# Altium project e.PrjPcb (part 1 of 2)
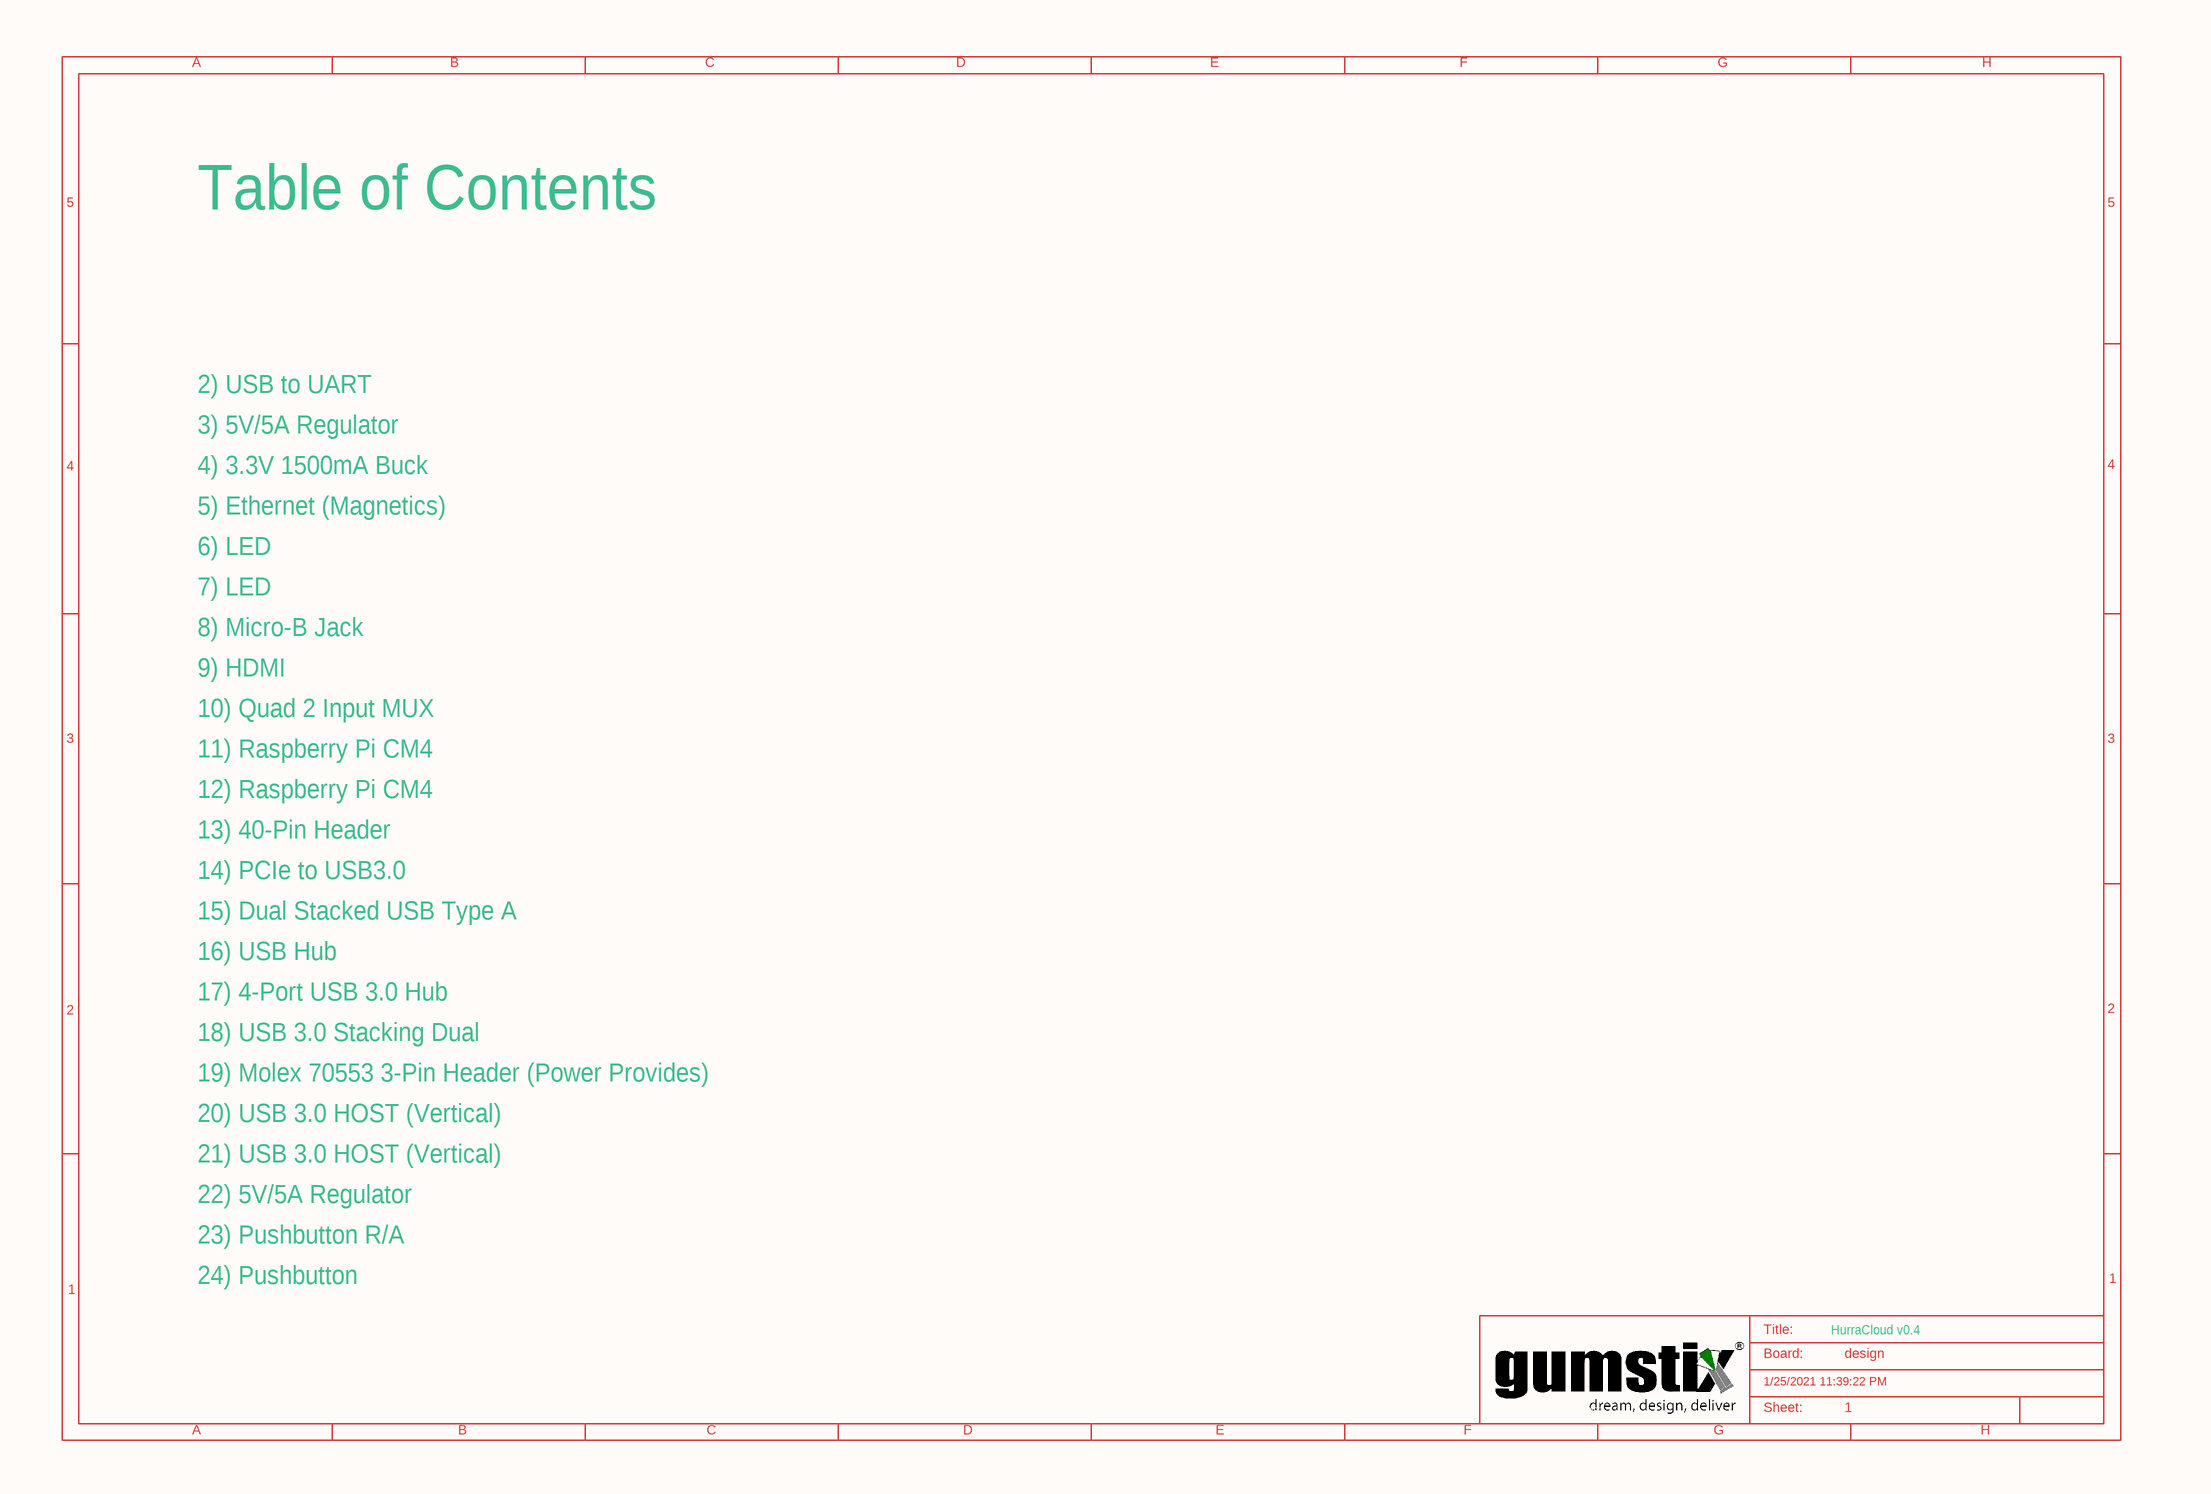
[diagram p0: design_0.SchDoc]
14 sheets, 249 parts. Net scope: global (net labels, ports and power ports of the same name join across sheets).
Board file: design.PcbDoc
Sheets:
  design_0.SchDoc
  design_1.SchDoc
  design_10.SchDoc
  design_12.SchDoc
  design_13.SchDoc
  design_16.SchDoc
  design_17.SchDoc
  design_18.SchDoc
  design_22.SchDoc
  design_3.SchDoc
  design_4.SchDoc
  design_6.SchDoc
  design_7.SchDoc
  design_9.SchDoc

## Sheet design_0.SchDoc
size 414 x 279 mm; Origin: Eagle

### Parts
TOC  DRAWING_NAME: design  LAST_DATE_TIME: 1/25/2021 11:39:22 PM  SHEET: 1  Sheet: Sheet:  Title: Title:  Board: Board:  (hidden comment: A3-L-GUMSTIX)

### Notes on the sheet
- Table of Contents
- 2) USB to UART
- 3) 5V/5A Regulator
- 4) 3.3V 1500mA Buck
- 5) Ethernet (Magnetics)
- 6) LED
- 7) LED
- 8) Micro-B Jack
- 9) HDMI
- 10) Quad 2 Input MUX
- 11) Raspberry Pi CM4
- 12) Raspberry Pi CM4
- 13) 40-Pin Header
- 14) PCIe to USB3.0
- 15) Dual Stacked USB Type A
- 16) USB Hub
- 17) 4-Port USB 3.0 Hub
- 18) USB 3.0 Stacking Dual
- 19) Molex 70553 3-Pin Header (Power Provides)
- 20) USB 3.0 HOST (Vertical)
- 21) USB 3.0 HOST (Vertical)
- 22) 5V/5A Regulator
- 23) Pushbutton R/A
- 24) Pushbutton
- HurraCloud v0.4

### Library data of the parts
TOC = A3-L-GUMSTIX: GateName_1: G$1; SymbolName_1: A3-L-GUMSTIX; LibraryName: qualified_1; DeviceSetName: A3-L-GUMSTIX; A: A; B: B; C: C; D: D; E: E; F: F; G: G; H: H; 1: 1; 2: 2; 3: 3; 4: 4; 5: 5; C:/Gumstix/gumstix-logo-16.bmp: C:/Gumstix/gumstix-logo-16.bmp

## Sheet design_1.SchDoc: design
size 414 x 279 mm; Date: 1/25/2021 11:39:22 PM; SheetNumber: 2; Origin: Eagle; GateName_1: G$1; SymbolName_1: A3-L-GUMSTIX; LibraryName: qualified_1; DeviceSetName: A3-L-GUMSTIX; A: A; B: B; C: C; D: D; E: E; F: F; G: G; H: H; 1: 1; 2: 2; 3: 3; 4: 4; 5: 5; Sheet: Sheet:; C:/Gumstix/gumstix-logo-16.bmp: C:/Gumstix/gumstix-logo-16.bmp; Board: Board:
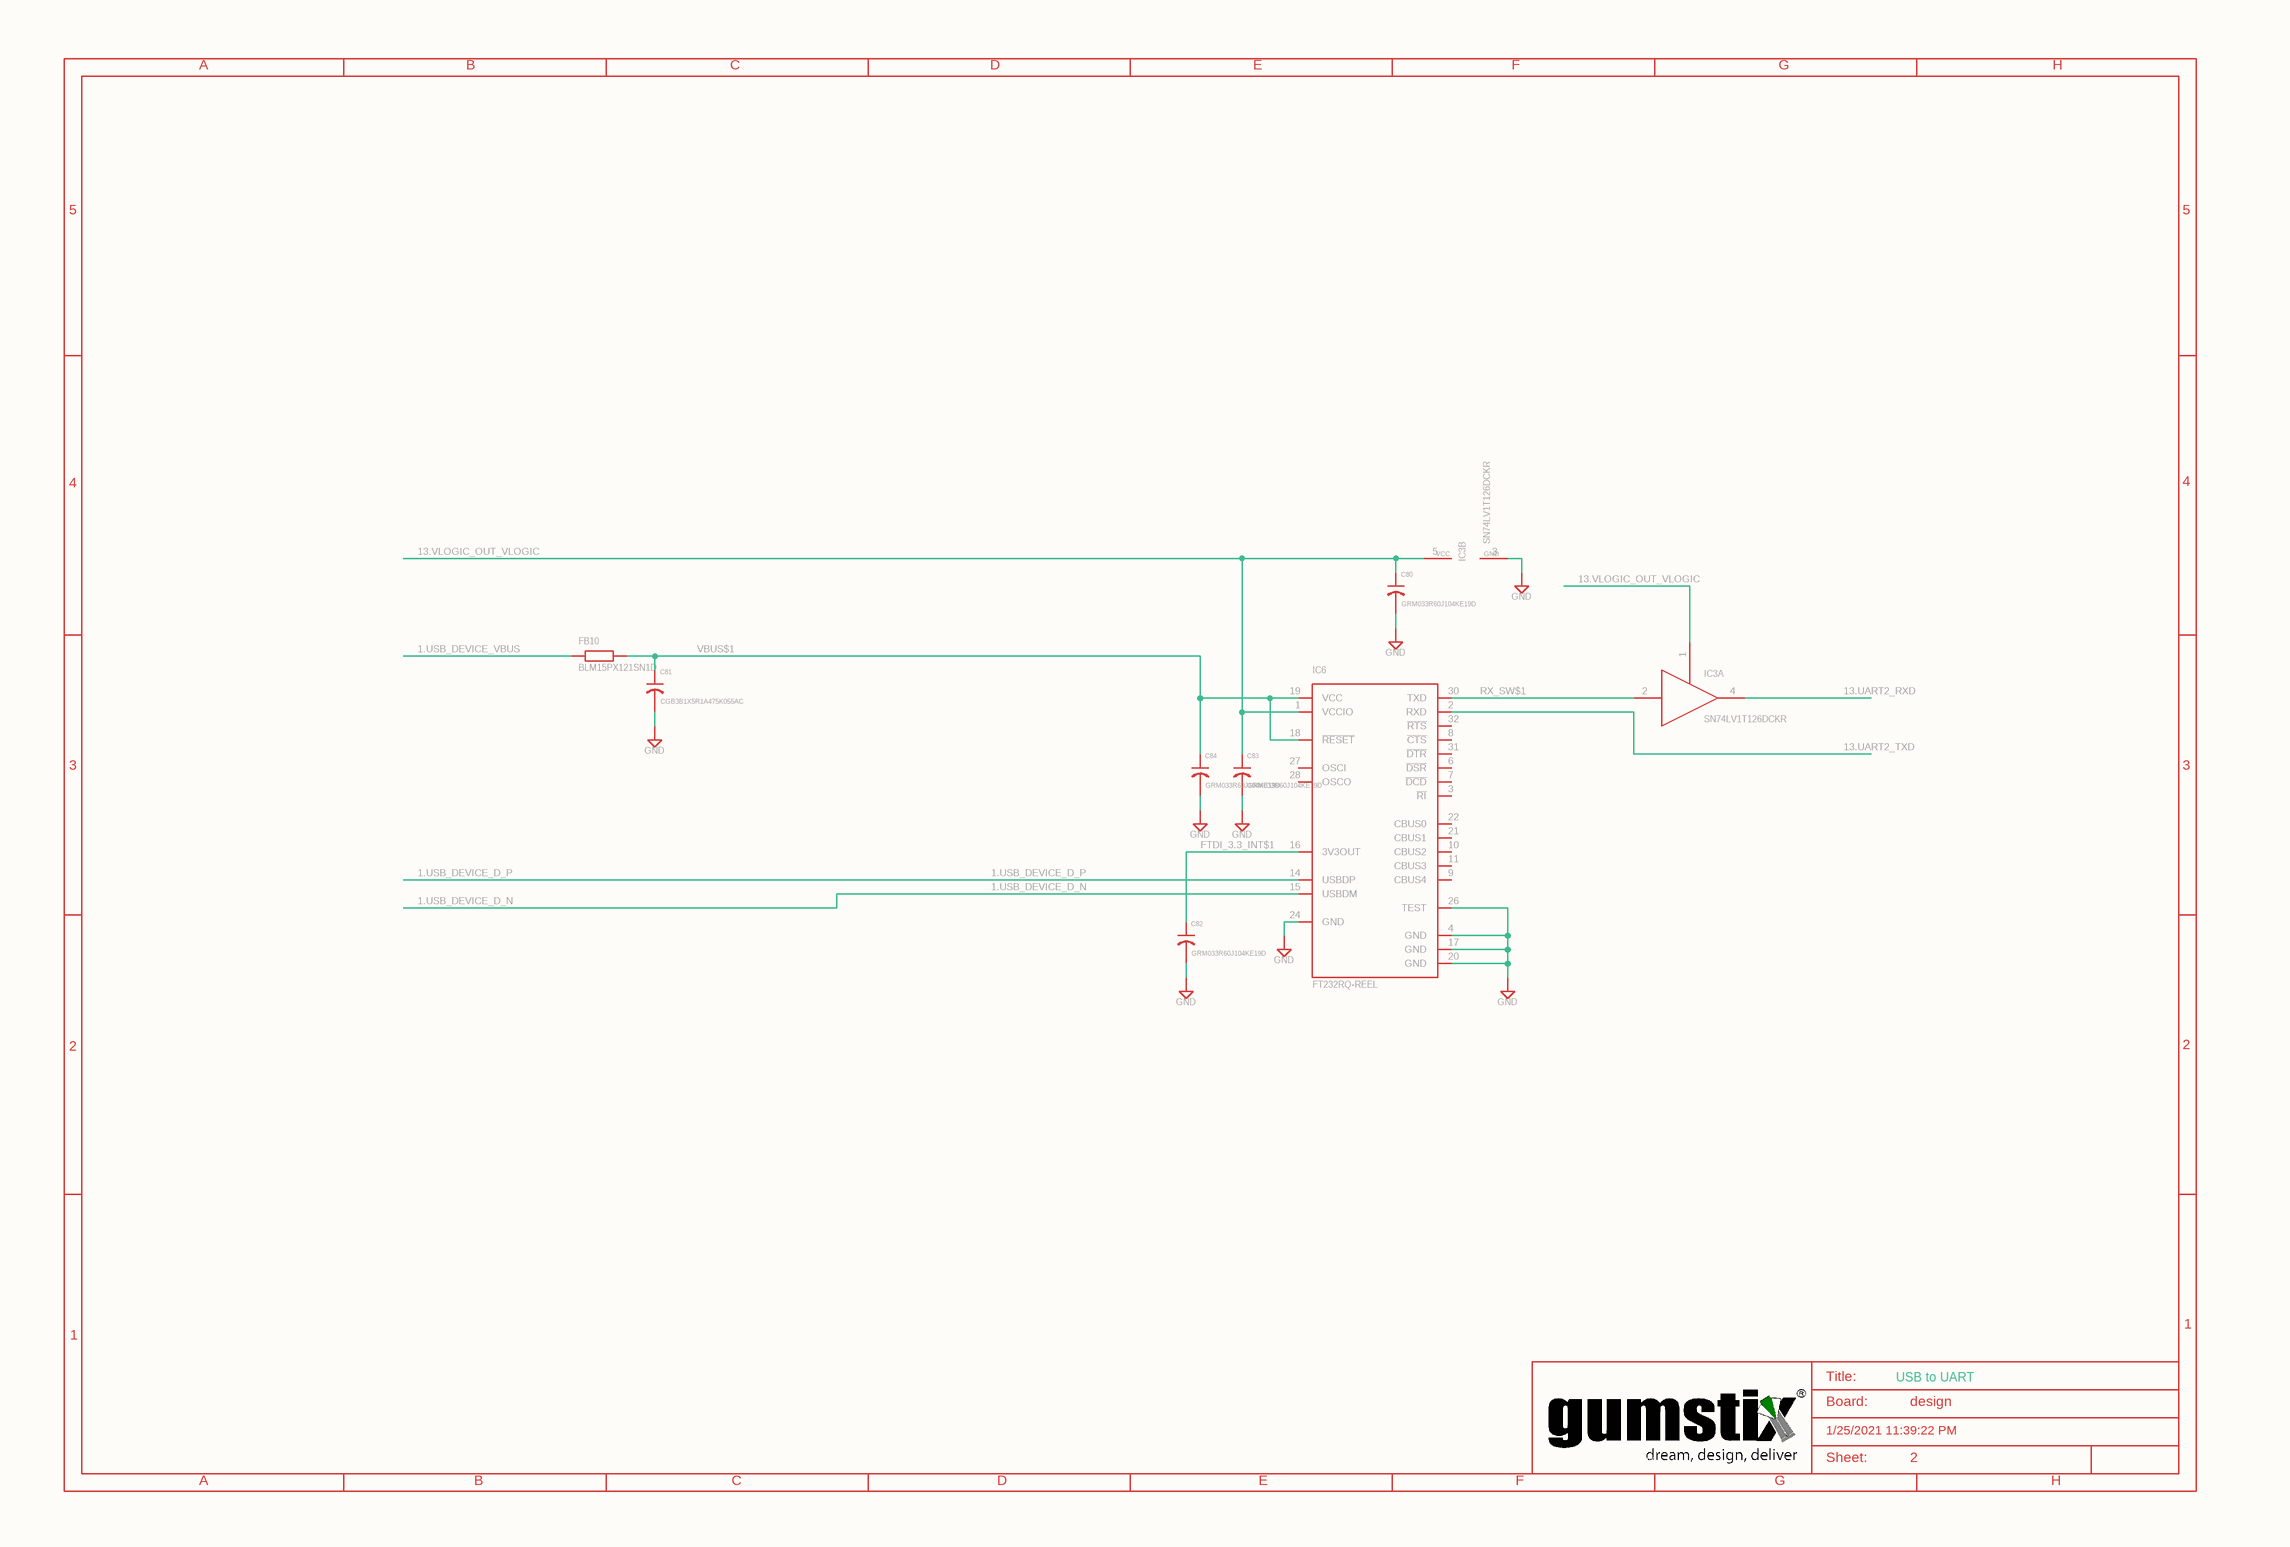
[diagram p1: design_1.SchDoc]

### Parts
C80  GRM033R60J104KE19D  [0201]
C81  CGB3B1X5R1A475K055AC  [0603]
C82  GRM033R60J104KE19D  [0201]
C83  GRM033R60J104KE19D  [0201]
C84  GRM033R60J104KE19D  [0201]
FB10  BLM15PX121SN1D  [0402]
IC3  SN74LV1T126DCKR  [SC70-5]  (parts A,B of 2)
IC6  FT232RQ-REEL  [QFN32]
SUPPLY83  GND
SUPPLY85  GND
SUPPLY86  GND
SUPPLY103  GND
SUPPLY104  GND
SUPPLY115  GND
SUPPLY133  GND
SUPPLY134  GND

### Nets
1.USB_DEVICE_D_N: IC6.15(USBDM)
1.USB_DEVICE_D_P: IC6.14(USBDP)
1.USB_DEVICE_VBUS: FB10.1
13.UART2_RXD: IC3.4(O)
13.UART2_TXD: IC6.2(RXD)
13.VLOGIC_OUT_VLOGIC: C80.1 C83.1 IC3.1(OE) IC3.5(VCC) IC6.1(VCCIO)
FTDI_3.3_INT$1: C82.1 IC6.16(3V3OUT)
RX_SW$1: IC3.2(I) IC6.30(TXD)
VBUS$1: C81.1 C84.1 FB10.2 IC6.18(~{RESET}) IC6.19(VCC)
NetC80_2: C80.2 SUPPLY115.?1(GND)
NetC81_2: C81.2 SUPPLY133.?1(GND)
NetC82_2: C82.2 SUPPLY83.?1(GND)
NetC83_2: C83.2 SUPPLY134.?1(GND)
NetC84_2: C84.2 SUPPLY86.?1(GND)
NetIC3_3: IC3.3(GND) SUPPLY85.?1(GND)
NetIC6_4: IC6.4(GND) IC6.17(GND) IC6.20(GND) IC6.26(TEST) SUPPLY104.?1(GND)
NetIC6_24: IC6.24(GND) SUPPLY103.?1(GND)

Not connected (* = marked no-connect by the designer): IC6 3(~{RI}) 6(~{DSR}) 7(~{DCD}) 8(~{CTS}) 9(CBUS4) 10(CBUS2) 11(CBUS3) 21(CBUS1) 22(CBUS0) 27(OSCI) 28(OSCO) 31(~{DTR}) 32(~{RTS})

### Notes on the sheet
- A
- B
- C
- D
- E
- F
- G
- H
- 5
- 4
- 3
- 2
- 1
- Title:
- Board:
- USB to UART
- design
- C:/Gumstix/gumstix-logo-16.bmp
- 1/25/2021 11:39:22 PM
- Sheet:

### Library data of the parts
C80 C82-C84 = GRM033R60J104KE19D: GateName_1: G$1; SymbolName_1: C-US; LibraryName: qualified_1; DeviceSetName: GRM033R60J104KE19D; DM: DM; DR: DR; DX: DX; DY: DY; HEIGHT: 0.25; SHEETNO: SHEETNO
C81 = CGB3B1X5R1A475K055AC: GateName_1: G$1; SymbolName_1: C-US; LibraryName: qualified_1; DeviceSetName: CGB3B1X5R1A475K055AC; DM: DM; DR: DR; DX: DX; DY: DY; HEIGHT: 0.5; SHEETNO: SHEETNO
FB10 = BLM15PX121SN1D: GateName_1: G$1; SymbolName_1: FB; LibraryName: qualified_1; DeviceSetName: BLM15PX121SN1D; DM: DM; DR: DR; DX: DX; DY: DY; HEIGHT: 0.35; SHEETNO: SHEETNO
IC3 = SN74LV1T126DCKR: Single Bus Buffer Gate With 3-State Outputs; GateName_1: A; SymbolName_1: 74126; GateName_2: P; SymbolName_2: PWRN; LibraryName: qualified_1; DeviceSetName: SN74LV1T126DCKR; DM: DM; DR: DR; DX: DX; DY: DY; HEIGHT: 1.1; SHEETNO: SHEETNO
IC6 = FT232RQ-REEL: Source: http://www.ftdichip.com/Documents/DataSheets/DS_FT232R_v104.pdf; GateName_1: 1; SymbolName_1: FT232R; LibraryName: qualified_1; DeviceSetName: FT232RQ-REEL; DM: DM; DR: DR; DX: DX; DY: DY; HEIGHT: 0.9; MF: MF; MPN: FT232RQ; OC_FARNELL: 1146033; OC_NEWARK: 91K9919; SHEETNO: SHEETNO
SUPPLY83 SUPPLY85 SUPPLY86 SUPPLY103 SUPPLY104 SUPPLY115 SUPPLY133 SUPPLY134 = GND: SUPPLY SYMBOL; SymbolName_1: GND-2; GateName_1: GND; LibraryName: qualified_1; DeviceSetName: GND

## Sheet design_10.SchDoc: design
size 414 x 279 mm; Date: 1/25/2021 11:39:22 PM; SheetNumber: 11; Origin: Eagle; GateName_1: G$1; SymbolName_1: A3-L-GUMSTIX; LibraryName: qualified_1; DeviceSetName: A3-L-GUMSTIX; A: A; B: B; C: C; D: D; E: E; F: F; G: G; H: H; 1: 1; 2: 2; 3: 3; 4: 4; 5: 5; Sheet: Sheet:; C:/Gumstix/gumstix-logo-16.bmp: C:/Gumstix/gumstix-logo-16.bmp; Board: Board:
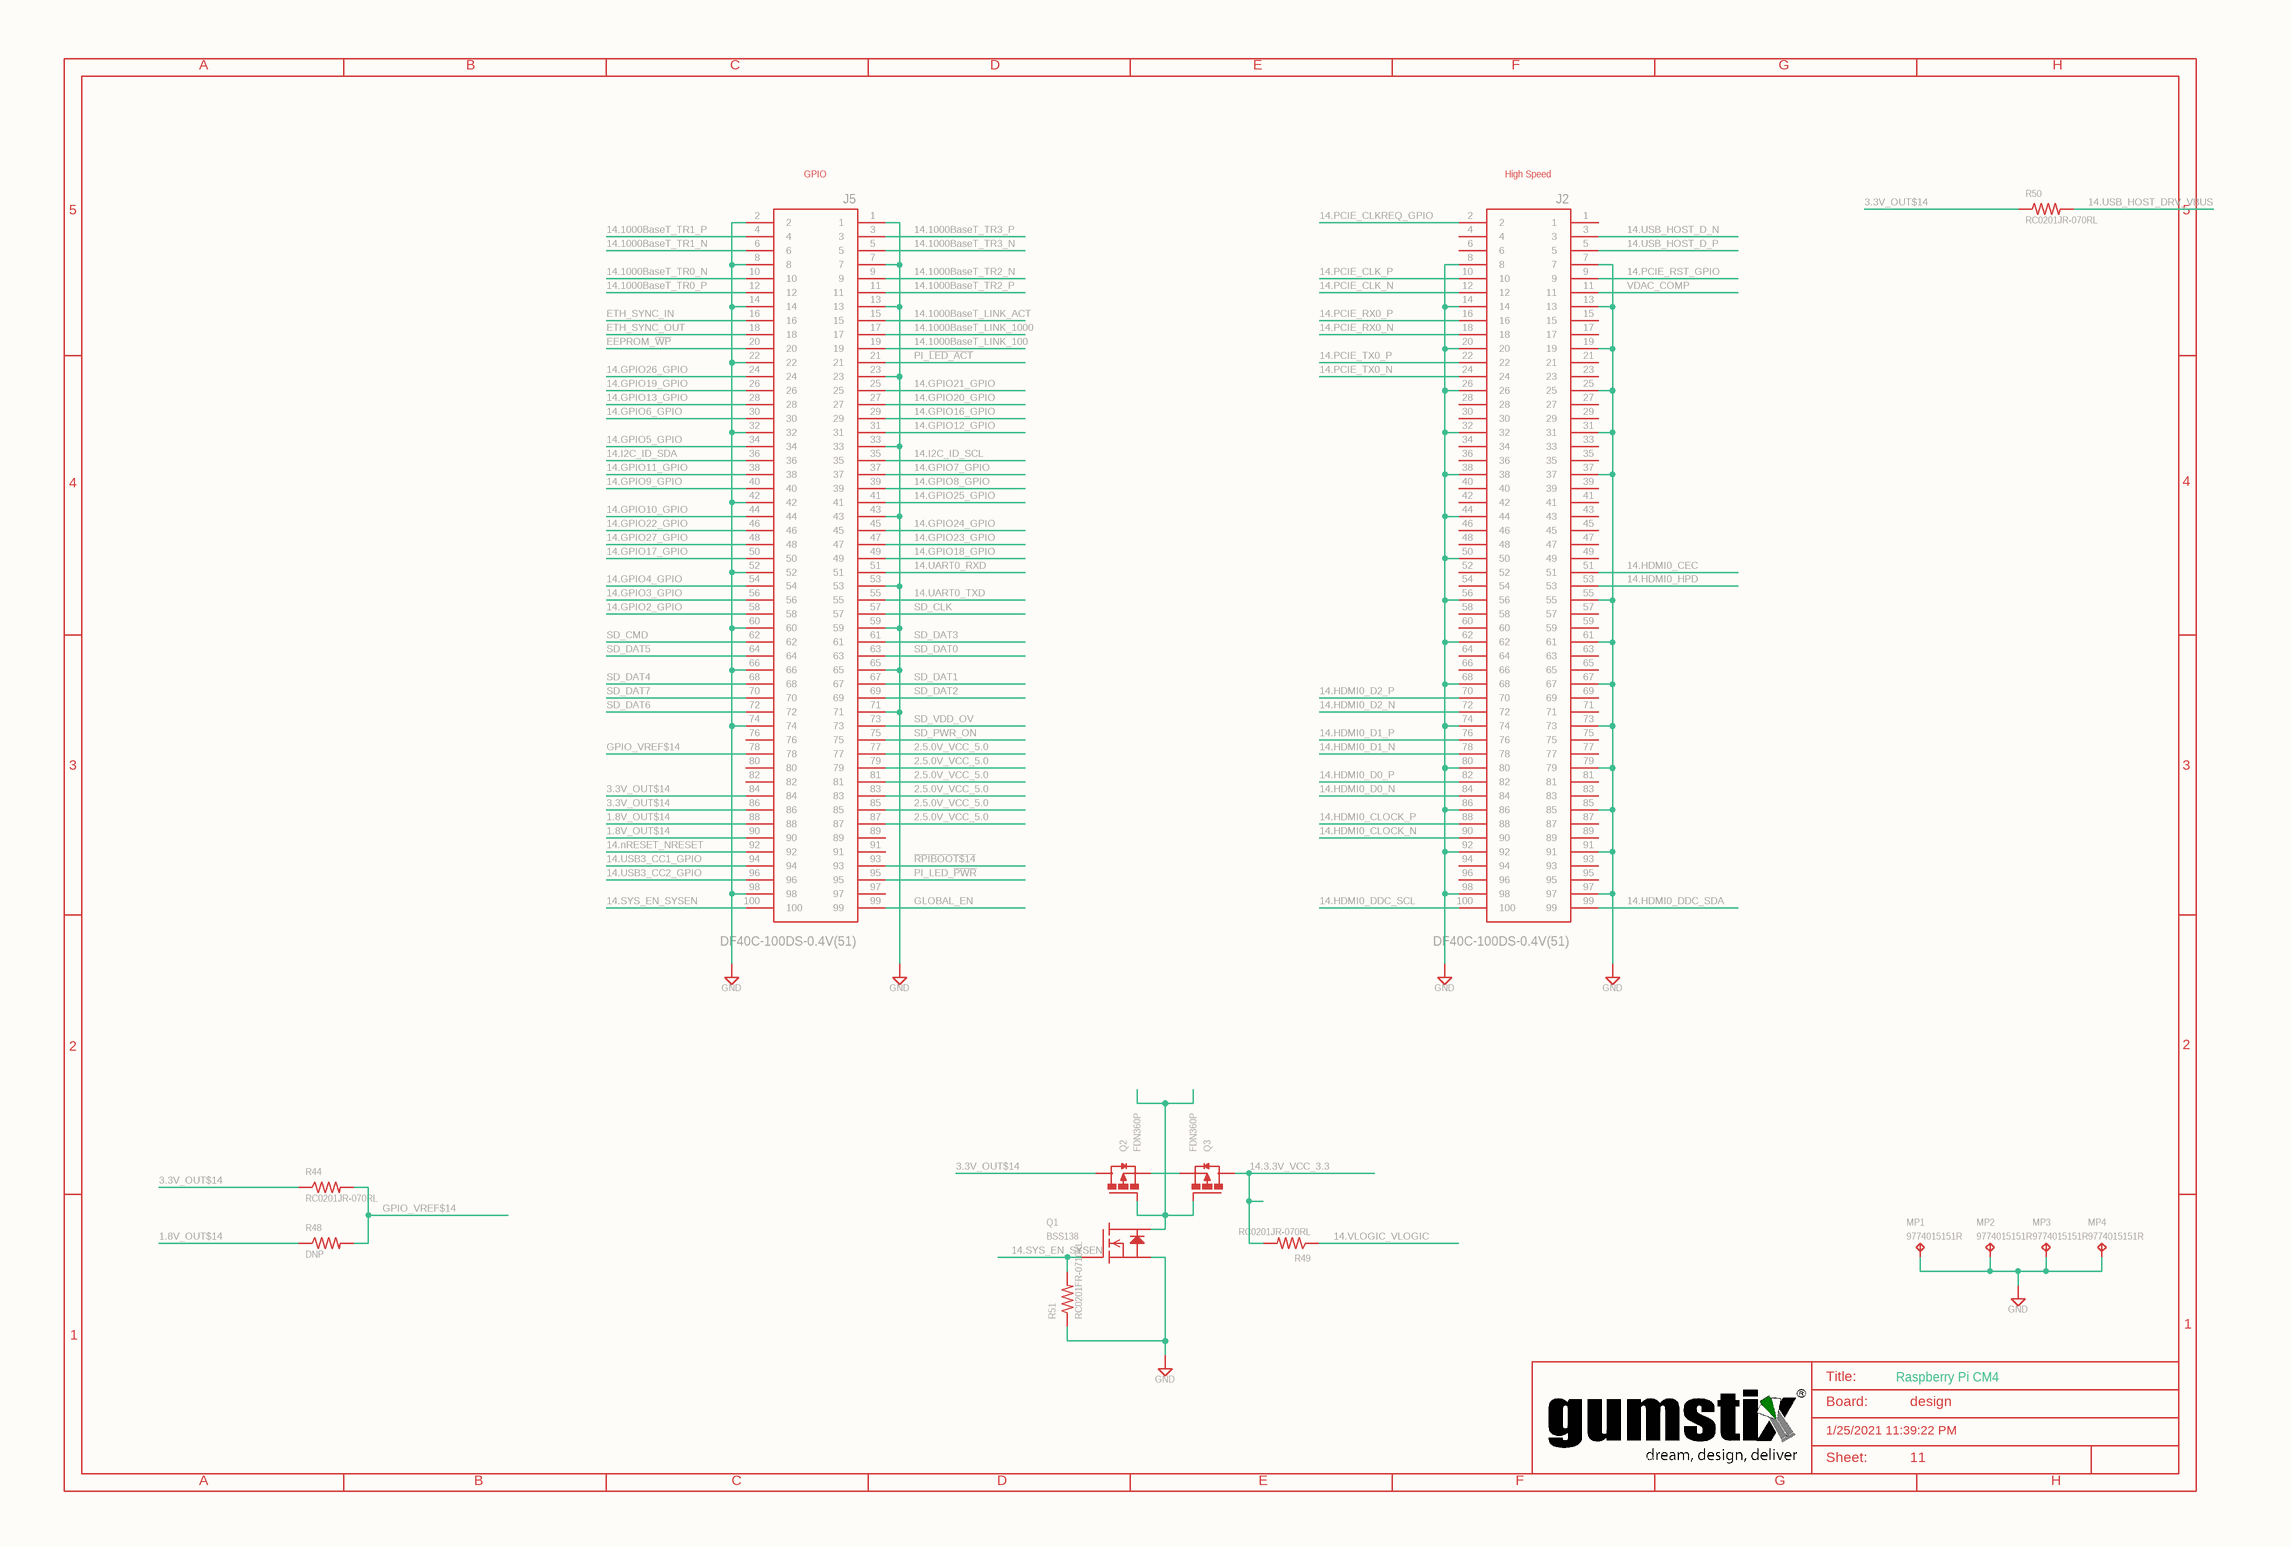
[diagram p2: design_10.SchDoc]

### Parts
J2  DF40C-100DS-0.4V(51)  [HRS_DF40C-100DS-0.4V(51)]
J5  DF40C-100DS-0.4V(51)  [HRS_DF40C-100DS-0.4V(51)]
MP1  9774015151R  [WA-SMSI_9774___151]
MP2  9774015151R  [WA-SMSI_9774___151]
MP3  9774015151R  [WA-SMSI_9774___151]
MP4  9774015151R  [WA-SMSI_9774___151]
Q1  BSS138  [SOT23]
Q2  FDN360P  [SOT23]
Q3  FDN360P  [SOT23]
R44  RC0201JR-070RL  [0201]
R48  DNP  [0201]
R49  RC0201JR-070RL  [0201]
R50  RC0201JR-070RL  [0201]
R51  RC0201FR-0710KL  [0201]
SUPPLY120  GND
SUPPLY121  GND
SUPPLY122  GND
SUPPLY126  GND
SUPPLY127  GND
SUPPLY130  GND

### Nets
1.8V_OUT$14: J5.88 J5.90 R48.1
2.5.0V_VCC_5.0: J5.77 J5.79 J5.81 J5.83 J5.85 J5.87
3.3V_OUT$14: J5.84 J5.86 Q2.3(D) R44.1 R50.1
14.3.3V_VCC_3.3: Q3.3(D) R49.2
14.1000BaseT_LINK_100: J5.19
14.1000BaseT_LINK_1000: J5.17
14.1000BaseT_LINK_ACT: J5.15
14.1000BaseT_TR0_N: J5.10
14.1000BaseT_TR0_P: J5.12
14.1000BaseT_TR1_N: J5.6
14.1000BaseT_TR1_P: J5.4
14.1000BaseT_TR2_N: J5.9
14.1000BaseT_TR2_P: J5.11
14.1000BaseT_TR3_N: J5.5
14.1000BaseT_TR3_P: J5.3
14.GPIO2_GPIO: J5.58
14.GPIO3_GPIO: J5.56
14.GPIO4_GPIO: J5.54
14.GPIO5_GPIO: J5.34
14.GPIO6_GPIO: J5.30
14.GPIO7_GPIO: J5.37
14.GPIO8_GPIO: J5.39
14.GPIO9_GPIO: J5.40
14.GPIO10_GPIO: J5.44
14.GPIO11_GPIO: J5.38
14.GPIO12_GPIO: J5.31
14.GPIO13_GPIO: J5.28
14.GPIO16_GPIO: J5.29
14.GPIO17_GPIO: J5.50
14.GPIO18_GPIO: J5.49
14.GPIO19_GPIO: J5.26
14.GPIO20_GPIO: J5.27
14.GPIO21_GPIO: J5.25
14.GPIO22_GPIO: J5.46
14.GPIO23_GPIO: J5.47
14.GPIO24_GPIO: J5.45
14.GPIO25_GPIO: J5.41
14.GPIO26_GPIO: J5.24
14.GPIO27_GPIO: J5.48
14.HDMI0_CEC: J2.51
14.HDMI0_CLOCK_N: J2.90
14.HDMI0_CLOCK_P: J2.88
14.HDMI0_D0_N: J2.84
14.HDMI0_D0_P: J2.82
14.HDMI0_D1_N: J2.78
14.HDMI0_D1_P: J2.76
14.HDMI0_D2_N: J2.72
14.HDMI0_D2_P: J2.70
14.HDMI0_DDC_SCL: J2.100
14.HDMI0_DDC_SDA: J2.99
14.HDMI0_HPD: J2.53
14.I2C_ID_SCL: J5.35
14.I2C_ID_SDA: J5.36
14.nRESET_NRESET: J5.92
14.PCIE_CLK_N: J2.12
14.PCIE_CLK_P: J2.10
14.PCIE_CLKREQ_GPIO: J2.2
14.PCIE_RST_GPIO: J2.9
14.PCIE_RX0_N: J2.18
14.PCIE_RX0_P: J2.16
14.PCIE_TX0_N: J2.24
14.PCIE_TX0_P: J2.22
14.SYS_EN_SYSEN: J5.100 Q1.1(G) R51.2
14.UART0_RXD: J5.51
14.UART0_TXD: J5.55
14.USB3_CC1_GPIO: J5.94
14.USB3_CC2_GPIO: J5.96
14.USB_HOST_D_N: J2.3
14.USB_HOST_D_P: J2.5
14.USB_HOST_DRV_VBUS: R50.2
14.VLOGIC_VLOGIC: R49.1
EEPROM_~{WP}: J5.20
ETH_SYNC_IN: J5.16
ETH_SYNC_OUT: J5.18
GLOBAL_EN: J5.99
GPIO_VREF$14: J5.78 R44.2 R48.2
PI_~{LED_ACT}: J5.21
PI_LED_~{PWR}: J5.95
~{RPIBOOT$14}: J5.93
SD_CLK: J5.57
SD_CMD: J5.62
SD_DAT0: J5.63
SD_DAT1: J5.67
SD_DAT2: J5.69
SD_DAT3: J5.61
SD_DAT4: J5.68
SD_DAT5: J5.64
SD_DAT6: J5.72
SD_DAT7: J5.70
SD_PWR_ON: J5.75
SD_VDD_OV: J5.73
VDAC_COMP: J2.11
NetJ2_7: J2.7 J2.13 J2.19 J2.25 J2.31 J2.37 J2.55 J2.61 J2.67 J2.73 J2.79 J2.85 J2.91 J2.97 SUPPLY121.?1(GND)
NetJ2_8: J2.8 J2.14 J2.20 J2.26 J2.32 J2.38 J2.44 J2.50 J2.56 J2.62 J2.68 J2.74 J2.80 J2.86 J2.92 J2.98 SUPPLY127.?1(GND)
NetJ5_1: J5.1 J5.7 J5.13 J5.23 J5.33 J5.43 J5.53 J5.59 J5.65 J5.71 SUPPLY126.?1(GND)
NetJ5_2: J5.2 J5.8 J5.14 J5.22 J5.32 J5.42 J5.52 J5.60 J5.66 J5.74 J5.98 SUPPLY120.?1(GND)
NetMP1_1: MP1.1(TP) MP2.1(TP) MP3.1(TP) MP4.1(TP) SUPPLY122.?1(GND)
NetQ1_2: Q1.2(S) R51.1 SUPPLY130.?1(GND)
NetQ1_3: Q1.3(D) Q2.1(G) Q3.1(G)
NetQ2_2: Q2.2(S) Q3.2(S)

Not connected (* = marked no-connect by the designer): J2 1 4 6 15 17 21 23 27 28 29 30 33 34 35 36 39 40 41 42 43 45 46 47 48 49 52 54 57 58 59 60 63 64 65 66 69 71 75 77 81 83 87 89 93 94 95 96; J5 76 80 82 89 91 97

### Notes on the sheet
- A
- B
- C
- D
- E
- F
- G
- H
- 5
- (near J5) GPIO
- (near J2) High Speed
- 4
- 3
- 2
- 1
- Title:
- Board:
- Raspberry Pi CM4
- design
- C:/Gumstix/gumstix-logo-16.bmp
- 1/25/2021 11:39:22 PM
- Sheet:
- 11

### Library data of the parts
J2 J5 = DF40C-100DS-0.4V(51): DF40 Series 100 Position Dual Row 0.4 mm Pitch Surface Mount Vertical Receptacle; GateName_1: G$1; MF: Hirose; MP: DF40C-100DS-0.4V_51_; SymbolName_1: DF40C-100DS-0.4V(51); LibraryName: qualified_1; DeviceSetName: DF40C-100DS-0.4V(51); DIGI-KEY_PART_NUMBER: H11615CT-ND; DIGI-KEY_PURCHASE_URL: https://www.digikey.ca/product-detail/en/hirose-electric-co-ltd/DF40C-100DS-0.4V_51_/H11615CT-ND/1969495?utm_source=snapeda&utm_medium=aggregator&utm_campaign=symbol; PACKAGE: None
MP1-MP4 = 9774015151R: Bullet connector (for RC) solder pad.; GateName_1: G$1; SymbolName_1: TP; LibraryName: qualified_1; DeviceSetName: 9774015151R
Q1 = BSS138: N-Channel Enhancement MOSFET; GateName_1: G$1; SymbolName_1: IGFET-EN-GDS; LibraryName: qualified_1; DeviceSetName: BSS138; HEIGHT: 1.12
Q2 Q3 = FDN360P: GateName_1: G$1; SymbolName_1: MOSFET_P_ENH; LibraryName: qualified_1; DeviceSetName: FDN360P; D: D; S: S; G: G; HEIGHT: 1.12
R44 R49 R50 = RC0201JR-070RL: GateName_1: G$1; SymbolName_1: R-US; LibraryName: qualified_1; DeviceSetName: RC0201JR-070RL; HEIGHT: 0.25
R48 = R0201: GateName_1: G$1; SymbolName_1: R-US; DeviceSetName: R; DeviceName: 0201; LibraryName: qualified_1; HEIGHT: 0.25
R51 = RC0201FR-0710KL: GateName_1: G$1; SymbolName_1: R-US; LibraryName: qualified_1; DeviceSetName: RC0201FR-0710KL; HEIGHT: 0.25
SUPPLY120-SUPPLY122 SUPPLY126 SUPPLY127 SUPPLY130 = GND: SUPPLY SYMBOL; SymbolName_1: GND-2; GateName_1: GND; LibraryName: qualified_1; DeviceSetName: GND

## Sheet design_12.SchDoc
size 414 x 279 mm; Origin: Eagle
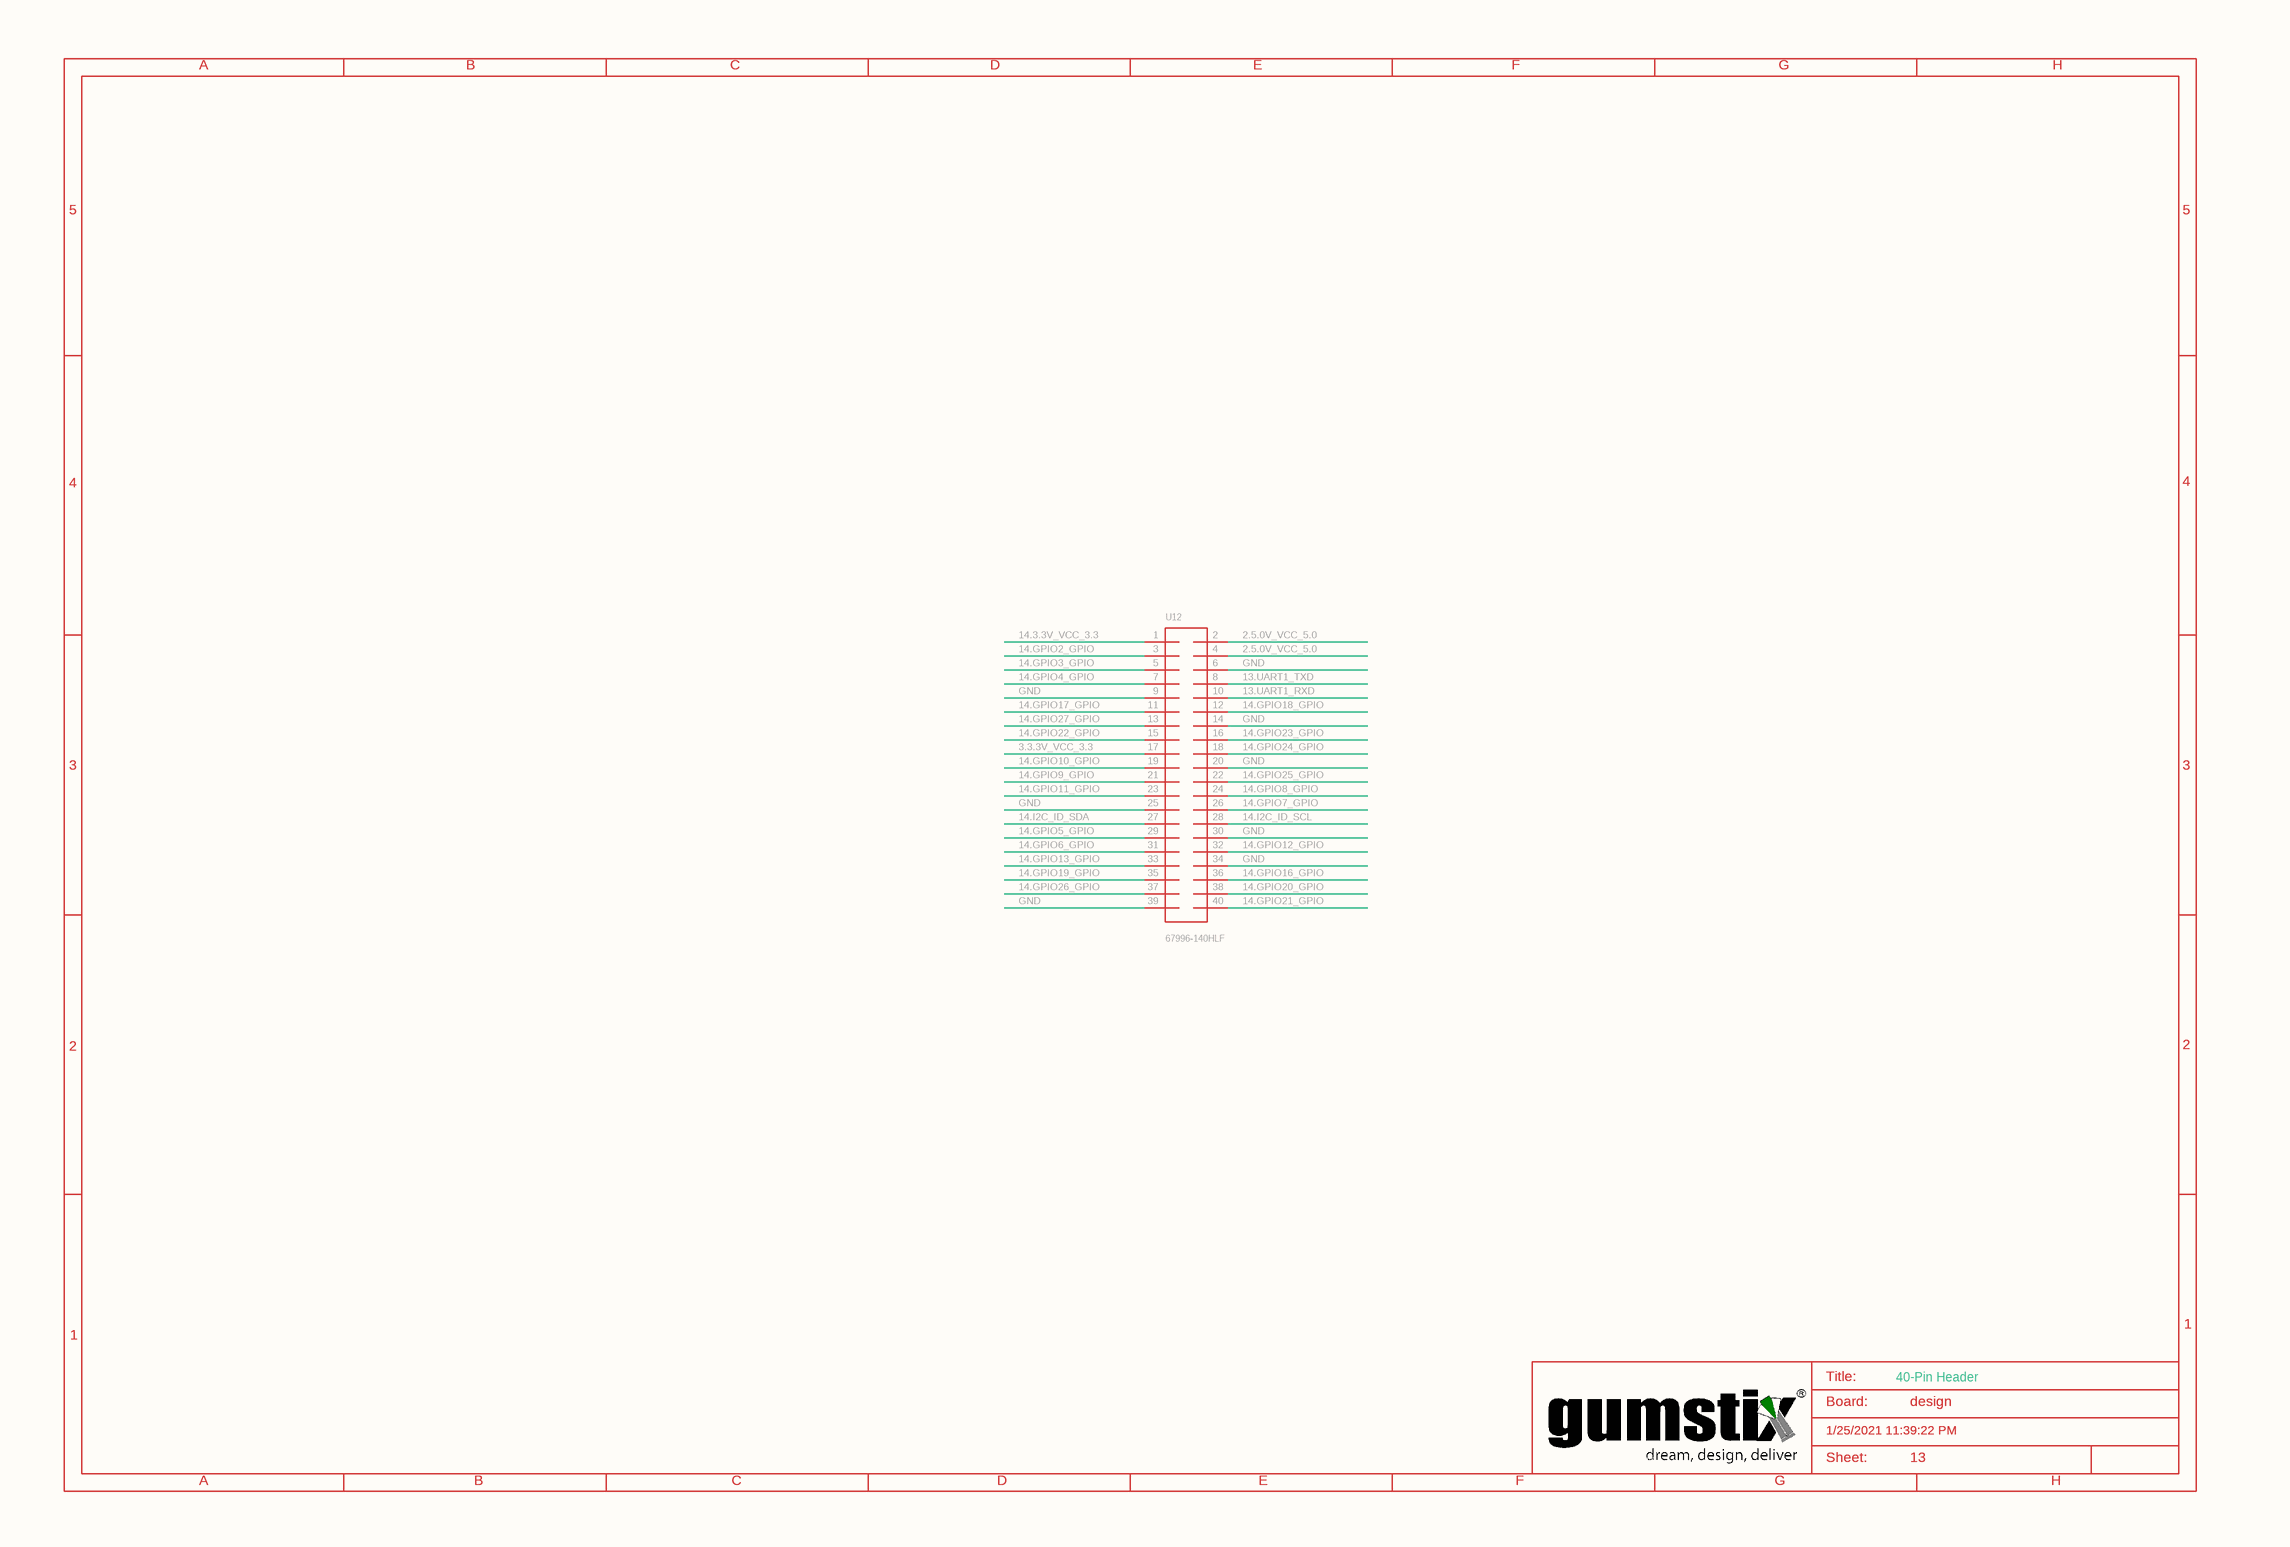
[diagram p3: design_12.SchDoc]

### Parts
U12  67996-140HLF  [2X20]
U$5  DRAWING_NAME: design  LAST_DATE_TIME: 1/25/2021 11:39:22 PM  SHEET: 13  Sheet: Sheet:  Title: Title:  Board: Board:  (hidden comment: A3-L-GUMSTIX)
U$27  DRAWING_NAME: design  LAST_DATE_TIME: 1/25/2021 11:39:22 PM  SHEET: 13  Sheet: Sheet:  Title: Title:  Board: Board:  (hidden comment: A3-L-GUMSTIX)

### Nets
2.5.0V_VCC_5.0: U12.2 U12.4
3.3.3V_VCC_3.3: U12.17
13.UART1_RXD: U12.10
13.UART1_TXD: U12.8
14.3.3V_VCC_3.3: U12.1
14.GPIO2_GPIO: U12.3
14.GPIO3_GPIO: U12.5
14.GPIO4_GPIO: U12.7
14.GPIO5_GPIO: U12.29
14.GPIO6_GPIO: U12.31
14.GPIO7_GPIO: U12.26
14.GPIO8_GPIO: U12.24
14.GPIO9_GPIO: U12.21
14.GPIO10_GPIO: U12.19
14.GPIO11_GPIO: U12.23
14.GPIO12_GPIO: U12.32
14.GPIO13_GPIO: U12.33
14.GPIO16_GPIO: U12.36
14.GPIO17_GPIO: U12.11
14.GPIO18_GPIO: U12.12
14.GPIO19_GPIO: U12.35
14.GPIO20_GPIO: U12.38
14.GPIO21_GPIO: U12.40
14.GPIO22_GPIO: U12.15
14.GPIO23_GPIO: U12.16
14.GPIO24_GPIO: U12.18
14.GPIO25_GPIO: U12.22
14.GPIO26_GPIO: U12.37
14.GPIO27_GPIO: U12.13
14.I2C_ID_SCL: U12.28
14.I2C_ID_SDA: U12.27
GND: U12.6 U12.9 U12.14 U12.20 U12.25 U12.30 U12.34 U12.39

### Notes on the sheet
- 40-Pin Header

### Library data of the parts
U12 = 67996-140HLF: GateName_1: G$1; SymbolName_1: 2X20_2.54X2.54MM_PITCH; LibraryName: qualified_1; DeviceSetName: 67996-140HLF
U$5 U$27 = A3-L-GUMSTIX: GateName_1: G$1; SymbolName_1: A3-L-GUMSTIX; LibraryName: qualified_1; DeviceSetName: A3-L-GUMSTIX; A: A; B: B; C: C; D: D; E: E; F: F; G: G; H: H; 1: 1; 2: 2; 3: 3; 4: 4; 5: 5; C:/Gumstix/gumstix-logo-16.bmp: C:/Gumstix/gumstix-logo-16.bmp

## Sheet design_13.SchDoc: design
size 414 x 279 mm; Date: 1/25/2021 11:39:22 PM; SheetNumber: 14; Origin: Eagle; GateName_1: G$1; SymbolName_1: A3-L-GUMSTIX; LibraryName: qualified_1; DeviceSetName: A3-L-GUMSTIX; A: A; B: B; C: C; D: D; E: E; F: F; G: G; H: H; 1: 1; 2: 2; 3: 3; 4: 4; 5: 5; Sheet: Sheet:; C:/Gumstix/gumstix-logo-16.bmp: C:/Gumstix/gumstix-logo-16.bmp; Board: Board:
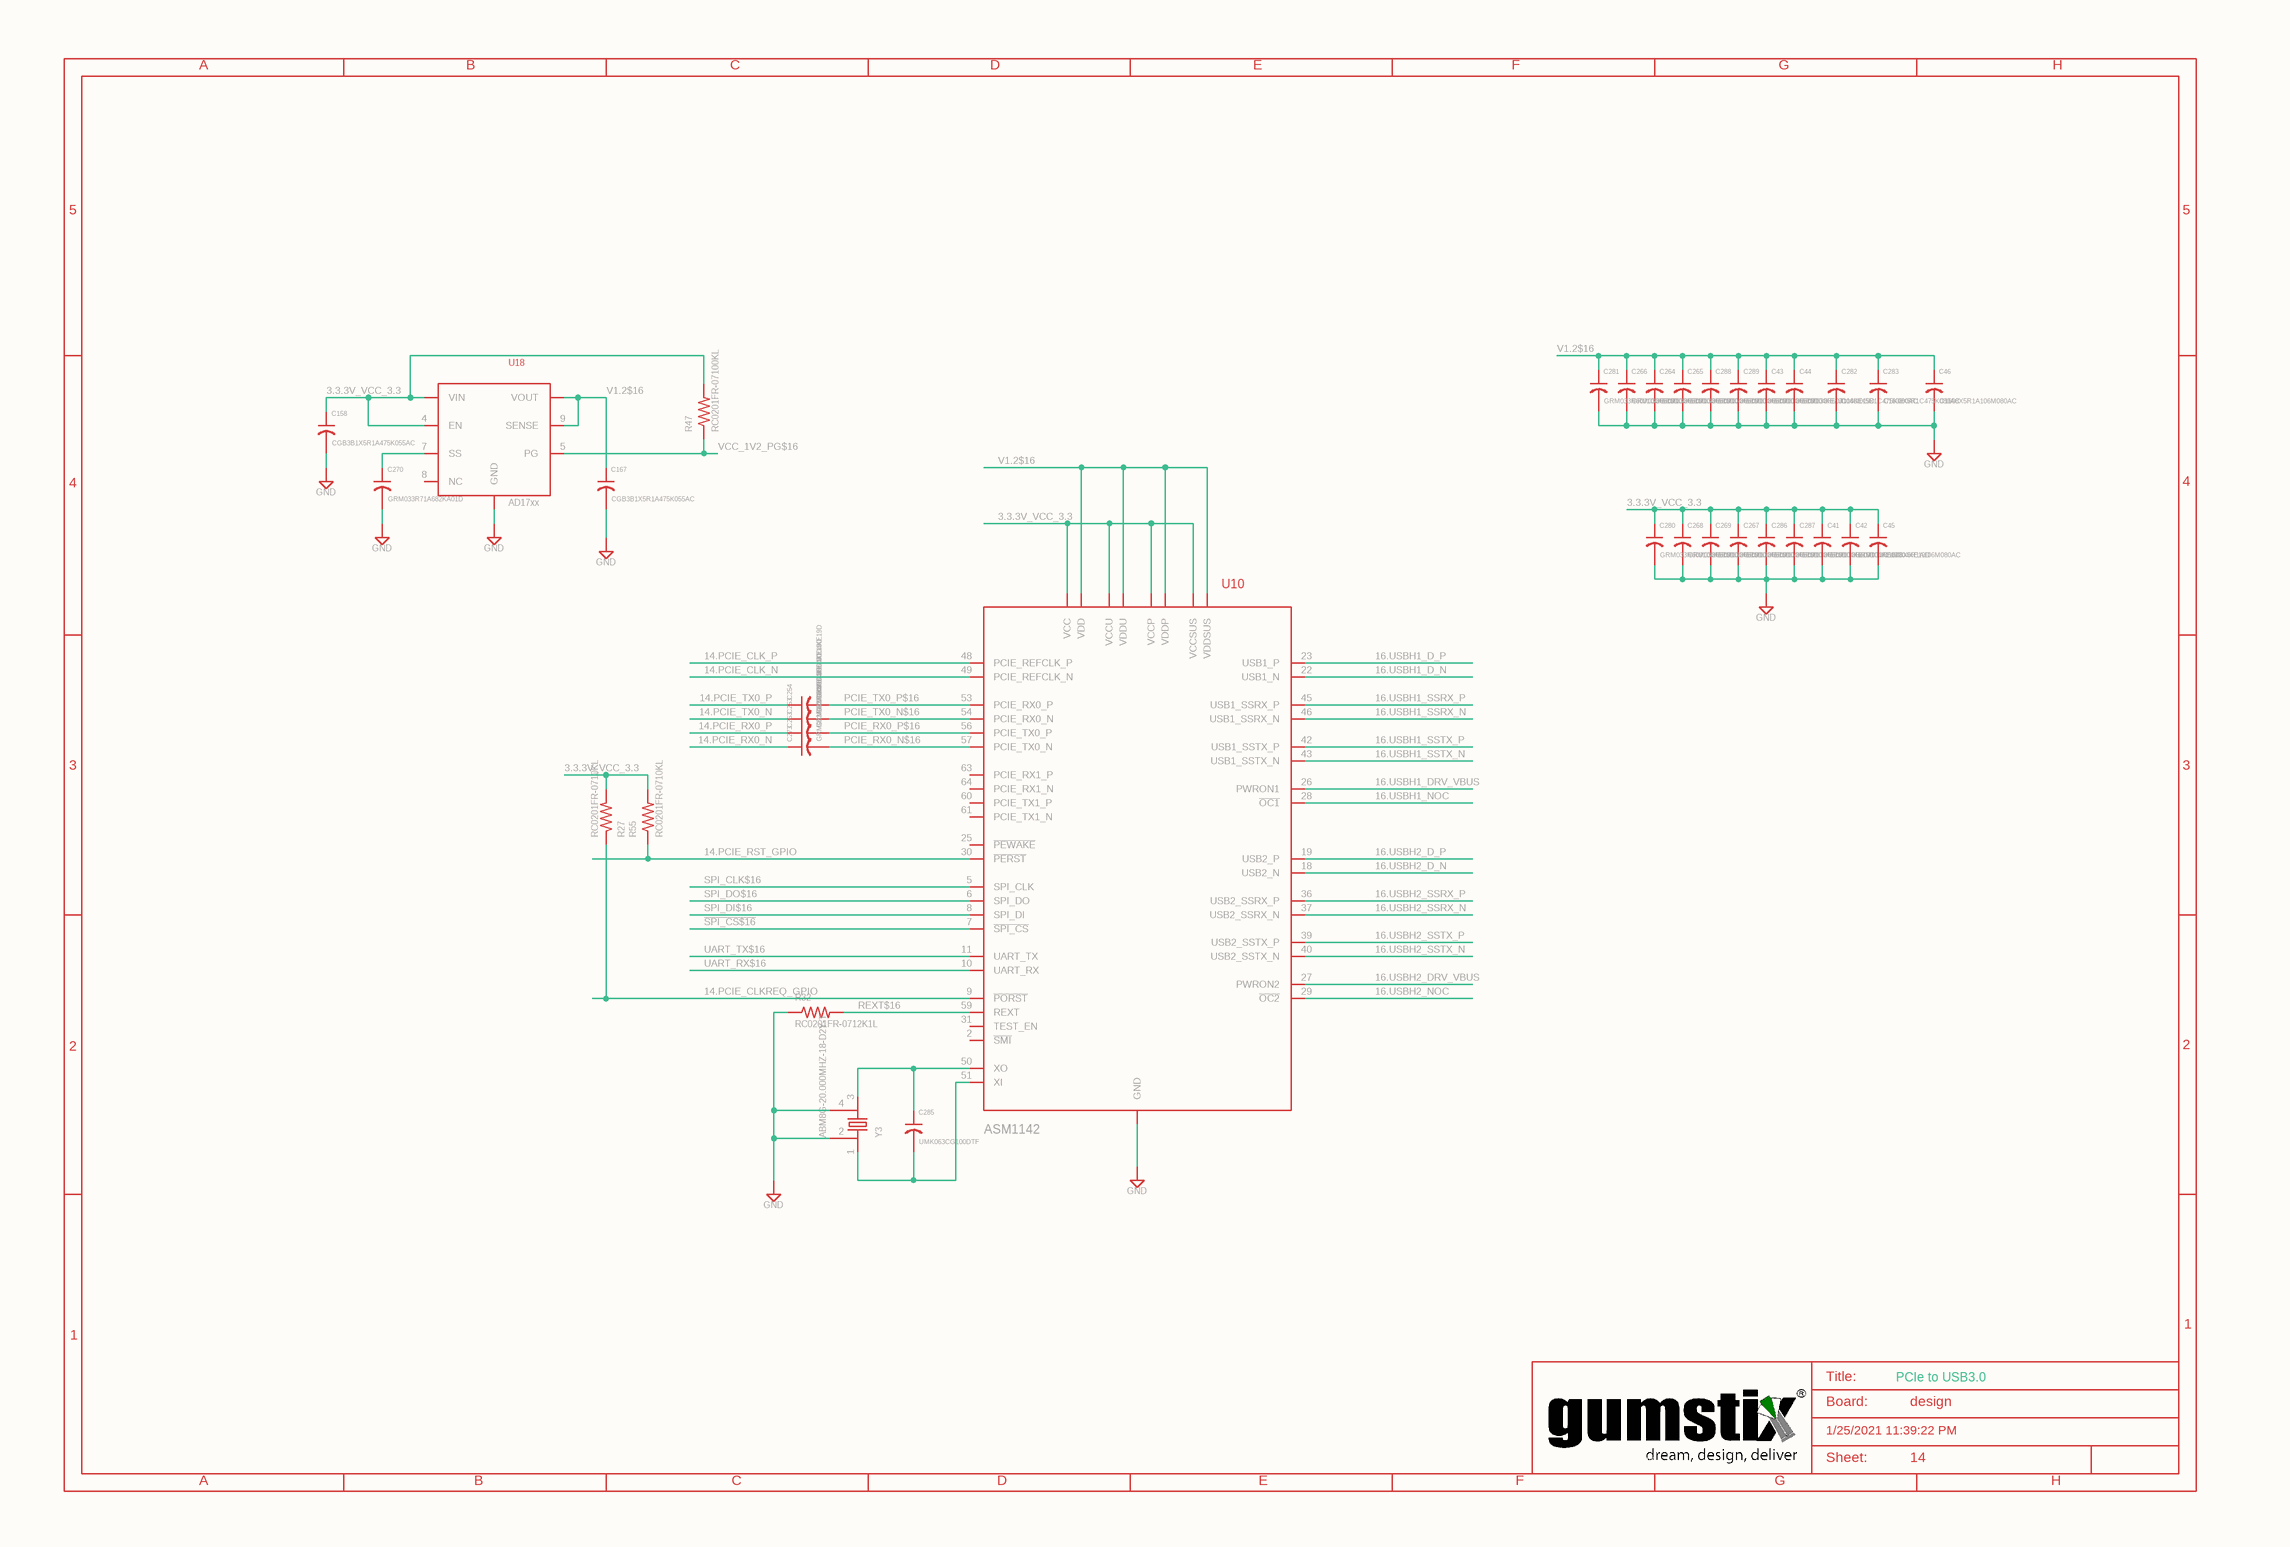
[diagram p4: design_13.SchDoc]

### Parts
C41  GRM033R60J104KE19D  [0201]
C42  GRM033R60J104KE19D  [0201]
C43  GRM033R60J104KE19D  [0201]
C44  GRM033R60J104KE19D  [0201]
C45  C1608X5R1A106M080AC  [0603]
C46  C1608X5R1A106M080AC  [0603]
C158  CGB3B1X5R1A475K055AC  [0603]
C167  CGB3B1X5R1A475K055AC  [0603]
C253  GRM033R60J104KE19D  [0201]
C254  GRM033R60J104KE19D  [0201]
C263  GRM033R60J104KE19D  [0201]
C264  GRM033R60J104KE19D  [0201]
C265  GRM033R60J104KE19D  [0201]
C266  GRM033R60J104KE19D  [0201]
C267  GRM033R60J104KE19D  [0201]
C268  GRM033R60J104KE19D  [0201]
C269  GRM033R60J104KE19D  [0201]
C270  GRM033R71A682KA01D  [0201]
C273  GRM033R60J104KE19D  [0201]
C280  GRM033R60J104KE19D  [0201]
C281  GRM033R60J104KE19D  [0201]
C282  C1608X5R1C475K080AC  [0603]
C283  C1608X5R1C475K080AC  [0603]
C285  UMK063CG100DTF  [0201]
C286  GRM033R60J104KE19D  [0201]
C287  GRM033R60J104KE19D  [0201]
C288  GRM033R60J104KE19D  [0201]
C289  GRM033R60J104KE19D  [0201]
R27  RC0201FR-0710KL  [0201]
R32  RC0201FR-0712K1L  [0201]
R47  RC0201FR-07100KL  [0201]
R55  RC0201FR-0710KL  [0201]
SUPPLY84  GND
SUPPLY87  GND
SUPPLY99  GND
SUPPLY141  GND
SUPPLY162  GND
SUPPLY163  GND
SUPPLY164  GND
SUPPLY165  GND
U10  ASM1142  [QFN64-9X9MM-FT2232HQ]
U18  ADP1740ACPZ-1.2-R7  [LFCSPWQ16]  (value not drawn)
Y3  ABM8G-20.000MHZ-18-D2Y-T  [CRYSTAL-3225]

### Nets
3.3.3V_VCC_3.3: C41.1 C42.1 C45.1 C158.1 C267.1 C268.1 C269.1 C280.1 C286.1 C287.1 R27.2 R47.2 R55.2 U10.4_32(VCC) U10.20_24(VCCSUS) U10.38_44(VCCU) U10.55_62(VCCP) U18.1_2_3_15_16(VIN) U18.4(EN)
14.PCIE_CLK_N: U10.49(PCIE_REFCLK_N)
14.PCIE_CLK_P: U10.48(PCIE_REFCLK_P)
14.PCIE_CLKREQ_GPIO: R27.1 U10.9(~{PORST})
14.PCIE_RST_GPIO: R55.1 U10.30(~{PERST})
14.PCIE_RX0_N: C273.1
14.PCIE_RX0_P: C263.1
14.PCIE_TX0_N: C253.1
14.PCIE_TX0_P: C254.1
16.USBH1_D_N: U10.22(USB1_N)
16.USBH1_D_P: U10.23(USB1_P)
16.USBH1_DRV_VBUS: U10.26(PWRON1)
16.USBH1_NOC: U10.28(~{OC1})
16.USBH1_SSRX_N: U10.46(USB1_SSRX_N)
16.USBH1_SSRX_P: U10.45(USB1_SSRX_P)
16.USBH1_SSTX_N: U10.43(USB1_SSTX_N)
16.USBH1_SSTX_P: U10.42(USB1_SSTX_P)
16.USBH2_D_N: U10.18(USB2_N)
16.USBH2_D_P: U10.19(USB2_P)
16.USBH2_DRV_VBUS: U10.27(PWRON2)
16.USBH2_NOC: U10.29(~{OC2})
16.USBH2_SSRX_N: U10.37(USB2_SSRX_N)
16.USBH2_SSRX_P: U10.36(USB2_SSRX_P)
16.USBH2_SSTX_N: U10.40(USB2_SSTX_N)
16.USBH2_SSTX_P: U10.39(USB2_SSTX_P)
PCIE_RX0_N$16: C273.2 U10.57(PCIE_TX0_N)
PCIE_RX0_P$16: C263.2 U10.56(PCIE_TX0_P)
PCIE_TX0_N$16: C253.2 U10.54(PCIE_RX0_N)
PCIE_TX0_P$16: C254.2 U10.53(PCIE_RX0_P)
REXT$16: R32.2 U10.59(REXT)
~{SPI_CS$16}: U10.7(~{SPI_CS})
SPI_CLK$16: U10.5(SPI_CLK)
SPI_DI$16: U10.8(SPI_DI)
SPI_DO$16: U10.6(SPI_DO)
UART_RX$16: U10.10(UART_RX)
UART_TX$16: U10.11(UART_TX)
V1.2$16: C43.1 C44.1 C46.1 C167.1 C264.1 C265.1 C266.1 C281.1 C282.1 C283.1 C288.1 C289.1 U10.1_12_33(VDD) U10.21_34(VDDSUS) U10.35_41_47(VDDU) U10.52_58(VDDP) U18.9(SENSE) U18.10_11_12_13_14(VOUT)
VCC_1V2_PG$16: R47.1 U18.5(PG)
NetC41_2: C41.2 C42.2 C45.2 C267.2 C268.2 C269.2 C280.2 C286.2 C287.2 SUPPLY164.?1(GND)
NetC43_2: C43.2 C44.2 C46.2 C264.2 C265.2 C266.2 C281.2 C282.2 C283.2 C288.2 C289.2 SUPPLY165.?1(GND)
NetC158_2: C158.2 SUPPLY84.?1(GND)
NetC167_2: C167.2 SUPPLY87.?1(GND)
NetC270_1: C270.1 U18.7(SS)
NetC270_2: C270.2 SUPPLY141.?1(GND)
NetC285_1: C285.1 U10.50(XO) Y3.3
NetC285_2: C285.2 U10.51(XI) Y3.1
NetR32_1: R32.1 SUPPLY163.?1(GND) Y3.2 Y3.4
NetSUPPLY99_?1: SUPPLY99.?1(GND) U18.6_EP_EP1_EP2_EP3_EP4(GND)
NetSUPPLY162_?1: SUPPLY162.?1(GND) U10.15_65_EPAD1_EPAD2_EPAD3_EPAD4_EPAD5_EPAD6_EPAD7_EPAD8_EPAD9_EPAD10_EPAD11_EPAD12(GND)

Not connected (* = marked no-connect by the designer): U10 2(~{SMI}) 25(~{PEWAKE}) 31(TEST_EN) 60(PCIE_TX1_P) 61(PCIE_TX1_N) 63(PCIE_RX1_P) 64(PCIE_RX1_N); U18 8(NC)

### Notes on the sheet
- A
- B
- C
- D
- E
- F
- G
- H
- 5
- 4
- 3
- 2
- 1
- Title:
- Board:
- PCIe to USB3.0
- design
- C:/Gumstix/gumstix-logo-16.bmp
- 1/25/2021 11:39:22 PM
- Sheet:
- 14

### Library data of the parts
C41-C44 C253 C254 C263-C269 C273 C280 C281 C286-C289 = GRM033R60J104KE19D: GateName_1: G$1; SymbolName_1: C-US; LibraryName: qualified_1@eagle_src_repo_701dee95a4f0c9d27f896634bd535ea9ef5a137e; DeviceSetName: GRM033R60J104KE19D; HEIGHT: 0.25
C45 C46 = C1608X5R1A106M080AC: GateName_1: G$1; SymbolName_1: C-US; LibraryName: qualified_1@eagle_src_repo_701dee95a4f0c9d27f896634bd535ea9ef5a137e; DeviceSetName: C1608X5R1A106M080AC; HEIGHT: 0.5
C158 C167 = CGB3B1X5R1A475K055AC: GateName_1: G$1; SymbolName_1: C-US; LibraryName: qualified_1@eagle_src_repo_701dee95a4f0c9d27f896634bd535ea9ef5a137e; DeviceSetName: CGB3B1X5R1A475K055AC; HEIGHT: 0.5
C270 = GRM033R71A682KA01D: GateName_1: G$1; SymbolName_1: C-US; LibraryName: qualified_1@eagle_src_repo_701dee95a4f0c9d27f896634bd535ea9ef5a137e; DeviceSetName: GRM033R71A682KA01D; HEIGHT: 0.25
C282 C283 = C1608X5R1C475K080AC: GateName_1: G$1; SymbolName_1: C-US; LibraryName: qualified_1@eagle_src_repo_701dee95a4f0c9d27f896634bd535ea9ef5a137e; DeviceSetName: C1608X5R1C475K080AC; HEIGHT: 0.5
C285 = UMK063CG100DTF: GateName_1: G$1; SymbolName_1: C-US; LibraryName: qualified_1@eagle_src_repo_701dee95a4f0c9d27f896634bd535ea9ef5a137e; DeviceSetName: UMK063CG100DTF; HEIGHT: 0.25
R27 R55 = RC0201FR-0710KL: GateName_1: G$1; SymbolName_1: R-US; LibraryName: qualified_1; DeviceSetName: RC0201FR-0710KL; HEIGHT: 0.25
R32 = RC0201FR-0712K1L: GateName_1: G$1; SymbolName_1: R-US; LibraryName: qualified_1; DeviceSetName: RC0201FR-0712K1L; HEIGHT: 0.25
R47 = RC0201FR-07100KL: GateName_1: G$1; SymbolName_1: R-US; LibraryName: qualified_1; DeviceSetName: RC0201FR-07100KL; HEIGHT: 0.25
SUPPLY84 SUPPLY87 SUPPLY99 SUPPLY141 SUPPLY162-SUPPLY165 = GND: SUPPLY SYMBOL; SymbolName_1: GND-2; GateName_1: GND; LibraryName: qualified_1; DeviceSetName: GND
U10 = ASM1142: ASM1142    PCI Express to 2 ports SuperSpeed USB 10Gbps xHCI Host Controller; GateName_1: G$1; SymbolName_1: ASM1142; LibraryName: qualified_1; DeviceSetName: ASM1142
U18 = ADP1740ACPZ-1.2-R7: ADP1740 series of fixed voltage LDO. Max 2A output at 0.75, 1, 1.1, 1.2, 1.3, 1.5, 1.8, 2.5V; GateName_1: G$1; SymbolName_1: AD17XXFIXED; LibraryName: qualified_1; DeviceSetName: ADP1740ACPZ-1.2-R7; AD17xx: AD17xx
Y3 = ABM8G-20.000MHZ-18-D2Y-T: GateName_1: G$1; SymbolName_1: Y4; LibraryName: qualified_1; DeviceSetName: ABM8G-20.000MHZ-18-D2Y-T; 1: 1; 3: 3; HEIGHT: 0.8

## Sheet design_16.SchDoc: design
size 414 x 279 mm; Date: 1/25/2021 11:39:22 PM; SheetNumber: 17; Origin: Eagle; GateName_1: G$1; SymbolName_1: A3-L-GUMSTIX; LibraryName: qualified_1; DeviceSetName: A3-L-GUMSTIX; A: A; B: B; C: C; D: D; E: E; F: F; G: G; H: H; 1: 1; 2: 2; 3: 3; 4: 4; 5: 5; Sheet: Sheet:; C:/Gumstix/gumstix-logo-16.bmp: C:/Gumstix/gumstix-logo-16.bmp; Board: Board:
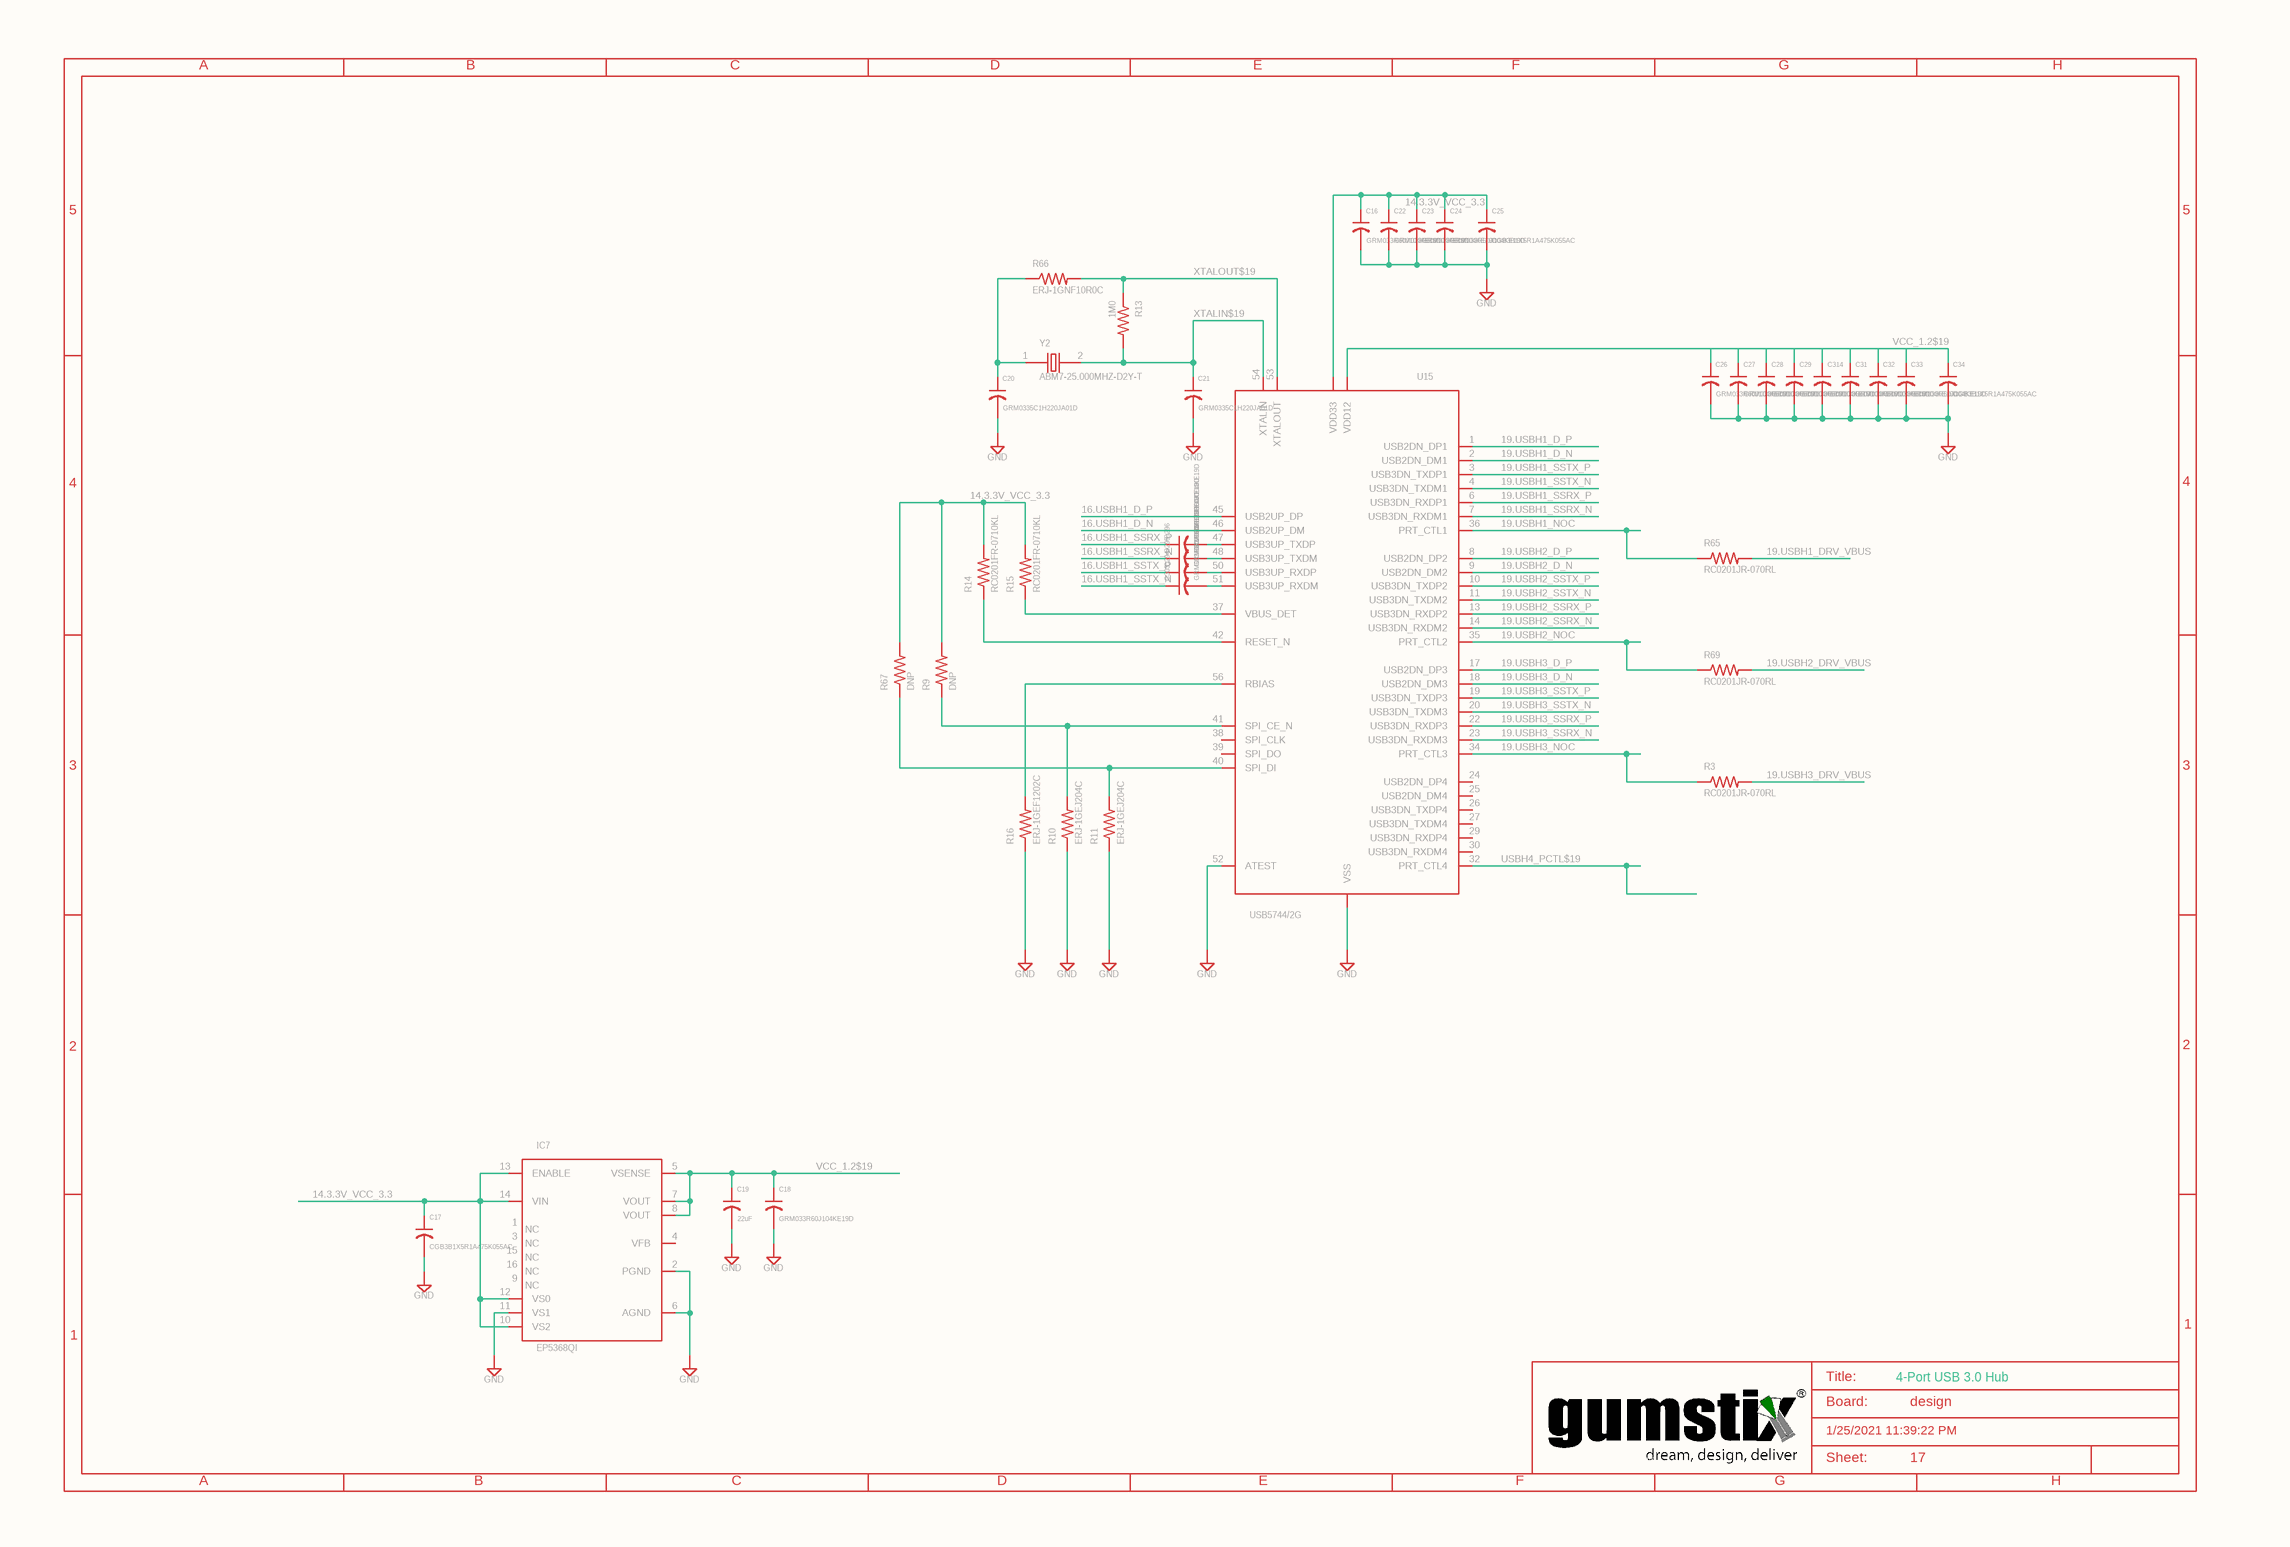
[diagram p5: design_16.SchDoc]

### Parts
C16  GRM033R60J104KE19D  [0201]
C17  CGB3B1X5R1A475K055AC  [0603]
C18  GRM033R60J104KE19D  [0201]
C19  22uF  [0805]
C20  GRM0335C1H220JA01D  [0201]
C21  GRM0335C1H220JA01D  [0201]
C22  GRM033R60J104KE19D  [0201]
C23  GRM033R60J104KE19D  [0201]
C24  GRM033R60J104KE19D  [0201]
C25  CGB3B1X5R1A475K055AC  [0603]
C26  GRM033R60J104KE19D  [0201]
C27  GRM033R60J104KE19D  [0201]
C28  GRM033R60J104KE19D  [0201]
C29  GRM033R60J104KE19D  [0201]
C31  GRM033R60J104KE19D  [0201]
C32  GRM033R60J104KE19D  [0201]
C33  GRM033R60J104KE19D  [0201]
C34  CGB3B1X5R1A475K055AC  [0603]
C294  GRM033R60J104KE19D  [0201]
C295  GRM033R60J104KE19D  [0201]
C296  GRM033R60J104KE19D  [0201]
C303  GRM033R60J104KE19D  [0201]
C314  GRM033R60J104KE19D  [0201]
IC7  EP5368QI  [EP-3X3MMQFN16]
R3  RC0201JR-070RL  [0201]
R9  DNP  [0201]
R10  ERJ-1GEJ204C  [0201]
R11  ERJ-1GEJ204C  [0201]
R13  1M0  [0201]
R14  RC0201FR-0710KL  [0201]
R15  RC0201FR-0710KL  [0201]
R16  ERJ-1GEF1202C  [0201]
R65  RC0201JR-070RL  [0201]
R66  ERJ-1GNF10R0C  [0201]
R67  DNP  [0201]
R69  RC0201JR-070RL  [0201]
SUPPLY15  GND
SUPPLY16  GND
SUPPLY17  GND
SUPPLY18  GND
SUPPLY19  GND
SUPPLY20  GND
SUPPLY21  GND
SUPPLY22  GND
SUPPLY23  GND
SUPPLY187  GND
U15  USB5744/2G  [VQFN56]
V1  GND
V2  GND
V3  GND
V5  GND
Y2  ABM7-25.000MHZ-D2Y-T  [CS10]

### Nets
14.3.3V_VCC_3.3: C16.1 C17.1 C22.1 C23.1 C24.1 C25.1 IC7.10(VS2) IC7.12(VS0) IC7.13(ENABLE) IC7.14(VIN) R9.2 R14.2 R15.2 R67.2 U15.16_31_44_55(VDD33)
16.USBH1_D_N: U15.46(USB2UP_DM)
16.USBH1_D_P: U15.45(USB2UP_DP)
16.USBH1_SSRX_N: C295.1
16.USBH1_SSRX_P: C296.1
16.USBH1_SSTX_N: C303.1
16.USBH1_SSTX_P: C294.1
19.USBH1_D_N: U15.2(USB2DN_DM1)
19.USBH1_D_P: U15.1(USB2DN_DP1)
19.USBH1_DRV_VBUS: R65.2
19.USBH1_NOC: R65.1 U15.36(PRT_CTL1)
19.USBH1_SSRX_N: U15.7(USB3DN_RXDM1)
19.USBH1_SSRX_P: U15.6(USB3DN_RXDP1)
19.USBH1_SSTX_N: U15.4(USB3DN_TXDM1)
19.USBH1_SSTX_P: U15.3(USB3DN_TXDP1)
19.USBH2_D_N: U15.9(USB2DN_DM2)
19.USBH2_D_P: U15.8(USB2DN_DP2)
19.USBH2_DRV_VBUS: R69.2
19.USBH2_NOC: R69.1 U15.35(PRT_CTL2)
19.USBH2_SSRX_N: U15.14(USB3DN_RXDM2)
19.USBH2_SSRX_P: U15.13(USB3DN_RXDP2)
19.USBH2_SSTX_N: U15.11(USB3DN_TXDM2)
19.USBH2_SSTX_P: U15.10(USB3DN_TXDP2)
19.USBH3_D_N: U15.18(USB2DN_DM3)
19.USBH3_D_P: U15.17(USB2DN_DP3)
19.USBH3_DRV_VBUS: R3.2
19.USBH3_NOC: R3.1 U15.34(PRT_CTL3)
19.USBH3_SSRX_N: U15.23(USB3DN_RXDM3)
19.USBH3_SSRX_P: U15.22(USB3DN_RXDP3)
19.USBH3_SSTX_N: U15.20(USB3DN_TXDM3)
19.USBH3_SSTX_P: U15.19(USB3DN_TXDP3)
USBH4_PCTL$19: U15.32(PRT_CTL4)
VCC_1.2$19: C18.1 C19.1 C26.1 C27.1 C28.1 C29.1 C31.1 C32.1 C33.1 C34.1 C314.1 IC7.5(VSENSE) IC7.7(VOUT) IC7.8(VOUT) U15.5_12_15_21_28_33_43_49(VDD12)
XTALIN$19: C21.1 R13.2 U15.54(XTALIN) Y2.2
XTALOUT$19: R13.1 R66.2 U15.53(XTALOUT)
NetC16_2: C16.2 C22.2 C23.2 C24.2 C25.2 V1.?1(GND)
NetC17_2: C17.2 SUPPLY15.?1(GND)
NetC18_2: C18.2 SUPPLY19.?1(GND)
NetC19_2: C19.2 SUPPLY18.?1(GND)
NetC20_1: C20.1 R66.1 Y2.1
NetC20_2: C20.2 V3.?1(GND)
NetC21_2: C21.2 V5.?1(GND)
NetC26_2: C26.2 C27.2 C28.2 C29.2 C31.2 C32.2 C33.2 C34.2 C314.2 V2.?1(GND)
NetC294_2: C294.2 U15.50(USB3UP_RXDP)
NetC295_2: C295.2 U15.48(USB3UP_TXDM)
NetC296_2: C296.2 U15.47(USB3UP_TXDP)
NetC303_2: C303.2 U15.51(USB3UP_RXDM)
NetIC7_2: IC7.2(PGND) IC7.6(AGND) SUPPLY17.?1(GND)
NetIC7_11: IC7.11(VS1) SUPPLY16.?1(GND)
NetR9_1: R9.1 R10.2 U15.41(SPI_CE_N)
NetR10_1: R10.1 SUPPLY22.?1(GND)
NetR11_1: R11.1 SUPPLY21.?1(GND)
NetR11_2: R11.2 R67.1 U15.40(SPI_DI)
NetR14_1: R14.1 U15.42(RESET_N)
NetR15_1: R15.1 U15.37(VBUS_DET)
NetR16_1: R16.1 SUPPLY187.?1(GND)
NetR16_2: R16.2 U15.56(RBIAS)
NetSUPPLY20_?1: SUPPLY20.?1(GND) U15.P$1_P$2_P$3_P$4_P$5_P$6_P$7_P$8_P$9_P$10_P$11_P$12_P$13_P$14_P$15_P$16_P$17_P$18_P$19_P$20_P$21_P$22_P$23_P$24_P$25(VSS)
NetSUPPLY23_?1: SUPPLY23.?1(GND) U15.52(ATEST)

Not connected (* = marked no-connect by the designer): IC7 1(NC) 3(NC) 4(VFB) 9(NC) 15(NC) 16(NC); U15 24(USB2DN_DP4) 25(USB2DN_DM4) 26(USB3DN_TXDP4) 27(USB3DN_TXDM4) 29(USB3DN_RXDP4) 30(USB3DN_RXDM4) 38(SPI_CLK) 39(SPI_DO)

### Notes on the sheet
- A
- B
- C
- D
- E
- F
- G
- H
- 5
- 4
- 3
- 2
- 1
- Title:
- Board:
- 4-Port USB 3.0 Hub
- design
- C:/Gumstix/gumstix-logo-16.bmp
- 1/25/2021 11:39:22 PM
- Sheet:
- 17

### Library data of the parts
C16 C18 C22-C24 C26-C29 C31-C33 C294-C296 C303 C314 = GRM033R60J104KE19D: GateName_1: G$1; SymbolName_1: C-US; LibraryName: qualified_1@eagle_src_repo_b39d46a5feff4f7ade7f2a4f70c4d4847a03ea32; DeviceSetName: GRM033R60J104KE19D; HEIGHT: 0.25
C17 C25 C34 = CGB3B1X5R1A475K055AC: GateName_1: G$1; SymbolName_1: C-US; LibraryName: qualified_1@eagle_src_repo_b39d46a5feff4f7ade7f2a4f70c4d4847a03ea32; DeviceSetName: CGB3B1X5R1A475K055AC; HEIGHT: 0.5
  C17: DM: DM; DR: DR; DX: DX; DY: DY; SHEETNO: SHEETNO
C19 = C0805: GateName_1: G$1; SymbolName_1: C-US; DeviceSetName: C; DeviceName: 0805; LibraryName: qualified_1@eagle_src_repo_b39d46a5feff4f7ade7f2a4f70c4d4847a03ea32; HEIGHT: 0.51
C20 C21 = GRM0335C1H220JA01D: GateName_1: G$1; SymbolName_1: C-US; LibraryName: qualified_1@eagle_src_repo_b39d46a5feff4f7ade7f2a4f70c4d4847a03ea32; DeviceSetName: GRM0335C1H220JA01D; DM: DM; DR: DR; DX: DX; DY: DY; HEIGHT: 0.25; SHEETNO: SHEETNO
IC7 = EP5368QI: GateName_1: G$1; SymbolName_1: EP5368; LibraryName: qualified_1; DeviceSetName: EP5368QI; HEIGHT: 1.1
R3 R65 R69 = RC0201JR-070RL: GateName_1: G$1; SymbolName_1: R-US; LibraryName: qualified_1; DeviceSetName: RC0201JR-070RL; DM: DM; DR: DR; DX: DX; DY: DY; HEIGHT: 0.25; SHEETNO: SHEETNO
R9 R13 R67 = R0201: as R48 on sheet design_10; DeviceName: 0201; LibraryName: qualified_1; HEIGHT: 0.25
  R13: DM: DM; DR: DR; DX: DX; DY: DY; SHEETNO: SHEETNO
R10 R11 = ERJ-1GEJ204C: GateName_1: G$1; SymbolName_1: R-US; LibraryName: qualified_1; DeviceSetName: ERJ-1GEJ204C; HEIGHT: 0.25
R14 R15 = RC0201FR-0710KL: GateName_1: G$1; SymbolName_1: R-US; LibraryName: qualified_1; DeviceSetName: RC0201FR-0710KL; DM: DM; DR: DR; DX: DX; DY: DY; HEIGHT: 0.25; SHEETNO: SHEETNO
R16 = ERJ-1GEF1202C: GateName_1: G$1; SymbolName_1: R-US; LibraryName: qualified_1; DeviceSetName: ERJ-1GEF1202C; HEIGHT: 0.25
R66 = ERJ-1GNF10R0C: GateName_1: G$1; SymbolName_1: R-US; LibraryName: qualified_1; DeviceSetName: ERJ-1GNF10R0C; DM: DM; DR: DR; DX: DX; DY: DY; HEIGHT: 0.25; SHEETNO: SHEETNO
SUPPLY15-SUPPLY23 SUPPLY187 V1-V3 V5 = GND: SUPPLY SYMBOL; SymbolName_1: GND-2; GateName_1: GND; LibraryName: qualified_1; DeviceSetName: GND
  V1-V3 V5: SHEETNO: SHEETNO
U15 = USB5744/2G: USB5744    4-Port SS/HS USB Controller Hub    http://ww1.microchip.com/downloads/en/DeviceDoc/00001855D.pdf; GateName_1: U1; SymbolName_1: USB5744; LibraryName: qualified_1; DeviceSetName: USB5744/2G
Y2 = ABM7-25.000MHZ-D2Y-T: GateName_1: G$1; SymbolName_1: Q1; LibraryName: qualified_1@eagle_src_repo_b39d46a5feff4f7ade7f2a4f70c4d4847a03ea32; DeviceSetName: ABM7-25.000MHZ-D2Y-T; 1: 1; 2: 2; DM: DM; DR: DR; DX: DX; DY: DY; HEIGHT: 1.5; SHEETNO: SHEETNO

## Sheet design_17.SchDoc: design
size 414 x 279 mm; Date: 1/25/2021 11:39:22 PM; SheetNumber: 18; Origin: Eagle; GateName_1: G$1; SymbolName_1: A3-L-GUMSTIX; LibraryName: qualified_1; DeviceSetName: A3-L-GUMSTIX; A: A; B: B; C: C; D: D; E: E; F: F; G: G; H: H; 1: 1; 2: 2; 3: 3; 4: 4; 5: 5; Sheet: Sheet:; C:/Gumstix/gumstix-logo-16.bmp: C:/Gumstix/gumstix-logo-16.bmp; Board: Board:
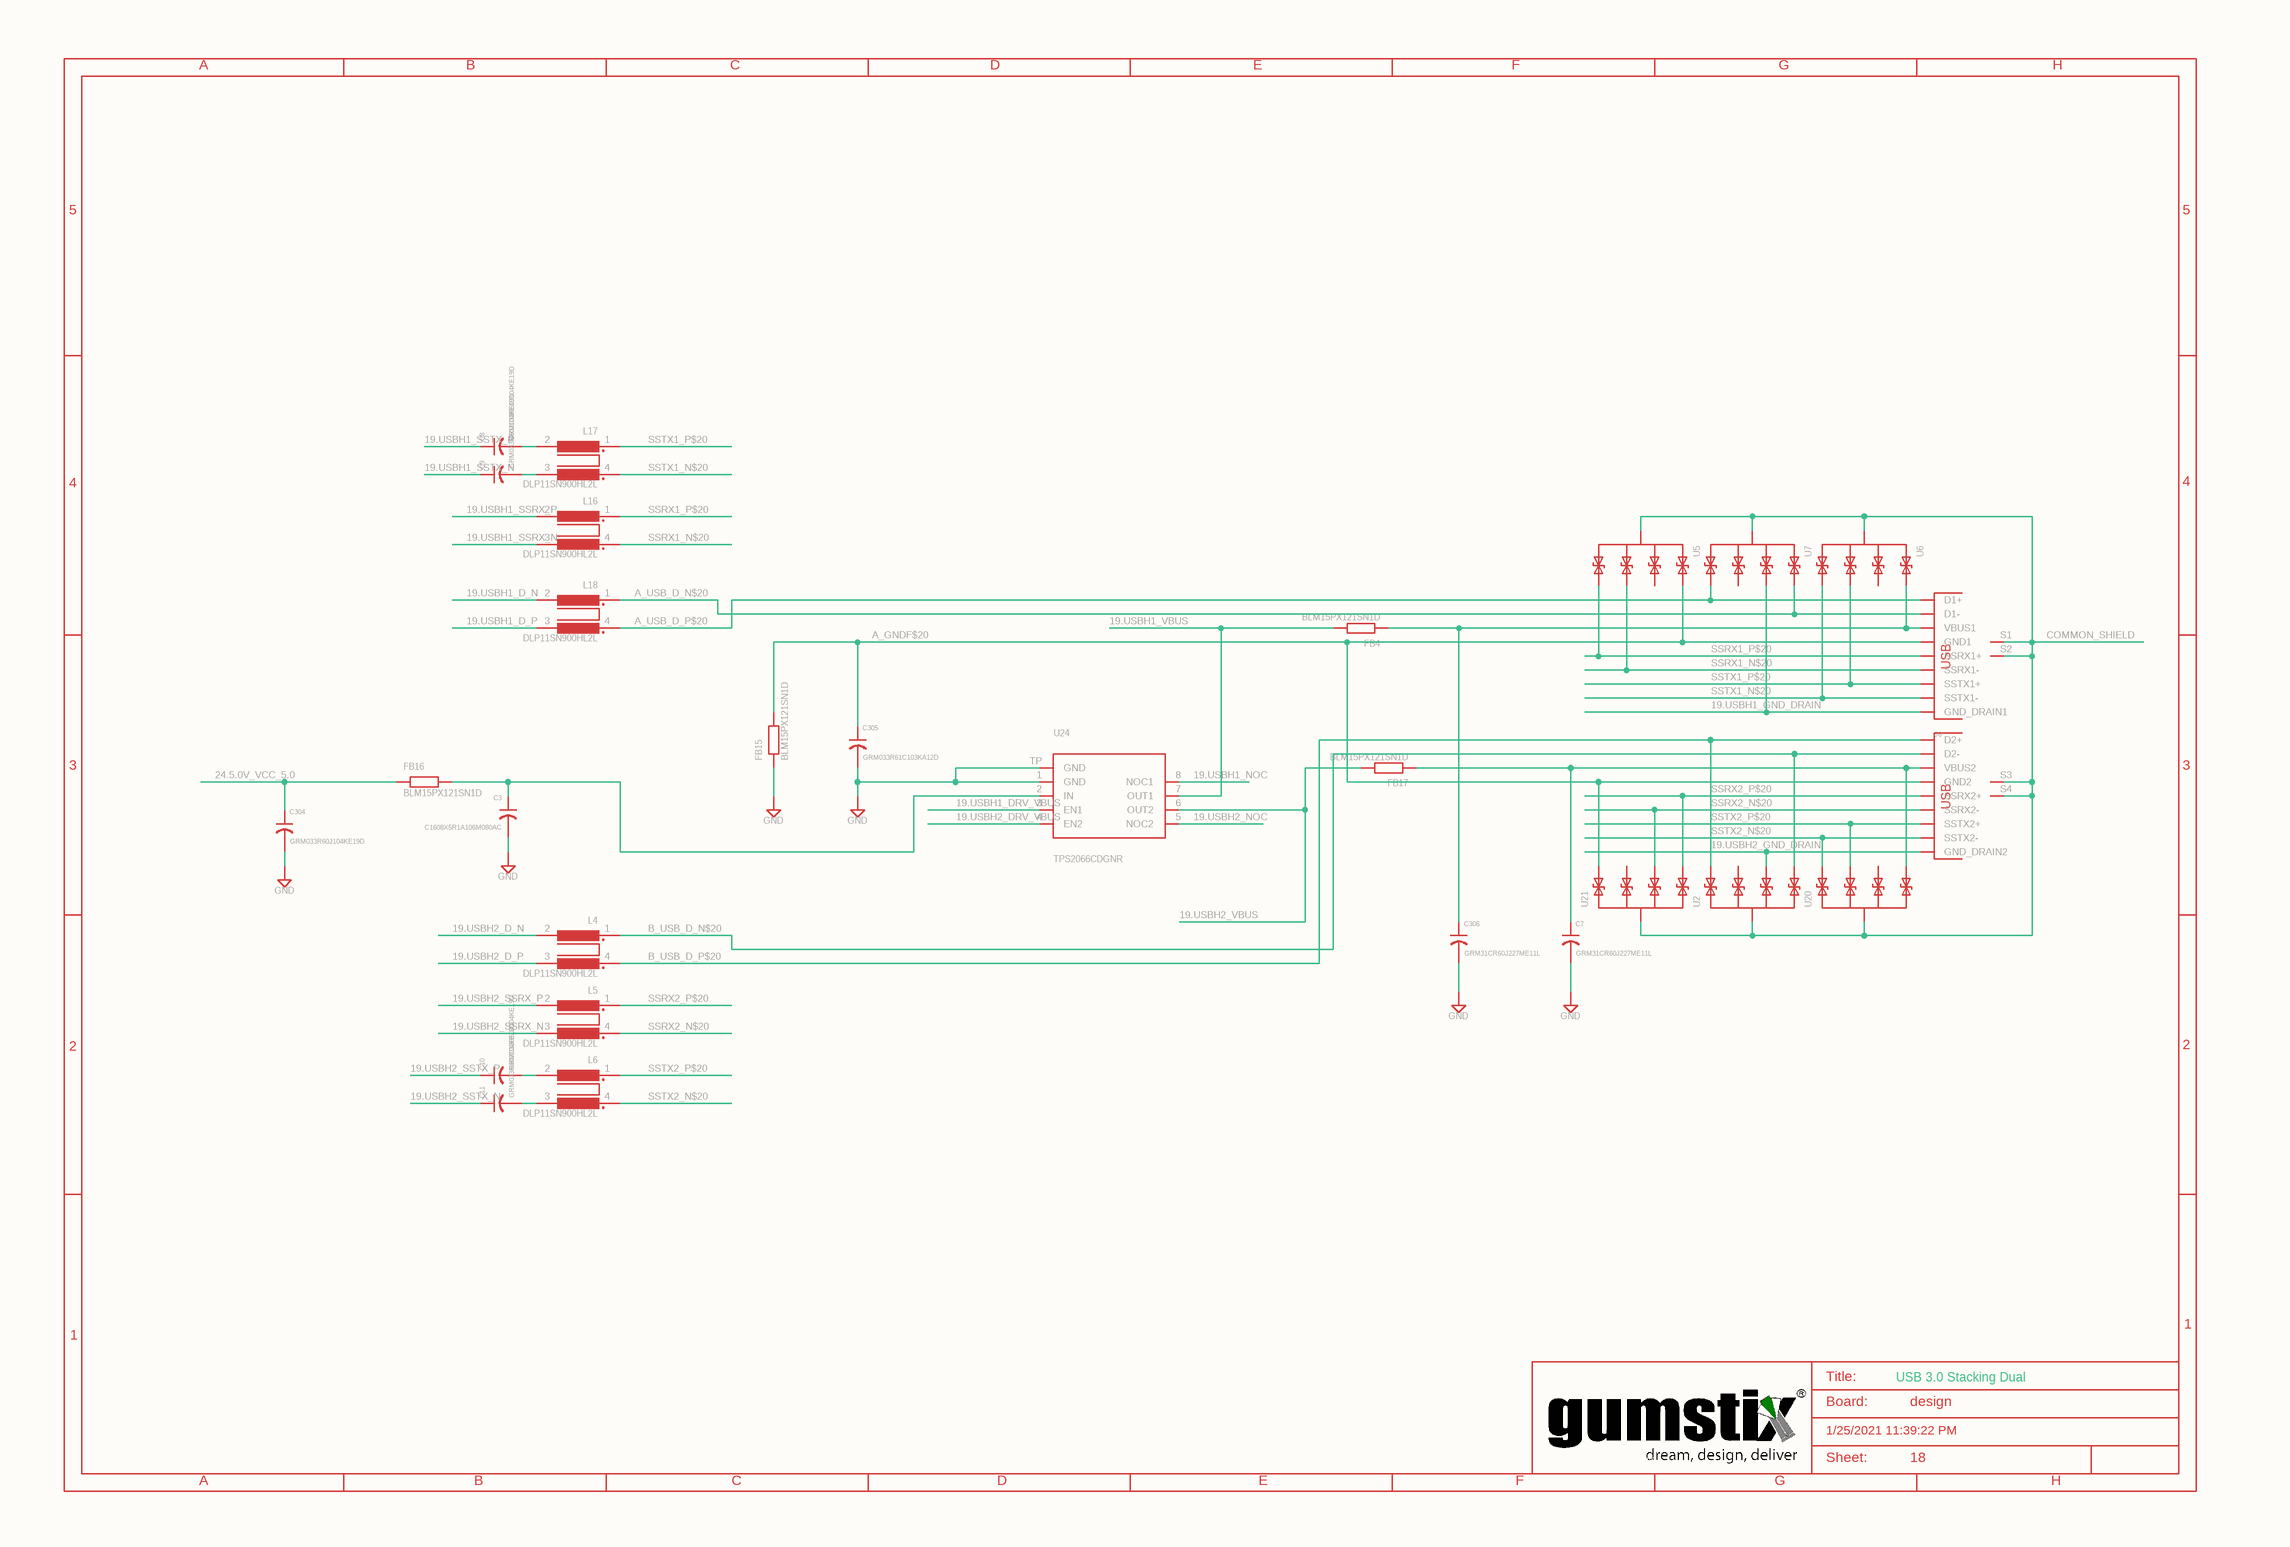
[diagram p6: design_17.SchDoc]

### Parts
C3  C1608X5R1A106M080AC  [0603]
C7  GRM31CR60J227ME11L  [1206]
C8  GRM033R60J104KE19D  [0201]
C9  GRM033R60J104KE19D  [0201]
C10  GRM033R60J104KE19D  [0201]
C11  GRM033R60J104KE19D  [0201]
C304  GRM033R60J104KE19D  [0201]
C305  GRM033R61C103KA12D  [0201]
C306  GRM31CR60J227ME11L  [1206]
FB4  BLM15PX121SN1D  [0402]
FB15  BLM15PX121SN1D  [0402]
FB16  BLM15PX121SN1D  [0402]
FB17  BLM15PX121SN1D  [0402]
J6  GSB311231HR  [USB3-A-H-DUAL]  (value not drawn)
L4  DLP11SN900HL2L  [0504-DLP11S]
L5  DLP11SN900HL2L  [0504-DLP11S]
L6  DLP11SN900HL2L  [0504-DLP11S]
L16  DLP11SN900HL2L  [0504-DLP11S]
L17  DLP11SN900HL2L  [0504-DLP11S]
L18  DLP11SN900HL2L  [0504-DLP11S]
SUPPLY10  GND
SUPPLY12  GND
SUPPLY172  GND
SUPPLY173  GND
SUPPLY179  GND
SUPPLY193  GND
U2  TPD4E02B04DQAR  [UFDFN-10]  (value not drawn)
U5  TPD4E02B04DQAR  [UFDFN-10]  (value not drawn)
U6  TPD4E02B04DQAR  [UFDFN-10]  (value not drawn)
U7  TPD4E02B04DQAR  [UFDFN-10]  (value not drawn)
U20  TPD4E02B04DQAR  [UFDFN-10]  (value not drawn)
U21  TPD4E02B04DQAR  [UFDFN-10]  (value not drawn)
U24  TPS2066CDGNR  [MSOP8-PAD]

### Nets
19.USBH1_D_N: L18.2
19.USBH1_D_P: L18.3
19.USBH1_DRV_VBUS: U24.3(EN1)
19.USBH1_GND_DRAIN: J6.7(GND_DRAIN1) U7.2_9(P2)
19.USBH1_NOC: U24.8(NOC1)
19.USBH1_SSRX_N: L16.3
19.USBH1_SSRX_P: L16.2
19.USBH1_SSTX_N: C9.1
19.USBH1_SSTX_P: C8.1
19.USBH1_VBUS: FB4.2 U24.7(OUT1)
19.USBH2_D_N: L4.2
19.USBH2_D_P: L4.3
19.USBH2_DRV_VBUS: U24.4(EN2)
19.USBH2_GND_DRAIN: J6.12(D2+) J6.14(SSRX2-) J6.15(SSRX2+) J6.16(GND_DRAIN2) J6.17(SSTX2-) J6.18(SSTX2+) L4.4 L5.1 L5.4 L6.1 L6.4 U2.1_10(P1) U2.4_7(P3) U20.1_10(P1) U20.2_9(P2) U21.4_7(P3) U21.5_6(P4)  [also labelled B_USB_D_P$20, SSRX2_N$20, SSRX2_P$20, SSTX2_N$20, SSTX2_P$20]
19.USBH2_NOC: U24.5(NOC2)
19.USBH2_SSRX_N: L5.3
19.USBH2_SSRX_P: L5.2
19.USBH2_SSTX_N: C11.1
19.USBH2_SSTX_P: C10.1
19.USBH2_VBUS: FB17.2 U24.6(OUT2)
24.5.0V_VCC_5.0: C304.1 FB16.1
A_GNDF$20: C305.1 FB15.2 J6.4(GND1) J6.13(GND2) U5.1_10(P1) U21.1_10(P1)
A_USB_D_N$20: J6.2(D1-) L18.1 U7.1_10(P1)
A_USB_D_P$20: J6.3(D1+) L18.4 U7.5_6(P4)
B_USB_D_N$20: J6.11(D2-) L4.1 U2.5_6(P4)
COMMON_SHIELD: J6.S1(SH1) J6.S2(SH2) J6.S3(SH3) J6.S4(SH4) U2.3_8(SHIELD) U5.3_8(SHIELD) U6.3_8(SHIELD) U7.3_8(SHIELD) U20.3_8(SHIELD) U21.3_8(SHIELD)
SSRX1_N$20: J6.5(SSRX1-) L16.4 U5.4_7(P3)
SSRX1_P$20: J6.6(SSRX1+) L16.1 U5.5_6(P4)
SSTX1_N$20: J6.8(SSTX1-) L17.4 U6.5_6(P4)
SSTX1_P$20: J6.9(SSTX1+) L17.1 U6.4_7(P3)
NetC3_1: C3.1 FB16.2 U24.2(IN)
NetC3_2: C3.2 SUPPLY179.?1(GND)
NetC7_1: C7.1 FB17.1 J6.10(VBUS2) U20.5_6(P4)
NetC7_2: C7.2 SUPPLY193.?1(GND)
NetC8_2: C8.2 L17.2
NetC9_2: C9.2 L17.3
NetC10_2: C10.2 L6.2
NetC11_2: C11.2 L6.3
NetC304_2: C304.2 SUPPLY12.?1(GND)
NetC305_2: C305.2 SUPPLY10.?1(GND) U24.1(GND) U24.TP(GND)
NetC306_1: C306.1 FB4.1 J6.1(VBUS1) U6.1_10(P1)
NetC306_2: C306.2 SUPPLY173.?1(GND)
NetFB15_1: FB15.1 SUPPLY172.?1(GND)

Not connected (* = marked no-connect by the designer): U2 2 9(P2); U5 2 9(P2); U6 2 9(P2); U7 4 7(P3); U20 4 7(P3); U21 2 9(P2)

### Notes on the sheet
- A
- B
- C
- D
- E
- F
- G
- H
- 5
- 4
- 3
- 2
- 1
- Title:
- Board:
- USB 3.0 Stacking Dual
- design
- C:/Gumstix/gumstix-logo-16.bmp
- 1/25/2021 11:39:22 PM
- Sheet:
- 18

### Library data of the parts
C3 = C1608X5R1A106M080AC: GateName_1: G$1; SymbolName_1: C-US; LibraryName: qualified_1@eagle_src_repo_d00aa7e5b0aed880e2479218df7f64b10b504166; DeviceSetName: C1608X5R1A106M080AC; DM: DM; DR: DR; DX: DX; DY: DY; HEIGHT: 0.5; SHEETNO: SHEETNO
C7 C306 = GRM31CR60J227ME11L: GateName_1: G$1; SymbolName_1: C-US; LibraryName: qualified_1@eagle_src_repo_d00aa7e5b0aed880e2479218df7f64b10b504166; DeviceSetName: GRM31CR60J227ME11L; HEIGHT: 0.51
C8-C11 C304 = GRM033R60J104KE19D: GateName_1: G$1; SymbolName_1: C-US; LibraryName: qualified_1@eagle_src_repo_d00aa7e5b0aed880e2479218df7f64b10b504166; DeviceSetName: GRM033R60J104KE19D; HEIGHT: 0.25
  C304: DM: DM; DR: DR; DX: DX; DY: DY; SHEETNO: SHEETNO
C305 = GRM033R61C103KA12D: GateName_1: G$1; SymbolName_1: C-US; LibraryName: qualified_1@eagle_src_repo_d00aa7e5b0aed880e2479218df7f64b10b504166; DeviceSetName: GRM033R61C103KA12D; DM: DM; DR: DR; DX: DX; DY: DY; HEIGHT: 0.25; SHEETNO: SHEETNO
FB4 FB15-FB17 = BLM15PX121SN1D: GateName_1: G$1; SymbolName_1: FB; LibraryName: qualified_1@eagle_src_repo_d00aa7e5b0aed880e2479218df7f64b10b504166; DeviceSetName: BLM15PX121SN1D; DM: DM; DR: DR; DX: DX; DY: DY; HEIGHT: 0.35; SHEETNO: SHEETNO
J6 = GSB311231HR: USB 3.0 Stacking Dual Host Port    http://media.digikey.com/pdf/Data%20Sheets/Amphenol%20PDFs/GSB31123xxHR_Dwg.PDF; GateName_1: J1; SymbolName_1: USB3-H-DUAL; LibraryName: qualified_1; DeviceSetName: GSB311231HR; USB: USB
L4-L6 L16-L18 = DLP11SN900HL2L: GateName_1: G$1; SymbolName_1: COM_MODE_CHOKE_DLP; LibraryName: qualified_1@eagle_src_repo_d00aa7e5b0aed880e2479218df7f64b10b504166; DeviceSetName: DLP11SN900HL2L; HEIGHT: 0.83
SUPPLY10 SUPPLY12 SUPPLY172 SUPPLY173 SUPPLY179 SUPPLY193 = GND: SUPPLY SYMBOL; SymbolName_1: GND-2; GateName_1: GND; LibraryName: qualified_1; DeviceSetName: GND
U2 U5-U7 U20 U21 = TPD4E02B04DQAR: TPD4E02B04 4-Channel ESD Protection Diode for USB Type-C and HDMI 2.0    http://www.ti.com/lit/ds/symlink/tpd4e02b04.pdf; GateName_1: G1; SymbolName_1: ESD-DIODE-4; LibraryName: qualified_1; DeviceSetName: TPD4E02B04DQAR
U24 = TPS2066CDGNR: GateName_1: G$1; SymbolName_1: TPS2052; LibraryName: qualified_1; DeviceSetName: TPS2066CDGNR; HEIGHT: 1.1

## Sheet design_18.SchDoc
size 414 x 279 mm; Origin: Eagle
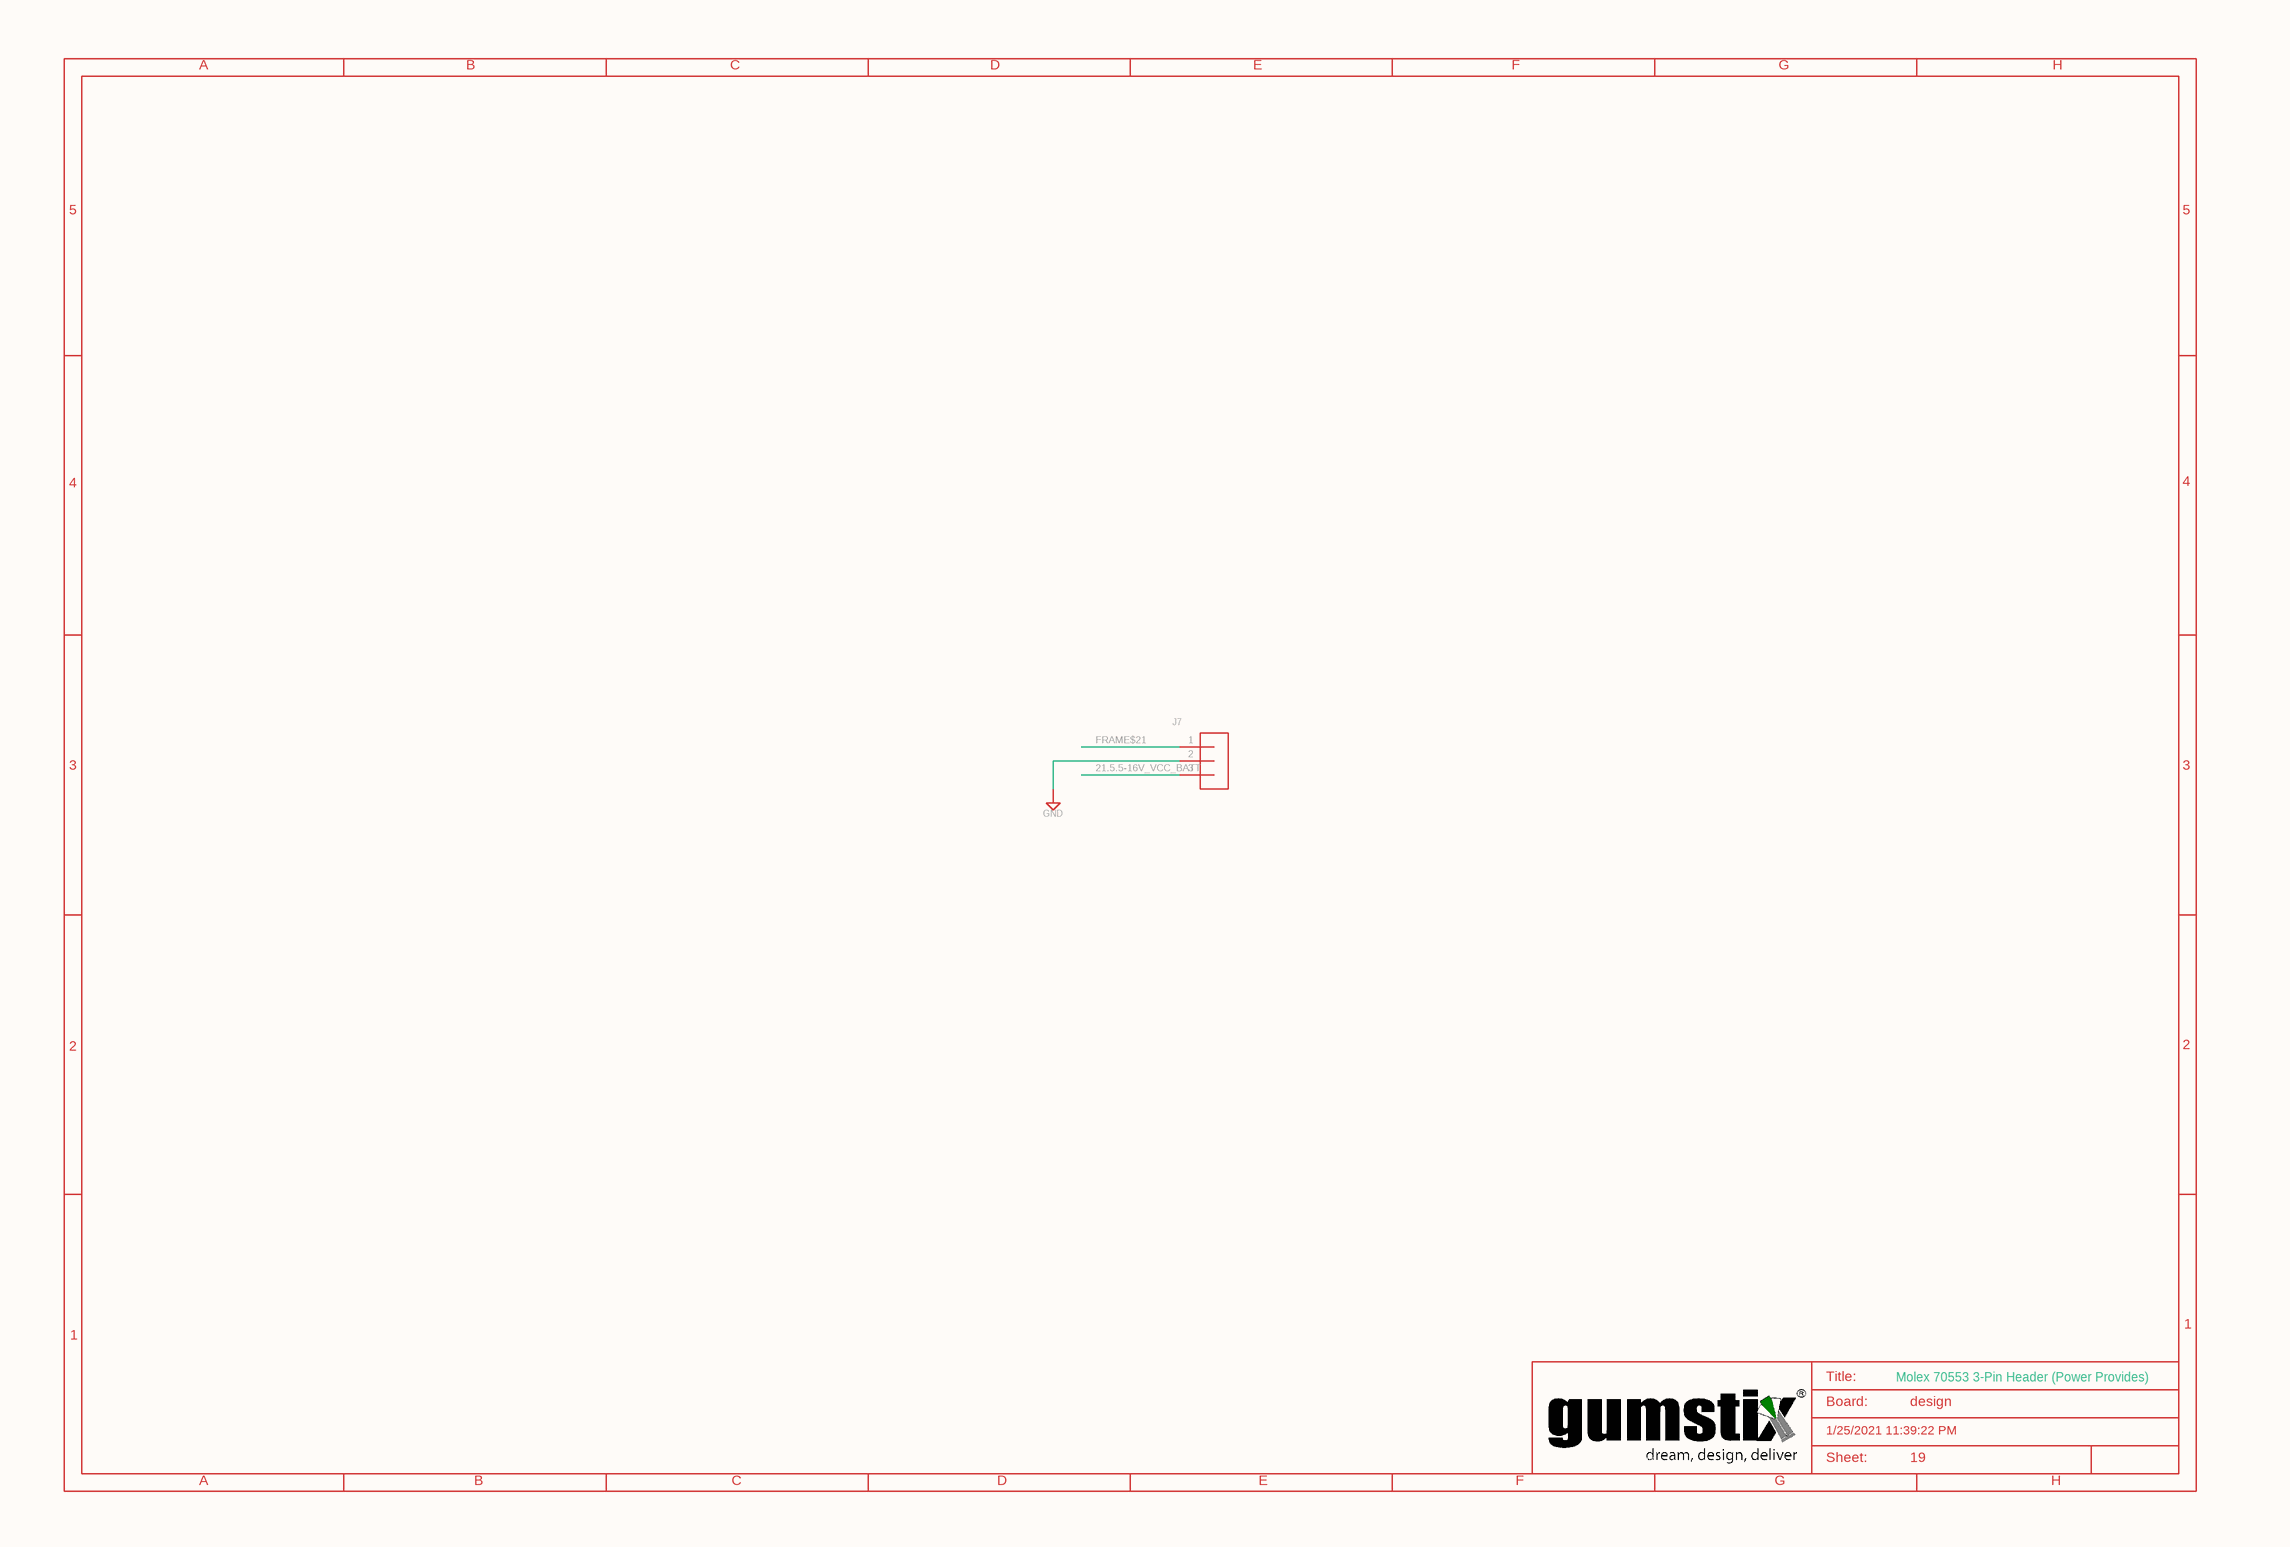
[diagram p7: design_18.SchDoc]

### Parts
J7  70553-0002  [1X03_90_TH_SHROUD]  (value not drawn)
SUPPLY192  GND
U$32  DRAWING_NAME: design  LAST_DATE_TIME: 1/25/2021 11:39:22 PM  SHEET: 19  Sheet: Sheet:  Title: Title:  Board: Board:  (hidden comment: A3-L-GUMSTIX)

### Nets
21.5.5-16V_VCC_BATT: J7.3
FRAME$21: J7.1
NetJ7_2: J7.2 SUPPLY192.?1(GND)

### Notes on the sheet
- Molex 70553 3-Pin Header (Power Provides)

### Library data of the parts
J7 = 70553-0002: Detailed Description	Connector Header Through Hole, Right Angle 3 position 0.100" (2.54mm) [SL 70533 Series]; GateName_1: G$1; SymbolName_1: 1X03; LibraryName: qualified_1; DeviceSetName: 70553-0002
SUPPLY192 = GND: SUPPLY SYMBOL; GateName_1: GND; SymbolName_1: GND; LibraryName: supply2; DeviceSetName: GND
U$32 = A3-L-GUMSTIX: GateName_1: G$1; SymbolName_1: A3-L-GUMSTIX; LibraryName: qualified_1; DeviceSetName: A3-L-GUMSTIX; A: A; B: B; C: C; D: D; E: E; F: F; G: G; H: H; 1: 1; 2: 2; 3: 3; 4: 4; 5: 5; C:/Gumstix/gumstix-logo-16.bmp: C:/Gumstix/gumstix-logo-16.bmp

## Sheet design_22.SchDoc: design
size 414 x 279 mm; Date: 1/25/2021 11:39:22 PM; SheetNumber: 23; Origin: Eagle; GateName_1: G$1; SymbolName_1: A3-L-GUMSTIX; LibraryName: qualified_1; DeviceSetName: A3-L-GUMSTIX; A: A; B: B; C: C; D: D; E: E; F: F; G: G; H: H; 1: 1; 2: 2; 3: 3; 4: 4; 5: 5; Sheet: Sheet:; C:/Gumstix/gumstix-logo-16.bmp: C:/Gumstix/gumstix-logo-16.bmp; Board: Board:
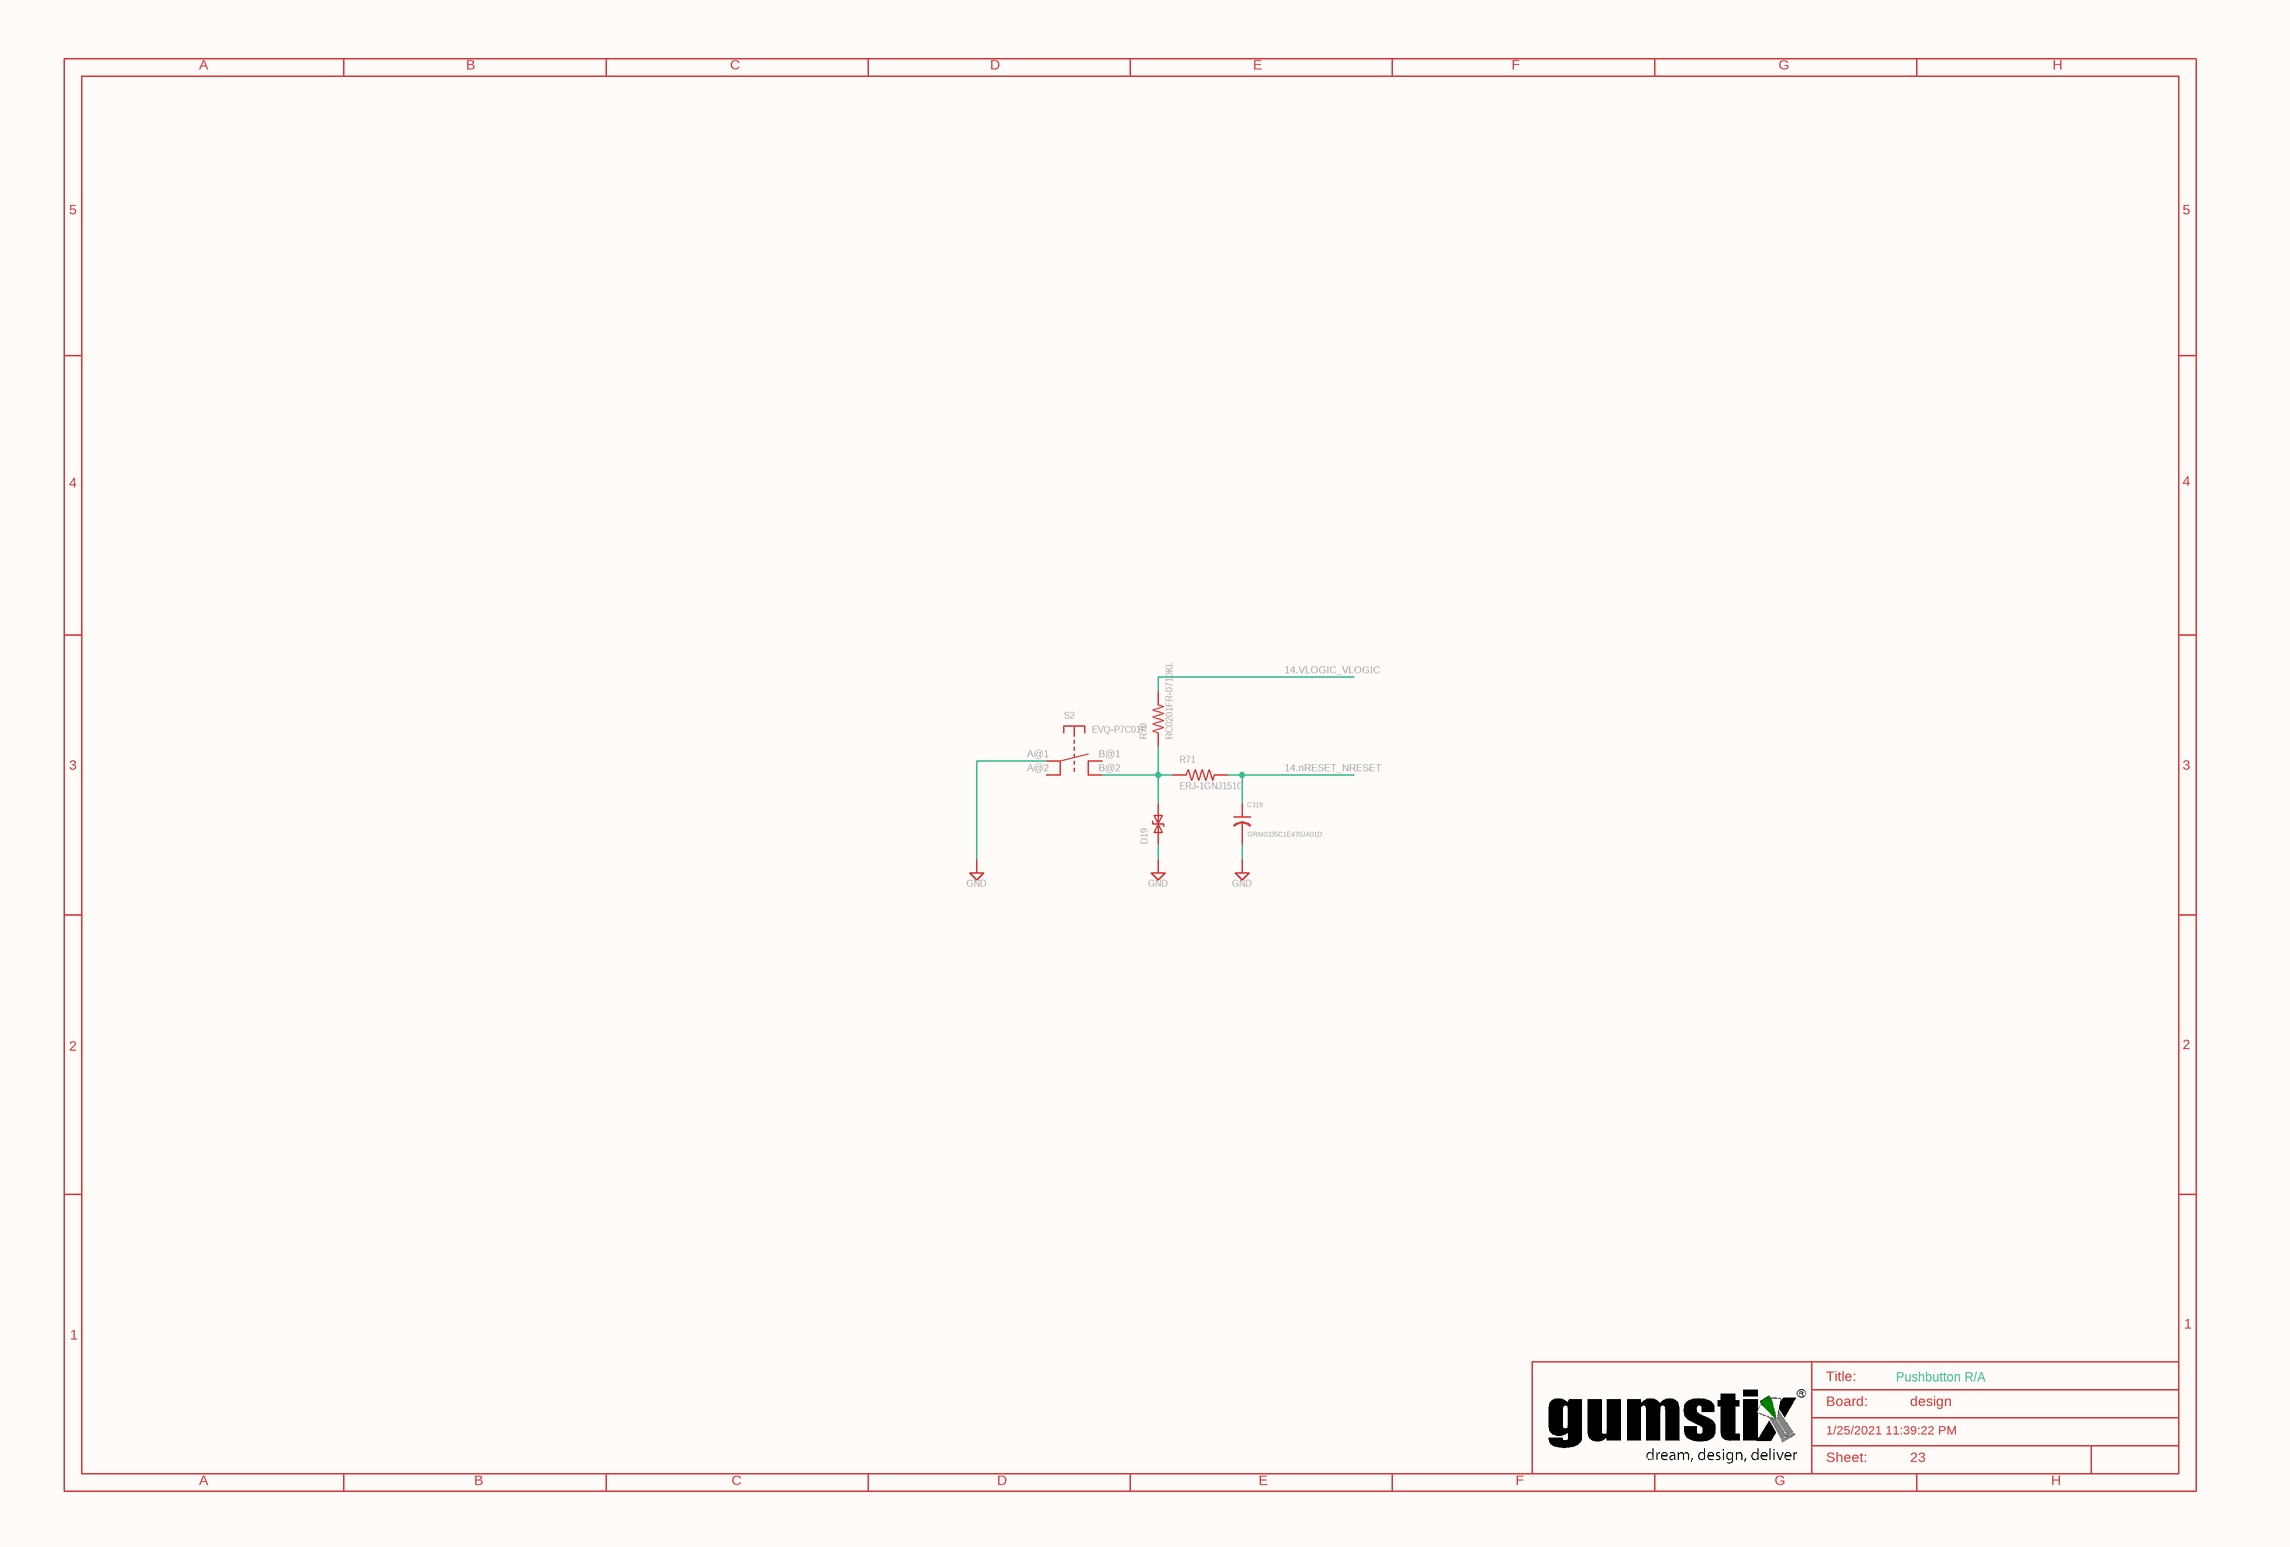
[diagram p8: design_22.SchDoc]

### Parts
C319  GRM0335C1E470JA01D  [0201]
D19  B72590D0050A060  [D0402]  (value not drawn)
R70  RC0201FR-0710KL  [0201]
R71  ERJ-1GNJ151C  [0201]
S2  EVQ-P7C01P  [EVQP-4]
SUPPLY195  GND
SUPPLY196  GND
SUPPLY197  GND

### Nets
14.nRESET_NRESET: C319.1 R71.2
14.VLOGIC_VLOGIC: R70.2
NetC319_2: C319.2 SUPPLY197.?1(GND)
NetD19_P1: D19.P1 SUPPLY196.?1(GND)
NetD19_P2: D19.P2 R70.1 R71.1 S2.B@2(B')
NetS2_A@1: S2.A@1(A) SUPPLY195.?1(GND)

Not connected (* = marked no-connect by the designer): S2 A@2(A') B@1(B)

### Notes on the sheet
- A
- B
- C
- D
- E
- F
- G
- H
- 5
- 4
- 3
- 2
- 1
- Title:
- Board:
- Pushbutton R/A
- design
- C:/Gumstix/gumstix-logo-16.bmp
- 1/25/2021 11:39:22 PM
- Sheet:
- 23

### Library data of the parts
C319 = GRM0335C1E470JA01D: GateName_1: G$1; SymbolName_1: C-US; LibraryName: qualified_1@eagle_src_repo_c6614e3cc11e779d3ff6357e0a9e972de604ed16; DeviceSetName: GRM0335C1E470JA01D; HEIGHT: 0.25
D19 = B72590D0050A060: GateName_1: G$1; SymbolName_1: ESD-DIODE; LibraryName: qualified_1; DeviceSetName: B72590D0050A060; HEIGHT: 0.35
R70 = RC0201FR-0710KL: GateName_1: G$1; SymbolName_1: R-US; LibraryName: qualified_1@eagle_src_repo_c6614e3cc11e779d3ff6357e0a9e972de604ed16; DeviceSetName: RC0201FR-0710KL; HEIGHT: 0.25
R71 = ERJ-1GNJ151C: GateName_1: G$1; SymbolName_1: R-US; LibraryName: qualified_1@eagle_src_repo_c6614e3cc11e779d3ff6357e0a9e972de604ed16; DeviceSetName: ERJ-1GNJ151C; HEIGHT: 0.25
S2 = EVQ-P7C01P: GateName_1: G$1; SymbolName_1: TS-; LibraryName: qualified_1; DeviceSetName: EVQ-P7C01P; HEIGHT: 2.5
SUPPLY195-SUPPLY197 = GND: SUPPLY SYMBOL; SymbolName_1: GND-2; GateName_1: GND; LibraryName: qualified_1; DeviceSetName: GND

## Sheet design_3.SchDoc: design
size 414 x 279 mm; Date: 1/25/2021 11:39:22 PM; SheetNumber: 4; Origin: Eagle; GateName_1: G$1; SymbolName_1: A3-L-GUMSTIX; LibraryName: qualified_1; DeviceSetName: A3-L-GUMSTIX; A: A; B: B; C: C; D: D; E: E; F: F; G: G; H: H; 1: 1; 2: 2; 3: 3; 4: 4; 5: 5; Sheet: Sheet:; C:/Gumstix/gumstix-logo-16.bmp: C:/Gumstix/gumstix-logo-16.bmp; Board: Board:
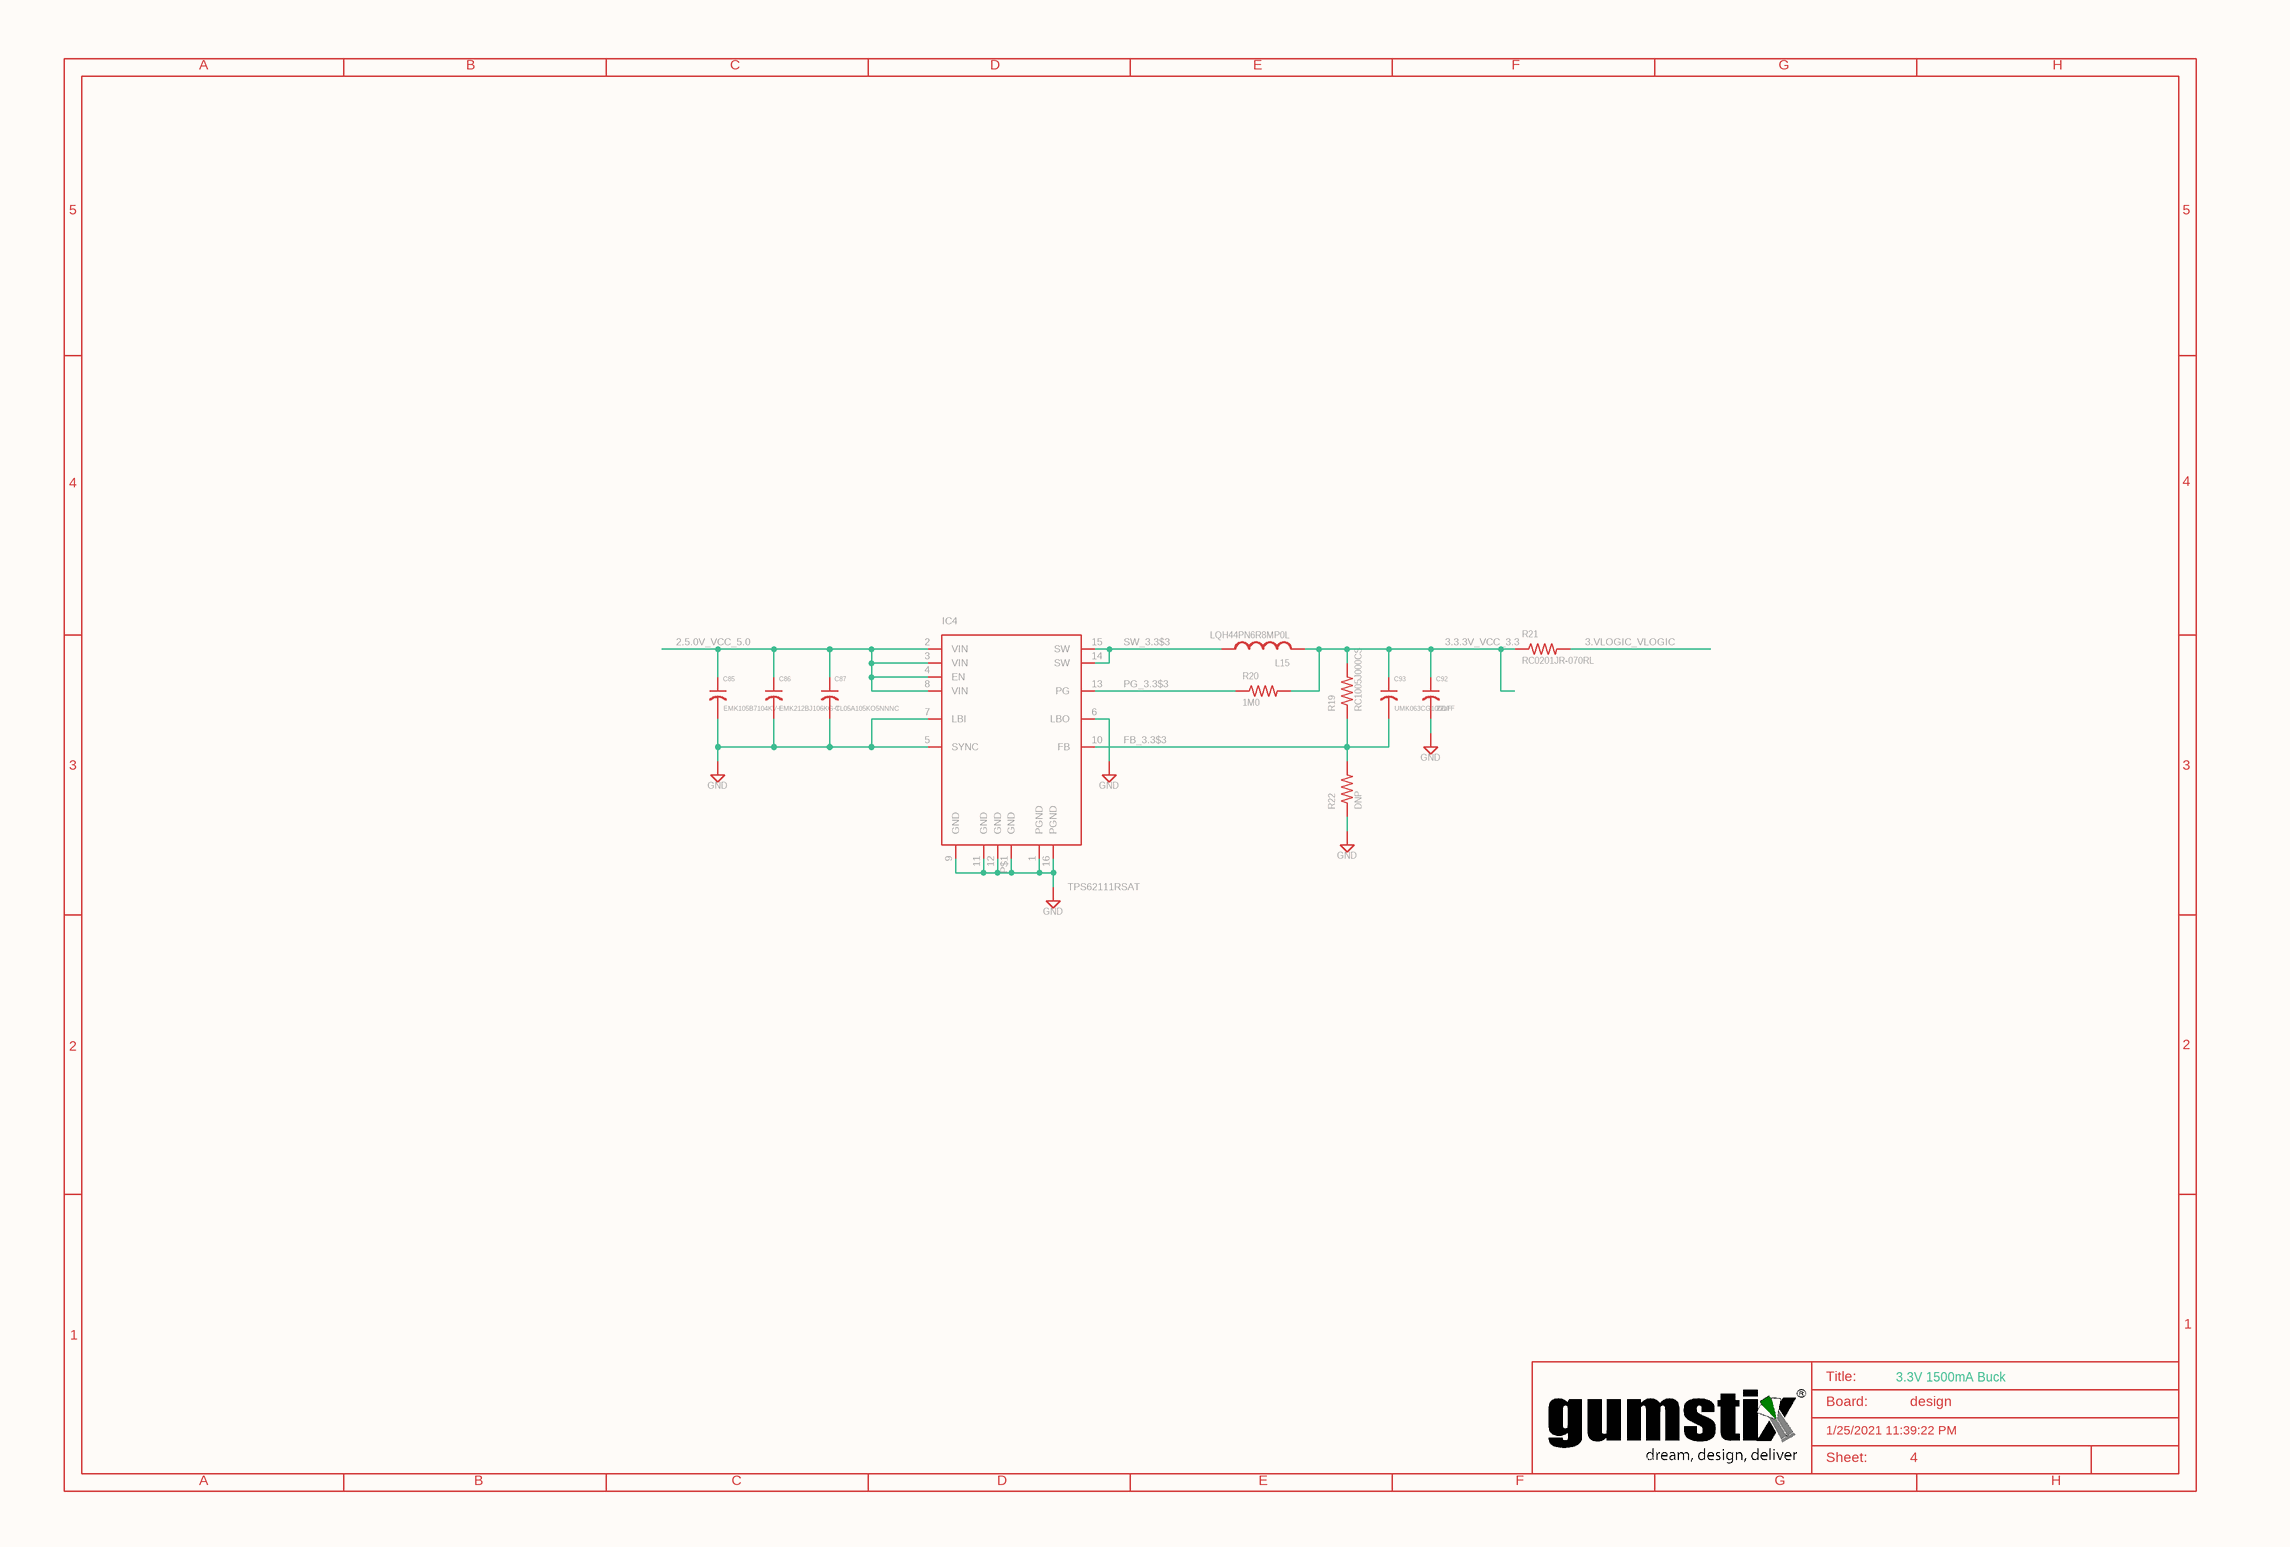
[diagram p9: design_3.SchDoc]

### Parts
C85  EMK105B7104KV-F  [0402]
C86  EMK212BJ106KG-T  [0805]
C87  CL05A105KO5NNNC  [0402]
C92  22uF  [0805]
C93  UMK063CG100DTF  [0201]
IC4  TPS62111RSAT  [PQFP16]
L15  LQH44PN6R8MP0L  [1515]
R19  RC1005J000CS  [0402]
R20  1M0  [0201]
R21  RC0201JR-070RL  [0201]
R22  DNP  [0402]
SUPPLY88  GND
SUPPLY97  GND
SUPPLY98  GND
SUPPLY116  GND
SUPPLY117  GND

### Nets
2.5.0V_VCC_5.0: C85.1 C86.1 C87.1 IC4.2(VIN) IC4.3(VIN) IC4.4(EN) IC4.8(VIN)
3.3.3V_VCC_3.3: C92.1 C93.1 L15.2 R19.2 R20.2 R21.1
3.VLOGIC_VLOGIC: R21.2
FB_3.3$3: C93.2 IC4.10(FB) R19.1 R22.2
PG_3.3$3: IC4.13(PG) R20.1
SW_3.3$3: IC4.14(SW) IC4.15(SW) L15.1
NetC85_2: C85.2 C86.2 C87.2 IC4.5(SYNC) IC4.7(LBI) SUPPLY88.?1(GND)
NetC92_2: C92.2 SUPPLY98.?1(GND)
NetIC4_1: IC4.1(PGND) IC4.9(GND) IC4.11(GND) IC4.12(GND) IC4.16(PGND) IC4.P$1(GND) SUPPLY116.?1(GND)
NetIC4_6: IC4.6(LBO) SUPPLY117.?1(GND)
NetR22_1: R22.1 SUPPLY97.?1(GND)

### Notes on the sheet
- A
- B
- C
- D
- E
- F
- G
- H
- 5
- 4
- 3
- 2
- 1
- Title:
- Board:
- 3.3V 1500mA Buck
- design
- C:/Gumstix/gumstix-logo-16.bmp
- 1/25/2021 11:39:22 PM
- Sheet:

### Library data of the parts
C85 = EMK105B7104KV-F: GateName_1: G$1; SymbolName_1: C-US; LibraryName: qualified_1@eagle_src_repo_825e5973c79738778b249d35b895f4444d985c7a; DeviceSetName: EMK105B7104KV-F; DM: DM; DR: DR; DX: DX; DY: DY; HEIGHT: 0.35; SHEETNO: SHEETNO
C86 = EMK212BJ106KG-T: GateName_1: G$1; SymbolName_1: C-US; LibraryName: qualified_1@eagle_src_repo_825e5973c79738778b249d35b895f4444d985c7a; DeviceSetName: EMK212BJ106KG-T; DM: DM; DR: DR; DX: DX; DY: DY; HEIGHT: 0.51; SHEETNO: SHEETNO
C87 = CL05A105KO5NNNC: GateName_1: G$1; SymbolName_1: C-US; LibraryName: qualified_1@eagle_src_repo_825e5973c79738778b249d35b895f4444d985c7a; DeviceSetName: CL05A105KO5NNNC; HEIGHT: 0.35
C92 = C0805: as C19 on sheet design_16; DeviceName: 0805; LibraryName: qualified_1@eagle_src_repo_825e5973c79738778b249d35b895f4444d985c7a; DM: DM; DR: DR; DX: DX; DY: DY; HEIGHT: 0.51; SHEETNO: SHEETNO
C93 = UMK063CG100DTF: GateName_1: G$1; SymbolName_1: C-US; LibraryName: qualified_1@eagle_src_repo_825e5973c79738778b249d35b895f4444d985c7a; DeviceSetName: UMK063CG100DTF; HEIGHT: 0.25
IC4 = TPS62111RSAT: GateName_1: G$1; SymbolName_1: TPS62111; LibraryName: qualified_1; DeviceSetName: TPS62111RSAT; DM: DM; DR: DR; DX: DX; DY: DY; HEIGHT: 1; SHEETNO: SHEETNO
L15 = LQH44PN6R8MP0L: GateName_1: G$1; SymbolName_1: L-US; LibraryName: qualified_1@eagle_src_repo_825e5973c79738778b249d35b895f4444d985c7a; DeviceSetName: LQH44PN6R8MP0L; HEIGHT: 1.9
R19 = RC1005J000CS: GateName_1: G$1; SymbolName_1: R-US; LibraryName: qualified_1@eagle_src_repo_825e5973c79738778b249d35b895f4444d985c7a; DeviceSetName: RC1005J000CS; DM: DM; DR: DR; DX: DX; DY: DY; HEIGHT: 0.35; SHEETNO: SHEETNO
R20 = R0201: as R48 on sheet design_10; DeviceName: 0201; LibraryName: qualified_1@eagle_src_repo_825e5973c79738778b249d35b895f4444d985c7a; HEIGHT: 0.25
R21 = RC0201JR-070RL: GateName_1: G$1; SymbolName_1: R-US; LibraryName: qualified_1@eagle_src_repo_825e5973c79738778b249d35b895f4444d985c7a; DeviceSetName: RC0201JR-070RL; HEIGHT: 0.25
R22 = R0402: GateName_1: G$1; SymbolName_1: R-US; DeviceSetName: R; DeviceName: 0402; LibraryName: qualified_1@eagle_src_repo_825e5973c79738778b249d35b895f4444d985c7a; DM: DM; DR: DR; DX: DX; DY: DY; HEIGHT: 0.35; SHEETNO: SHEETNO
SUPPLY88 SUPPLY97 SUPPLY98 SUPPLY116 SUPPLY117 = GND: SUPPLY SYMBOL; SymbolName_1: GND-2; GateName_1: GND; LibraryName: qualified_1; DeviceSetName: GND

## Sheet design_4.SchDoc: design
size 414 x 279 mm; Date: 1/25/2021 11:39:22 PM; SheetNumber: 5; Origin: Eagle; GateName_1: G$1; SymbolName_1: A3-L-GUMSTIX; LibraryName: qualified_1; DeviceSetName: A3-L-GUMSTIX; A: A; B: B; C: C; D: D; E: E; F: F; G: G; H: H; 1: 1; 2: 2; 3: 3; 4: 4; 5: 5; Sheet: Sheet:; C:/Gumstix/gumstix-logo-16.bmp: C:/Gumstix/gumstix-logo-16.bmp; Board: Board:
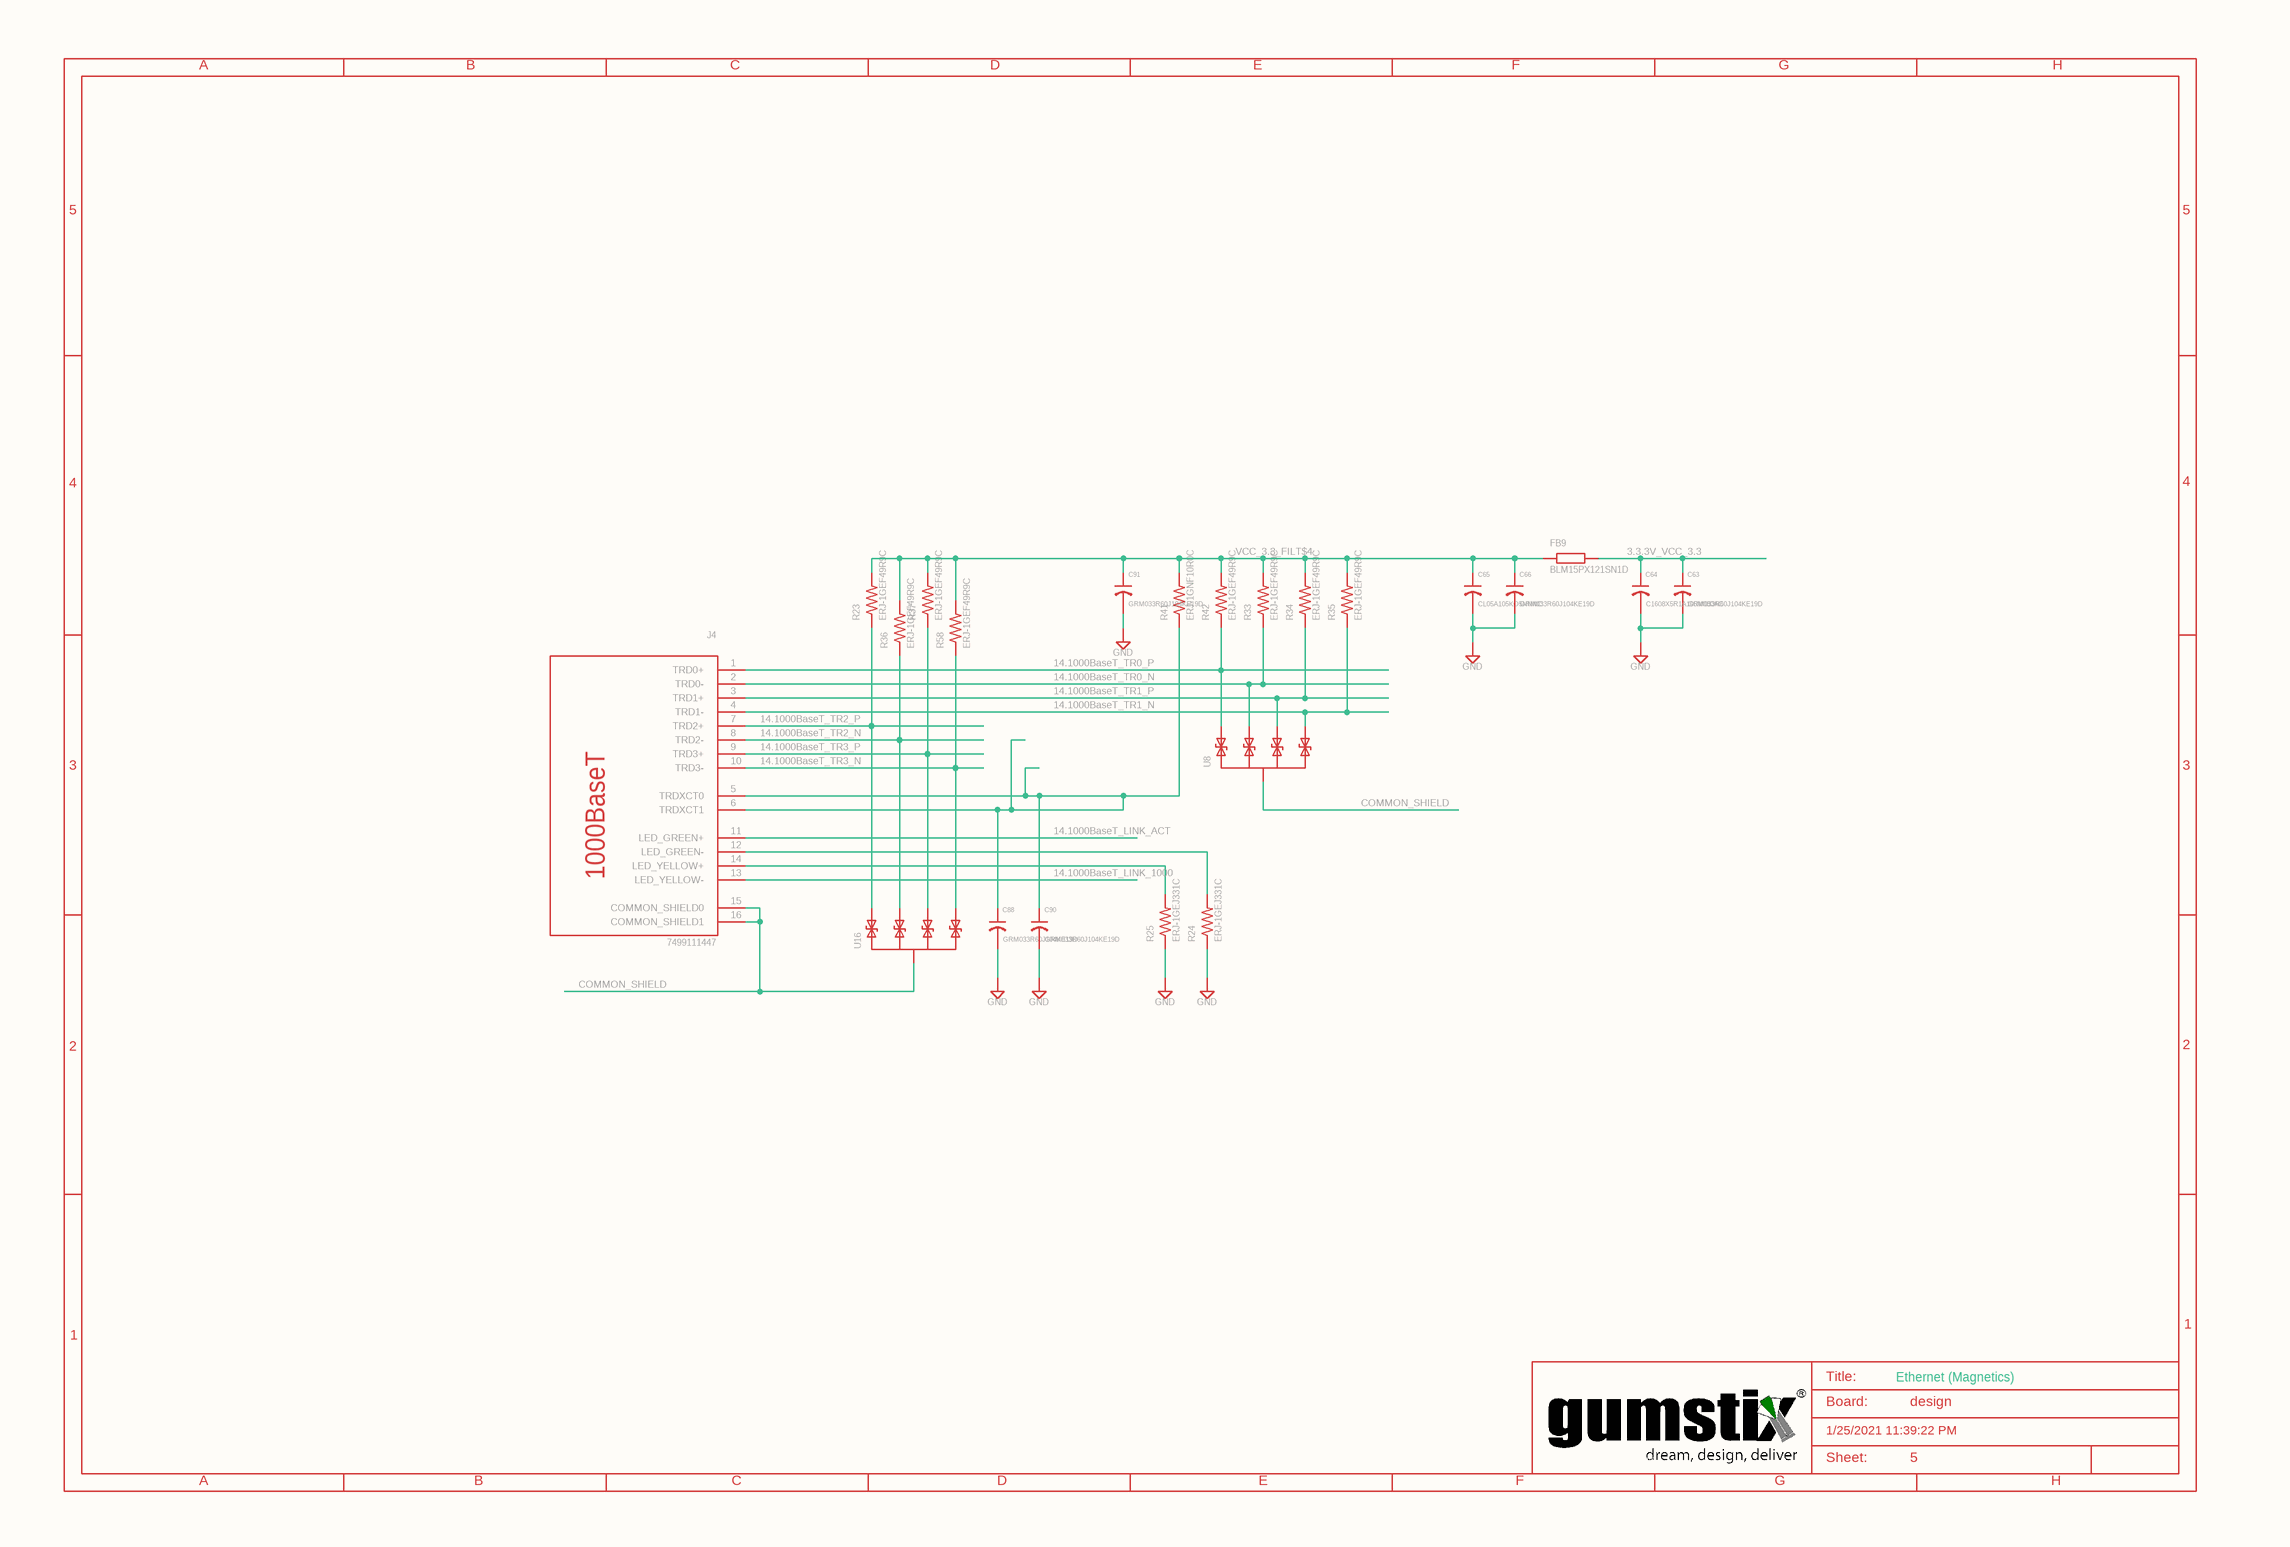
[diagram p10: design_4.SchDoc]

### Parts
C63  GRM033R60J104KE19D  [0201]
C64  C1608X5R1A106M080AC  [0603]
C65  CL05A105KO5NNNC  [0402]
C66  GRM033R60J104KE19D  [0201]
C88  GRM033R60J104KE19D  [0201]
C90  GRM033R60J104KE19D  [0201]
C91  GRM033R60J104KE19D  [0201]
FB9  BLM15PX121SN1D  [0402]
J4  7499111447  [7499111447]
R23  ERJ-1GEF49R9C  [0201]
R24  ERJ-1GEJ331C  [0201]
R25  ERJ-1GEJ331C  [0201]
R33  ERJ-1GEF49R9C  [0201]
R34  ERJ-1GEF49R9C  [0201]
R35  ERJ-1GEF49R9C  [0201]
R36  ERJ-1GEF49R9C  [0201]
R37  ERJ-1GEF49R9C  [0201]
R41  ERJ-1GNF10R0C  [0201]
R42  ERJ-1GEF49R9C  [0201]
R58  ERJ-1GEF49R9C  [0201]
SUPPLY92  GND
SUPPLY93  GND
SUPPLY94  GND
SUPPLY100  GND
SUPPLY101  GND
SUPPLY102  GND
SUPPLY107  GND
U8  TPD4E02B04DQAR  [UFDFN-10]  (value not drawn)
U16  TPD4E02B04DQAR  [UFDFN-10]  (value not drawn)

### Nets
3.3.3V_VCC_3.3: C63.1 C64.1 FB9.2
14.1000BaseT_LINK_1000: J4.13(LED_YELLOW-)
14.1000BaseT_LINK_ACT: J4.11(LED_GREEN+)
14.1000BaseT_TR0_N: J4.2(TRD0-) R33.1 U8.2_9(P2)
14.1000BaseT_TR0_P: J4.1(TRD0+) R42.1 U8.1_10(P1)
14.1000BaseT_TR1_N: J4.4(TRD1-) R35.1 U8.5_6(P4)
14.1000BaseT_TR1_P: J4.3(TRD1+) R34.1 U8.4_7(P3)
14.1000BaseT_TR2_N: J4.8(TRD2-) R36.1 U16.2_9(P2)
14.1000BaseT_TR2_P: J4.7(TRD2+) R23.1 U16.1_10(P1)
14.1000BaseT_TR3_N: J4.10(TRD3-) R58.1 U16.5_6(P4)
14.1000BaseT_TR3_P: J4.9(TRD3+) R37.1 U16.4_7(P3)
COMMON_SHIELD: J4.15(COMMON_SHIELD0) J4.16(COMMON_SHIELD1) U8.3_8(SHIELD) U16.3_8(SHIELD)
VCC_3.3_FILT$4: C65.1 C66.1 C91.1 FB9.1 R23.2 R33.2 R34.2 R35.2 R36.2 R37.2 R41.2 R42.2 R58.2
NetC63_2: C63.2 C64.2 SUPPLY93.?1(GND)
NetC65_2: C65.2 C66.2 SUPPLY92.?1(GND)
NetC88_1: C88.1 C90.1 J4.5(TRDXCT0) J4.6(TRDXCT1) R41.1
NetC88_2: C88.2 SUPPLY94.?1(GND)
NetC90_2: C90.2 SUPPLY100.?1(GND)
NetC91_2: C91.2 SUPPLY102.?1(GND)
NetJ4_12: J4.12(LED_GREEN-) R24.2
NetJ4_14: J4.14(LED_YELLOW+) R25.2
NetR24_1: R24.1 SUPPLY101.?1(GND)
NetR25_1: R25.1 SUPPLY107.?1(GND)

### Notes on the sheet
- A
- B
- C
- D
- E
- F
- G
- H
- 5
- 4
- 3
- 2
- 1
- Title:
- Board:
- Ethernet (Magnetics)
- design
- C:/Gumstix/gumstix-logo-16.bmp
- 1/25/2021 11:39:22 PM
- Sheet:

### Library data of the parts
C63 C66 C88 C90 C91 = GRM033R60J104KE19D: GateName_1: G$1; SymbolName_1: C-US; LibraryName: qualified_1@eagle_src_repo_635c6cefb04d901352cb5cab0982b753f09e9156; DeviceSetName: GRM033R60J104KE19D; HEIGHT: 0.25
C64 = C1608X5R1A106M080AC: GateName_1: G$1; SymbolName_1: C-US; LibraryName: qualified_1@eagle_src_repo_635c6cefb04d901352cb5cab0982b753f09e9156; DeviceSetName: C1608X5R1A106M080AC; HEIGHT: 0.5
C65 = CL05A105KO5NNNC: GateName_1: G$1; SymbolName_1: C-US; LibraryName: qualified_1@eagle_src_repo_635c6cefb04d901352cb5cab0982b753f09e9156; DeviceSetName: CL05A105KO5NNNC; HEIGHT: 0.35
FB9 = BLM15PX121SN1D: GateName_1: G$1; SymbolName_1: FB; LibraryName: qualified_1@eagle_src_repo_635c6cefb04d901352cb5cab0982b753f09e9156; DeviceSetName: BLM15PX121SN1D; HEIGHT: 0.35
J4 = 7499111447: 1000BASE-T Ethernet Jack; GateName_1: G$1; SymbolName_1: 1000BASET; LibraryName: qualified_1; DeviceSetName: 7499111447; 1000BaseT: 1000BaseT
R23 R33-R37 R42 R58 = ERJ-1GEF49R9C: GateName_1: G$1; SymbolName_1: R-US; LibraryName: qualified_1@eagle_src_repo_635c6cefb04d901352cb5cab0982b753f09e9156; DeviceSetName: ERJ-1GEF49R9C; HEIGHT: 0.25
R24 R25 = ERJ-1GEJ331C: GateName_1: G$1; SymbolName_1: R-US; LibraryName: qualified_1@eagle_src_repo_635c6cefb04d901352cb5cab0982b753f09e9156; DeviceSetName: ERJ-1GEJ331C; HEIGHT: 0.25
R41 = ERJ-1GNF10R0C: GateName_1: G$1; SymbolName_1: R-US; LibraryName: qualified_1@eagle_src_repo_635c6cefb04d901352cb5cab0982b753f09e9156; DeviceSetName: ERJ-1GNF10R0C; HEIGHT: 0.25
SUPPLY92 SUPPLY93 = GND: SUPPLY SYMBOL; GateName_1: GND; SymbolName_1: GND; LibraryName: supply2; DeviceSetName: GND
SUPPLY94 SUPPLY100-SUPPLY102 SUPPLY107 = GND: SUPPLY SYMBOL; SymbolName_1: GND-2; GateName_1: GND; LibraryName: qualified_1; DeviceSetName: GND
U8 U16 = TPD4E02B04DQAR: as U2 on sheet design_17; LibraryName: qualified_1; DeviceSetName: TPD4E02B04DQAR

## Sheet design_6.SchDoc: design
size 414 x 279 mm; Date: 1/25/2021 11:39:22 PM; SheetNumber: 7; Origin: Eagle; GateName_1: G$1; SymbolName_1: A3-L-GUMSTIX; LibraryName: qualified_1; DeviceSetName: A3-L-GUMSTIX; A: A; B: B; C: C; D: D; E: E; F: F; G: G; H: H; 1: 1; 2: 2; 3: 3; 4: 4; 5: 5; Sheet: Sheet:; C:/Gumstix/gumstix-logo-16.bmp: C:/Gumstix/gumstix-logo-16.bmp; Board: Board:
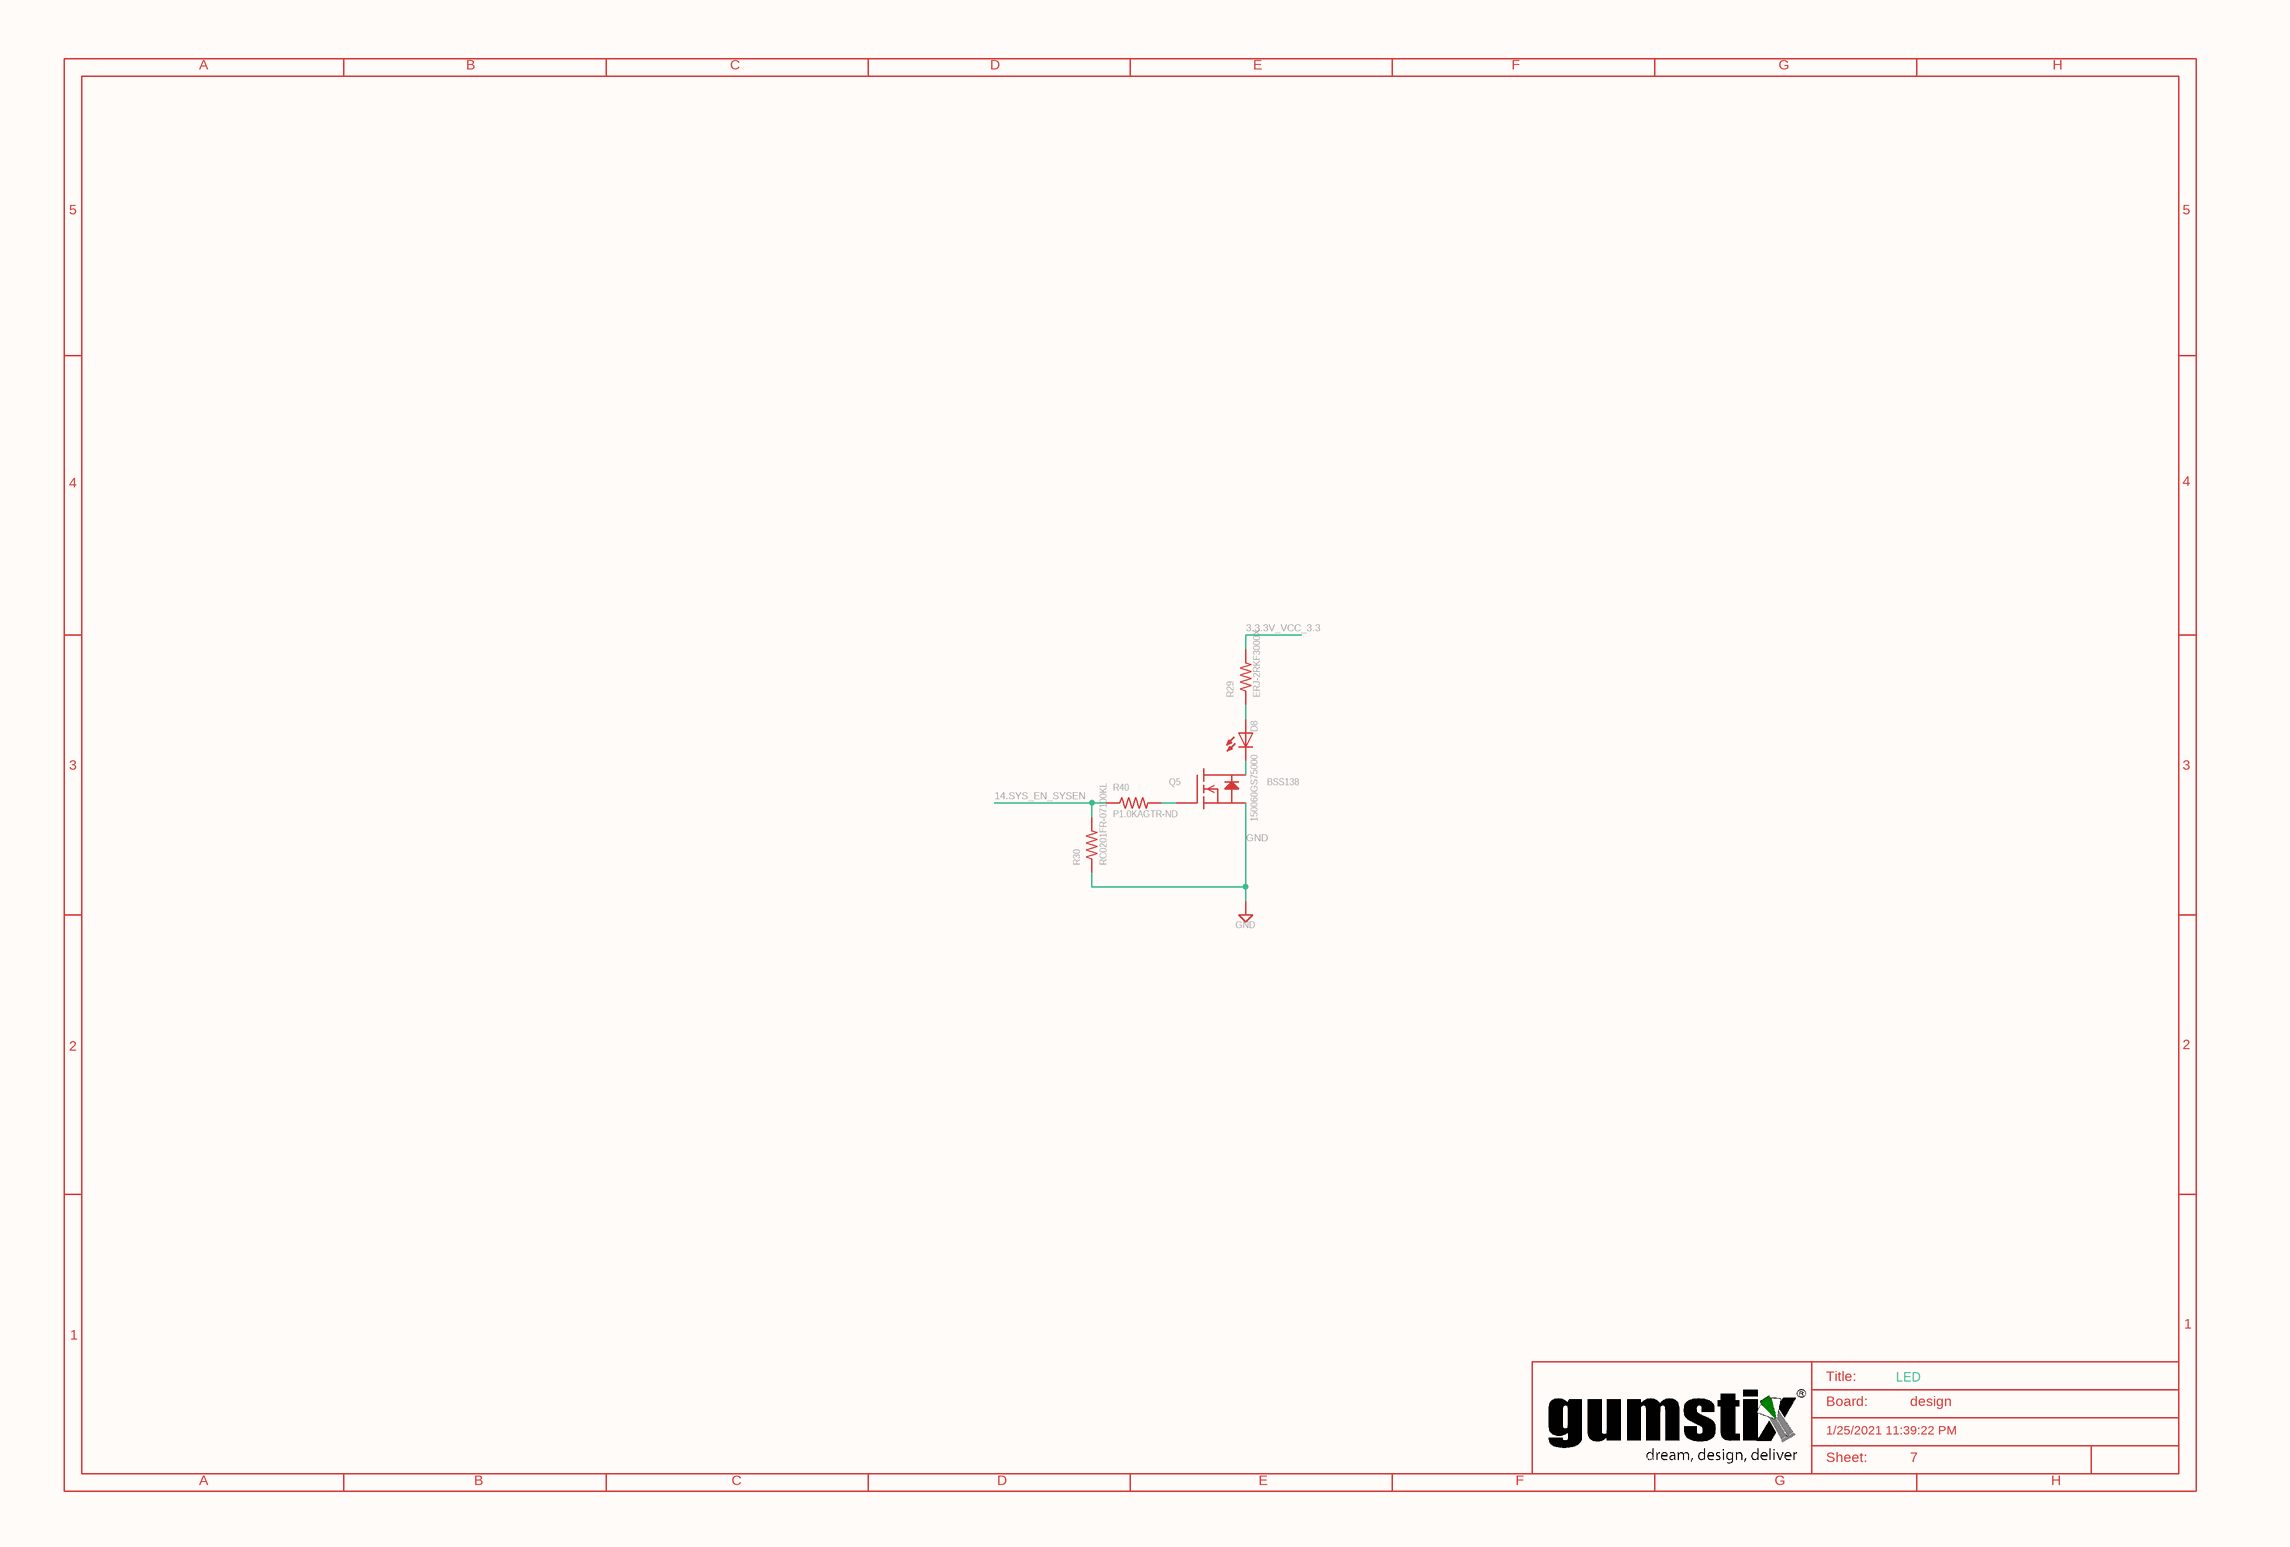
[diagram p11: design_6.SchDoc]

### Parts
D8  150060GS75000  [D0603]
Q5  BSS138  [SOT23]
R29  ERJ-2RKF3000X  [0402]
R30  RC0201FR-07100KL  [0201]
R40  P1.0KAGTR-ND  [0201]
SUPPLY96  GND

### Nets
3.3.3V_VCC_3.3: R29.2
14.SYS_EN_SYSEN: R30.2 R40.1
GND: Q5.2(S) R30.1 SUPPLY96.?1(GND)
NetD8_A: D8.A R29.1
NetD8_C: D8.C Q5.3(D)
NetQ5_1: Q5.1(G) R40.2

### Notes on the sheet
- A
- B
- C
- D
- E
- F
- G
- H
- 5
- 4
- 3
- 2
- 1
- Title:
- Board:
- LED
- design
- C:/Gumstix/gumstix-logo-16.bmp
- 1/25/2021 11:39:22 PM
- Sheet:
- 7

### Library data of the parts
D8 = 150060GS75000: GateName_1: G$1; SymbolName_1: LED; LibraryName: qualified_1; DeviceSetName: 150060GS75000; HEIGHT: 0.5
Q5 = BSS138: as Q1 on sheet design_10; LibraryName: qualified_1; DeviceSetName: BSS138; HEIGHT: 1.12
R29 = ERJ-2RKF3000X: GateName_1: G$1; SymbolName_1: R-US; LibraryName: qualified_1; DeviceSetName: ERJ-2RKF3000X; HEIGHT: 0.35
R30 = RC0201FR-07100KL: GateName_1: G$1; SymbolName_1: R-US; LibraryName: qualified_1; DeviceSetName: RC0201FR-07100KL; HEIGHT: 0.25
R40 = P1.0KAGTR-ND: GateName_1: G$1; SymbolName_1: R-US; LibraryName: qualified_1; DeviceSetName: P1.0KAGTR-ND; HEIGHT: 0.25
SUPPLY96 = GND: SUPPLY SYMBOL; SymbolName_1: GND-2; GateName_1: GND; LibraryName: qualified_1; DeviceSetName: GND

## Sheet design_7.SchDoc: design
size 414 x 279 mm; Date: 1/25/2021 11:39:22 PM; SheetNumber: 8; Origin: Eagle; GateName_1: G$1; SymbolName_1: A3-L-GUMSTIX; LibraryName: qualified_1; DeviceSetName: A3-L-GUMSTIX; A: A; B: B; C: C; D: D; E: E; F: F; G: G; H: H; 1: 1; 2: 2; 3: 3; 4: 4; 5: 5; Sheet: Sheet:; C:/Gumstix/gumstix-logo-16.bmp: C:/Gumstix/gumstix-logo-16.bmp; Board: Board:
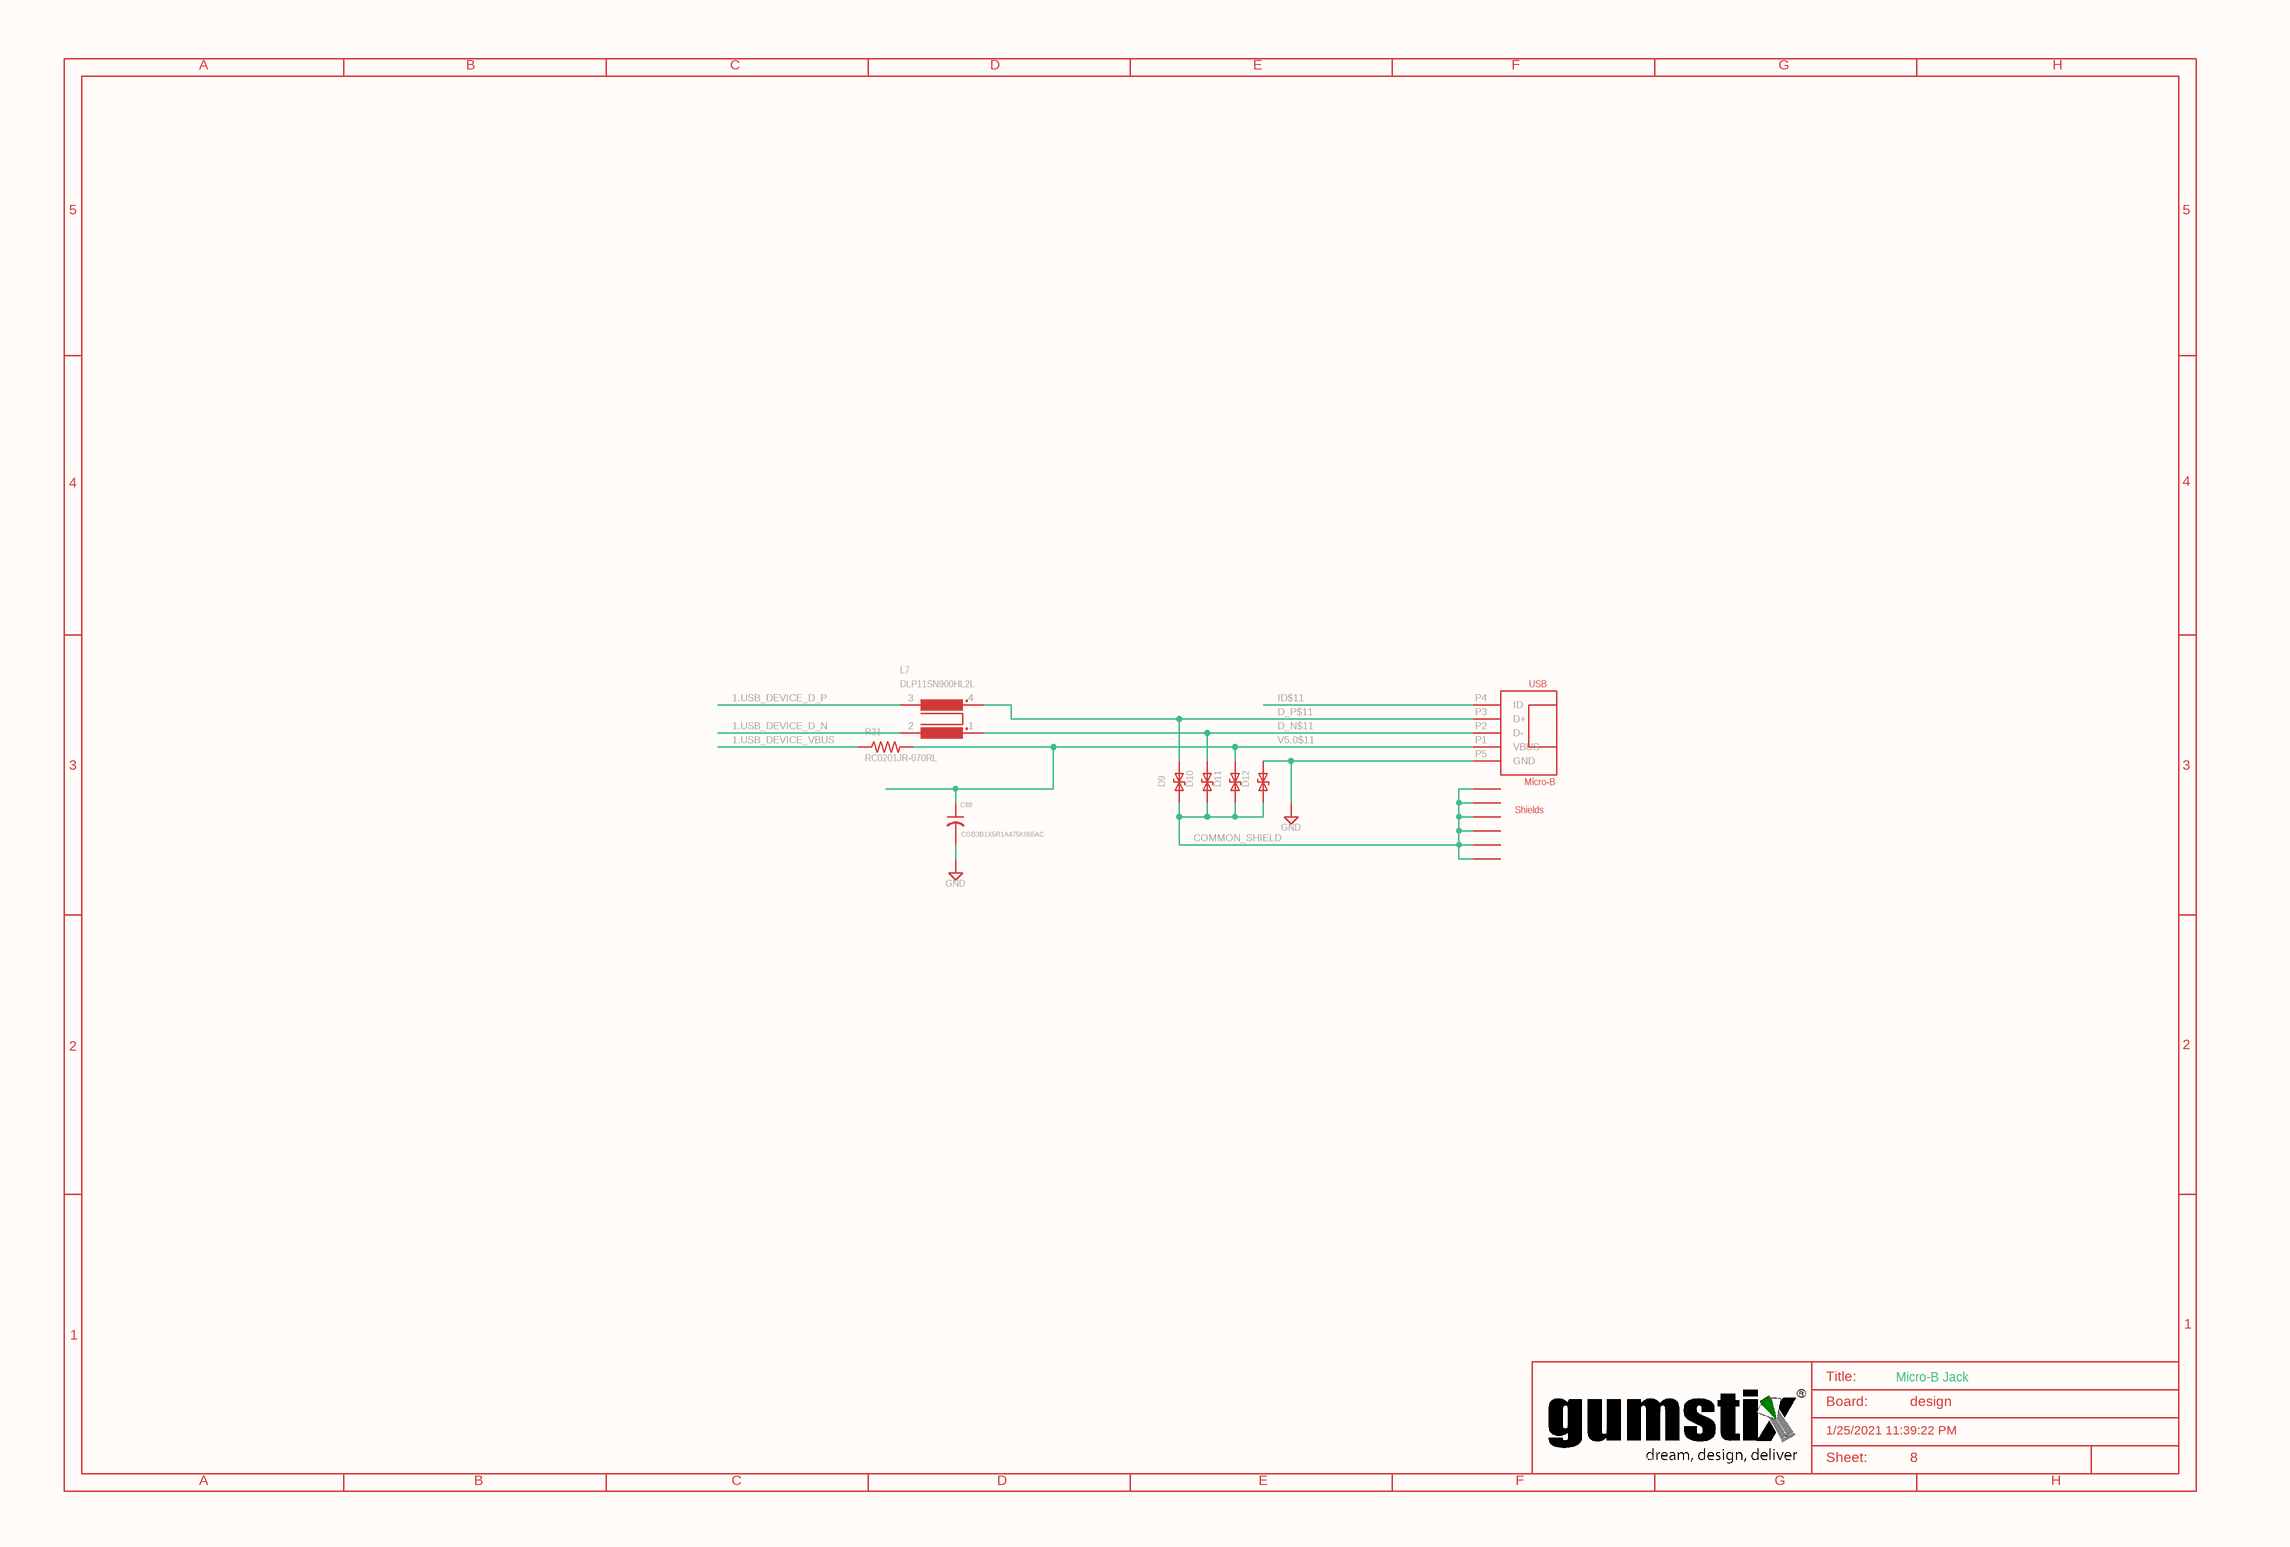
[diagram p12: design_7.SchDoc]

### Parts
C89  CGB3B1X5R1A475K055AC  [0603]
D9  PS04LTVA1  [D0402]  (value not drawn)
D10  PS04LTVA1  [D0402]  (value not drawn)
D11  B72590D0050A060  [D0402]  (value not drawn)
D12  B72590D0050A060  [D0402]  (value not drawn)
J3  10118192-0001LF  [USB_MICRO_B]  (value not drawn)
L7  DLP11SN900HL2L  [0504-DLP11S]
R31  RC0201JR-070RL  [0201]
SUPPLY69  GND
SUPPLY135  GND

### Nets
1.USB_DEVICE_D_N: L7.2
1.USB_DEVICE_D_P: L7.3
1.USB_DEVICE_VBUS: R31.1
COMMON_SHIELD: D9.P1 D10.P1 D11.P1 D12.P1 J3.COMMON_SHEILD1(COMMON_SHIELD1) J3.COMMON_SHEILD2(COMMON_SHIELD2) J3.COMMON_SHEILD3(COMMON_SHIELD3) J3.COMMON_SHEILD4(COMMON_SHIELD4) J3.COMMON_SHEILD5(COMMON_SHIELD5) J3.COMMON_SHEILD6(COMMON_SHIELD6)
D_N$11: D10.P2 J3.P2(D-) L7.1
D_P$11: D9.P2 J3.P3(D+) L7.4
ID$11: J3.P4(ID)
V5.0$11: C89.1 D11.P2 J3.P1(VBUS) R31.2
NetC89_2: C89.2 SUPPLY135.?1(GND)
NetD12_P2: D12.P2 J3.P5(GND) SUPPLY69.?1(GND)

### Notes on the sheet
- A
- B
- C
- D
- E
- F
- G
- H
- 5
- 4
- 3
- 2
- 1
- Title:
- Board:
- Micro-B Jack
- design
- C:/Gumstix/gumstix-logo-16.bmp
- 1/25/2021 11:39:22 PM
- Sheet:
- 8

### Library data of the parts
C89 = CGB3B1X5R1A475K055AC: GateName_1: G$1; SymbolName_1: C-US; LibraryName: qualified_1; DeviceSetName: CGB3B1X5R1A475K055AC; HEIGHT: 0.5
D9 D10 = PS04LTVA1: GateName_1: G$1; SymbolName_1: ESD-DIODE; LibraryName: qualified_1; DeviceSetName: PS04LTVA1; HEIGHT: 0.35
D11 D12 = B72590D0050A060: GateName_1: G$1; SymbolName_1: ESD-DIODE; LibraryName: qualified_1; DeviceSetName: B72590D0050A060; HEIGHT: 0.35
J3 = 10118192-0001LF: GateName_1: G$1; SymbolName_1: USB_MICRO_B; LibraryName: qualified_1; DeviceSetName: 10118192-0001LF; Shields: Shields; Micro-B: Micro-B; USB: USB
L7 = DLP11SN900HL2L: as L4 on sheet design_17; LibraryName: qualified_1; DeviceSetName: DLP11SN900HL2L; HEIGHT: 0.83
R31 = RC0201JR-070RL: GateName_1: G$1; SymbolName_1: R-US; LibraryName: qualified_1; DeviceSetName: RC0201JR-070RL; HEIGHT: 0.25
SUPPLY69 = GND: SUPPLY SYMBOL; GateName_1: GND; SymbolName_1: GND; LibraryName: supply2; DeviceSetName: GND
SUPPLY135 = GND: SUPPLY SYMBOL; SymbolName_1: GND-2; GateName_1: GND; LibraryName: qualified_1; DeviceSetName: GND

## Sheet design_9.SchDoc: design
size 414 x 279 mm; Date: 1/25/2021 11:39:22 PM; SheetNumber: 10; Origin: Eagle; GateName_1: G$1; SymbolName_1: A3-L-GUMSTIX; LibraryName: qualified_1; DeviceSetName: A3-L-GUMSTIX; A: A; B: B; C: C; D: D; E: E; F: F; G: G; H: H; 1: 1; 2: 2; 3: 3; 4: 4; 5: 5; Sheet: Sheet:; C:/Gumstix/gumstix-logo-16.bmp: C:/Gumstix/gumstix-logo-16.bmp; Board: Board:
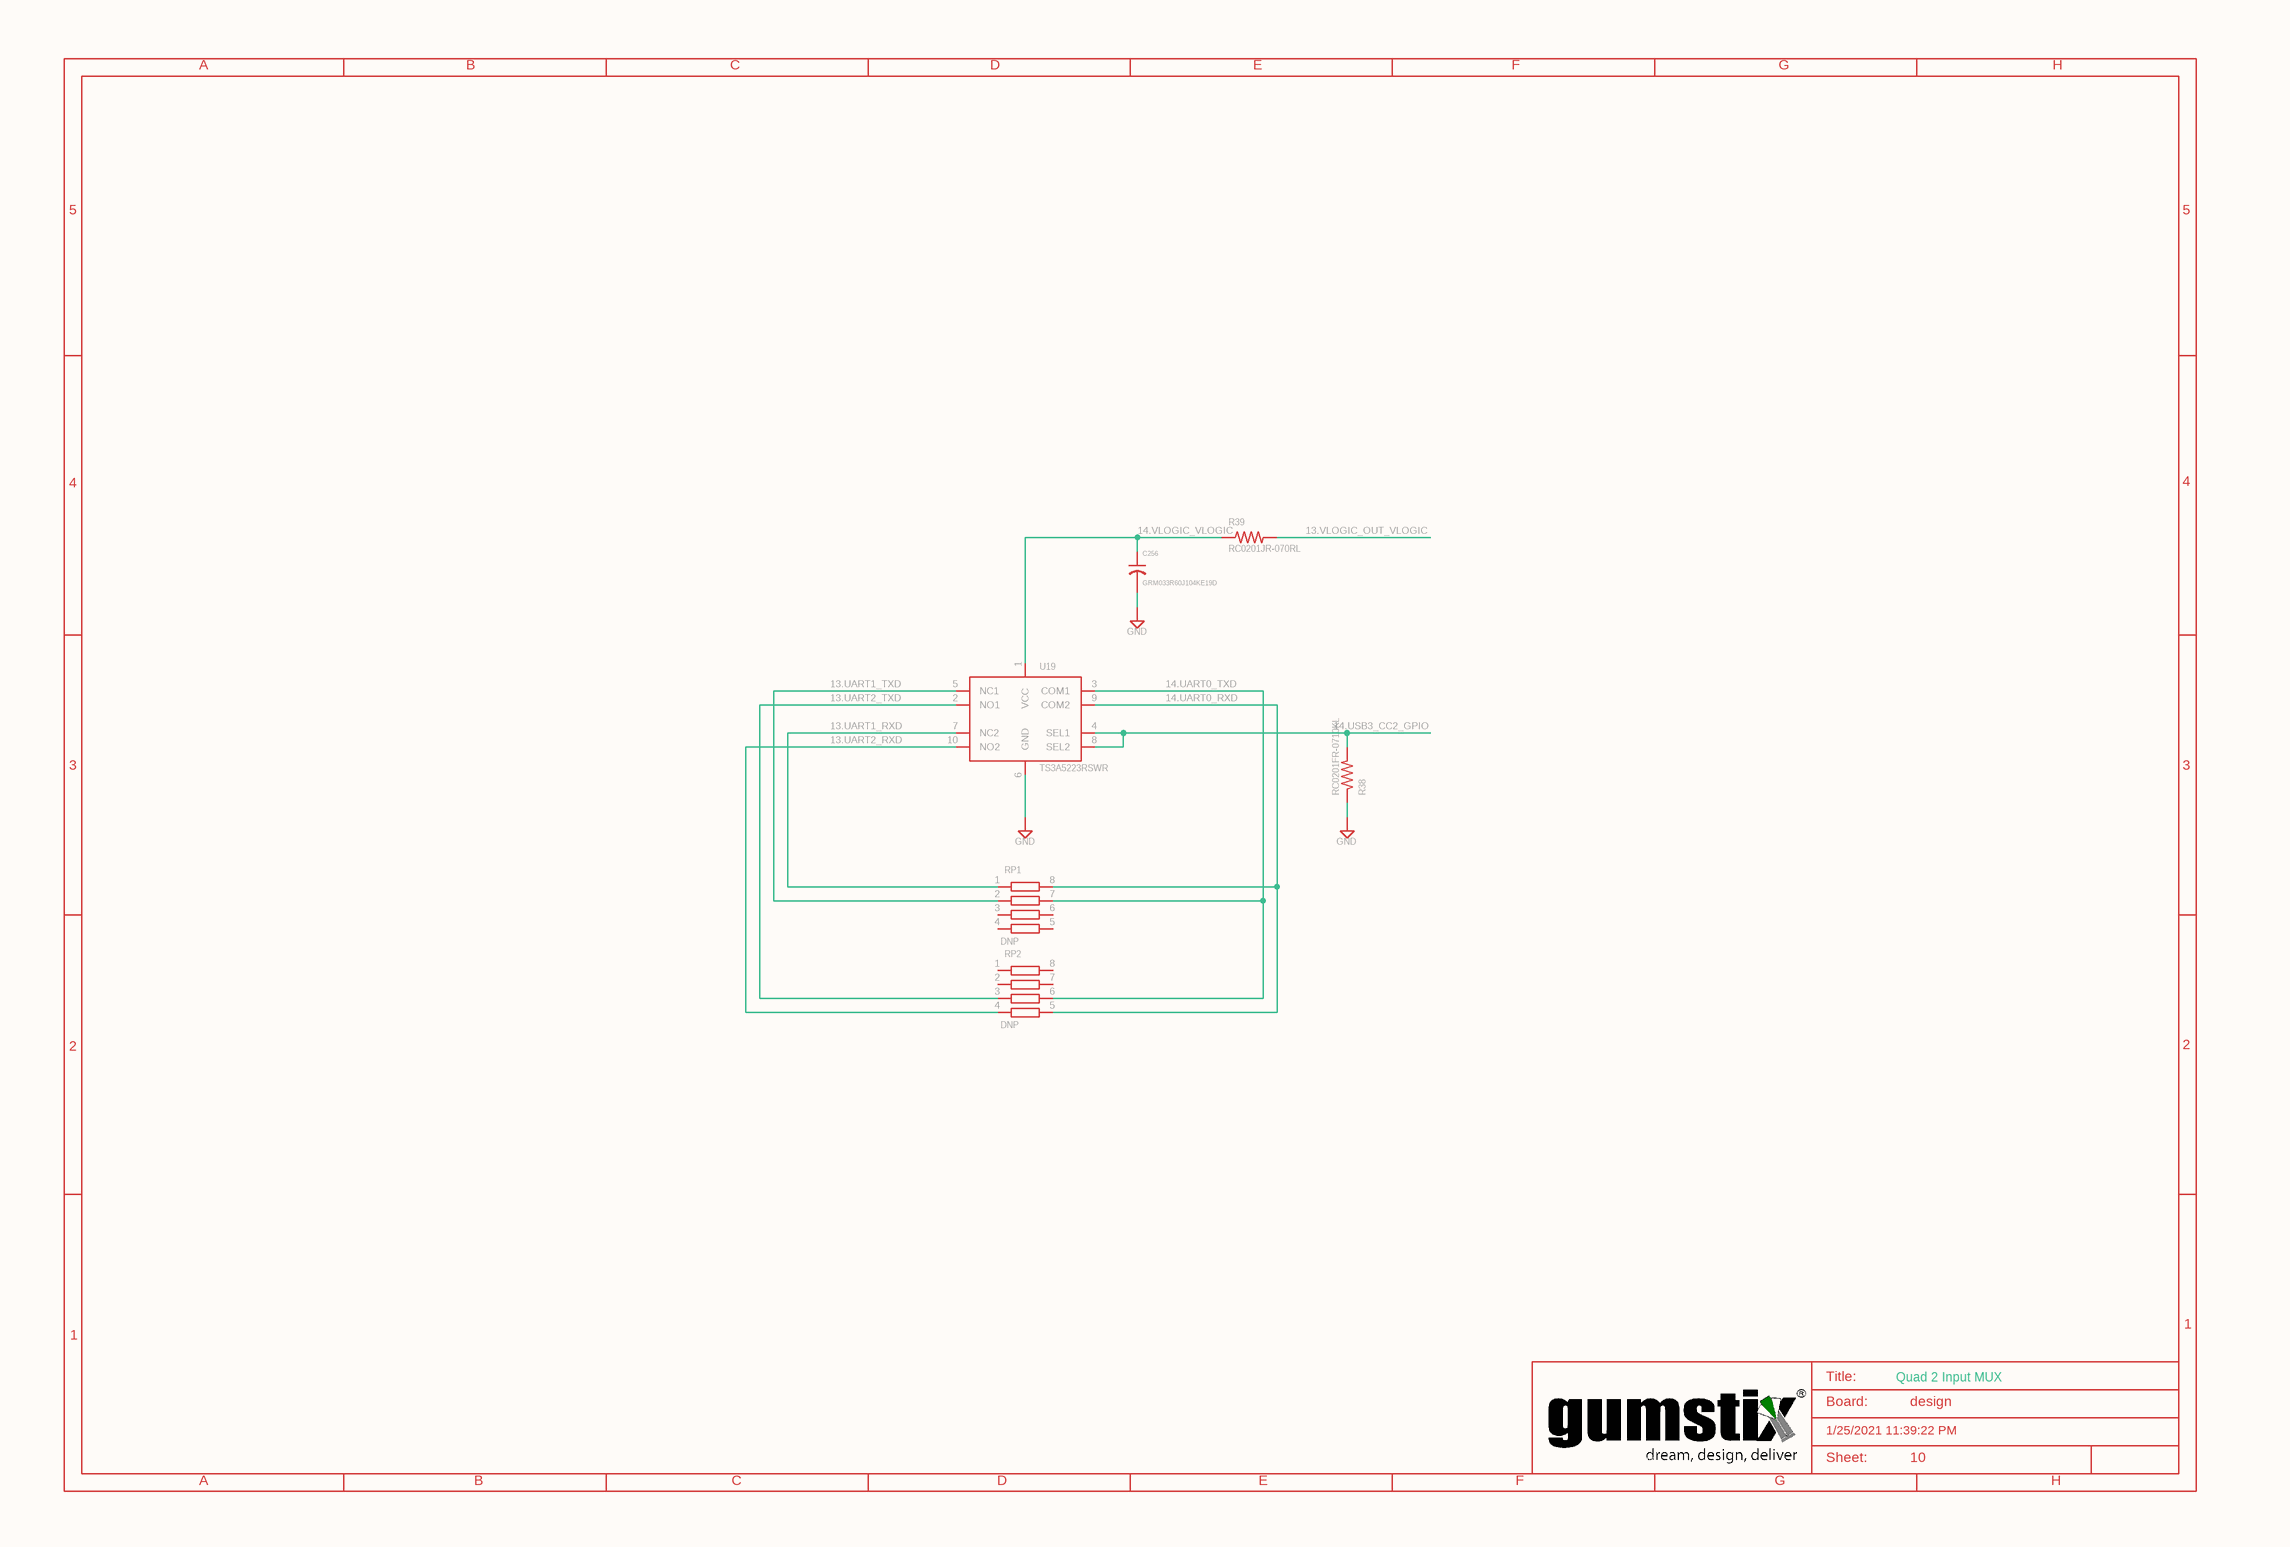
[diagram p13: design_9.SchDoc]

### Parts
C256  GRM033R60J104KE19D  [0201]
R38  RC0201FR-0710KL  [0201]
R39  RC0201JR-070RL  [0201]
RP1  DNP  [RP741X083]
RP2  DNP  [RP741X083]
SUPPLY108  GND
SUPPLY109  GND
SUPPLY110  GND
U19  TS3A5223RSWR  [UQFN-10]

### Nets
13.UART1_RXD: RP1.1 U19.7(NC2)
13.UART1_TXD: RP1.2 U19.5(NC1)
13.UART2_RXD: RP2.4 U19.10(NO2)
13.UART2_TXD: RP2.3 U19.2(NO1)
13.VLOGIC_OUT_VLOGIC: R39.2
14.UART0_RXD: RP1.8 RP2.5 U19.9(COM2)
14.UART0_TXD: RP1.7 RP2.6 U19.3(COM1)
14.USB3_CC2_GPIO: R38.2 U19.4(SEL1) U19.8(SEL2)
14.VLOGIC_VLOGIC: C256.1 R39.1 U19.1(VCC)
NetC256_2: C256.2 SUPPLY109.?1(GND)
NetR38_1: R38.1 SUPPLY110.?1(GND)
NetSUPPLY108_?1: SUPPLY108.?1(GND) U19.6(GND)

Not connected (* = marked no-connect by the designer): RP1 3 4 5 6; RP2 1 2 7 8

### Notes on the sheet
- A
- B
- C
- D
- E
- F
- G
- H
- 5
- 4
- 3
- 2
- 1
- Title:
- Board:
- Quad 2 Input MUX
- design
- C:/Gumstix/gumstix-logo-16.bmp
- 1/25/2021 11:39:22 PM
- Sheet:
- 10

### Library data of the parts
C256 = GRM033R60J104KE19D: GateName_1: G$1; SymbolName_1: C-US; LibraryName: qualified_1@eagle_src_repo_83354d0c2c11c8ce792d5cc032a7091e5ff73f00; DeviceSetName: GRM033R60J104KE19D; HEIGHT: 0.25
R38 = RC0201FR-0710KL: GateName_1: G$1; SymbolName_1: R-US; LibraryName: qualified_1@eagle_src_repo_83354d0c2c11c8ce792d5cc032a7091e5ff73f00; DeviceSetName: RC0201FR-0710KL; HEIGHT: 0.25
R39 = RC0201JR-070RL: GateName_1: G$1; SymbolName_1: R-US; LibraryName: qualified_1@eagle_src_repo_83354d0c2c11c8ce792d5cc032a7091e5ff73f00; DeviceSetName: RC0201JR-070RL; HEIGHT: 0.25
RP1 RP2 = RP741X083: GateName_1: G$1; SymbolName_1: RX04; LibraryName: qualified_1; DeviceSetName: RP741X083
SUPPLY108-SUPPLY110 = GND: SUPPLY SYMBOL; SymbolName_1: GND-2; GateName_1: GND; LibraryName: qualified_1; DeviceSetName: GND
U19 = TS3A5223RSWR: TS3A5223 0.45â„¦ Dual SPDT Bidirectional Analog Switch Package: UQFN-10  Source: http://www.ti.com/lit/ds/symlink/ts3a5223.pdf; GateName_1: G1; SymbolName_1: TS3A5223; LibraryName: qualified_1; DeviceSetName: TS3A5223RSWR